# EAGLE schematic HFT-Core-Module_1V0 (EAGLE 7.7.0), part 1 of 2

## Sheet 1 of 24: MCU
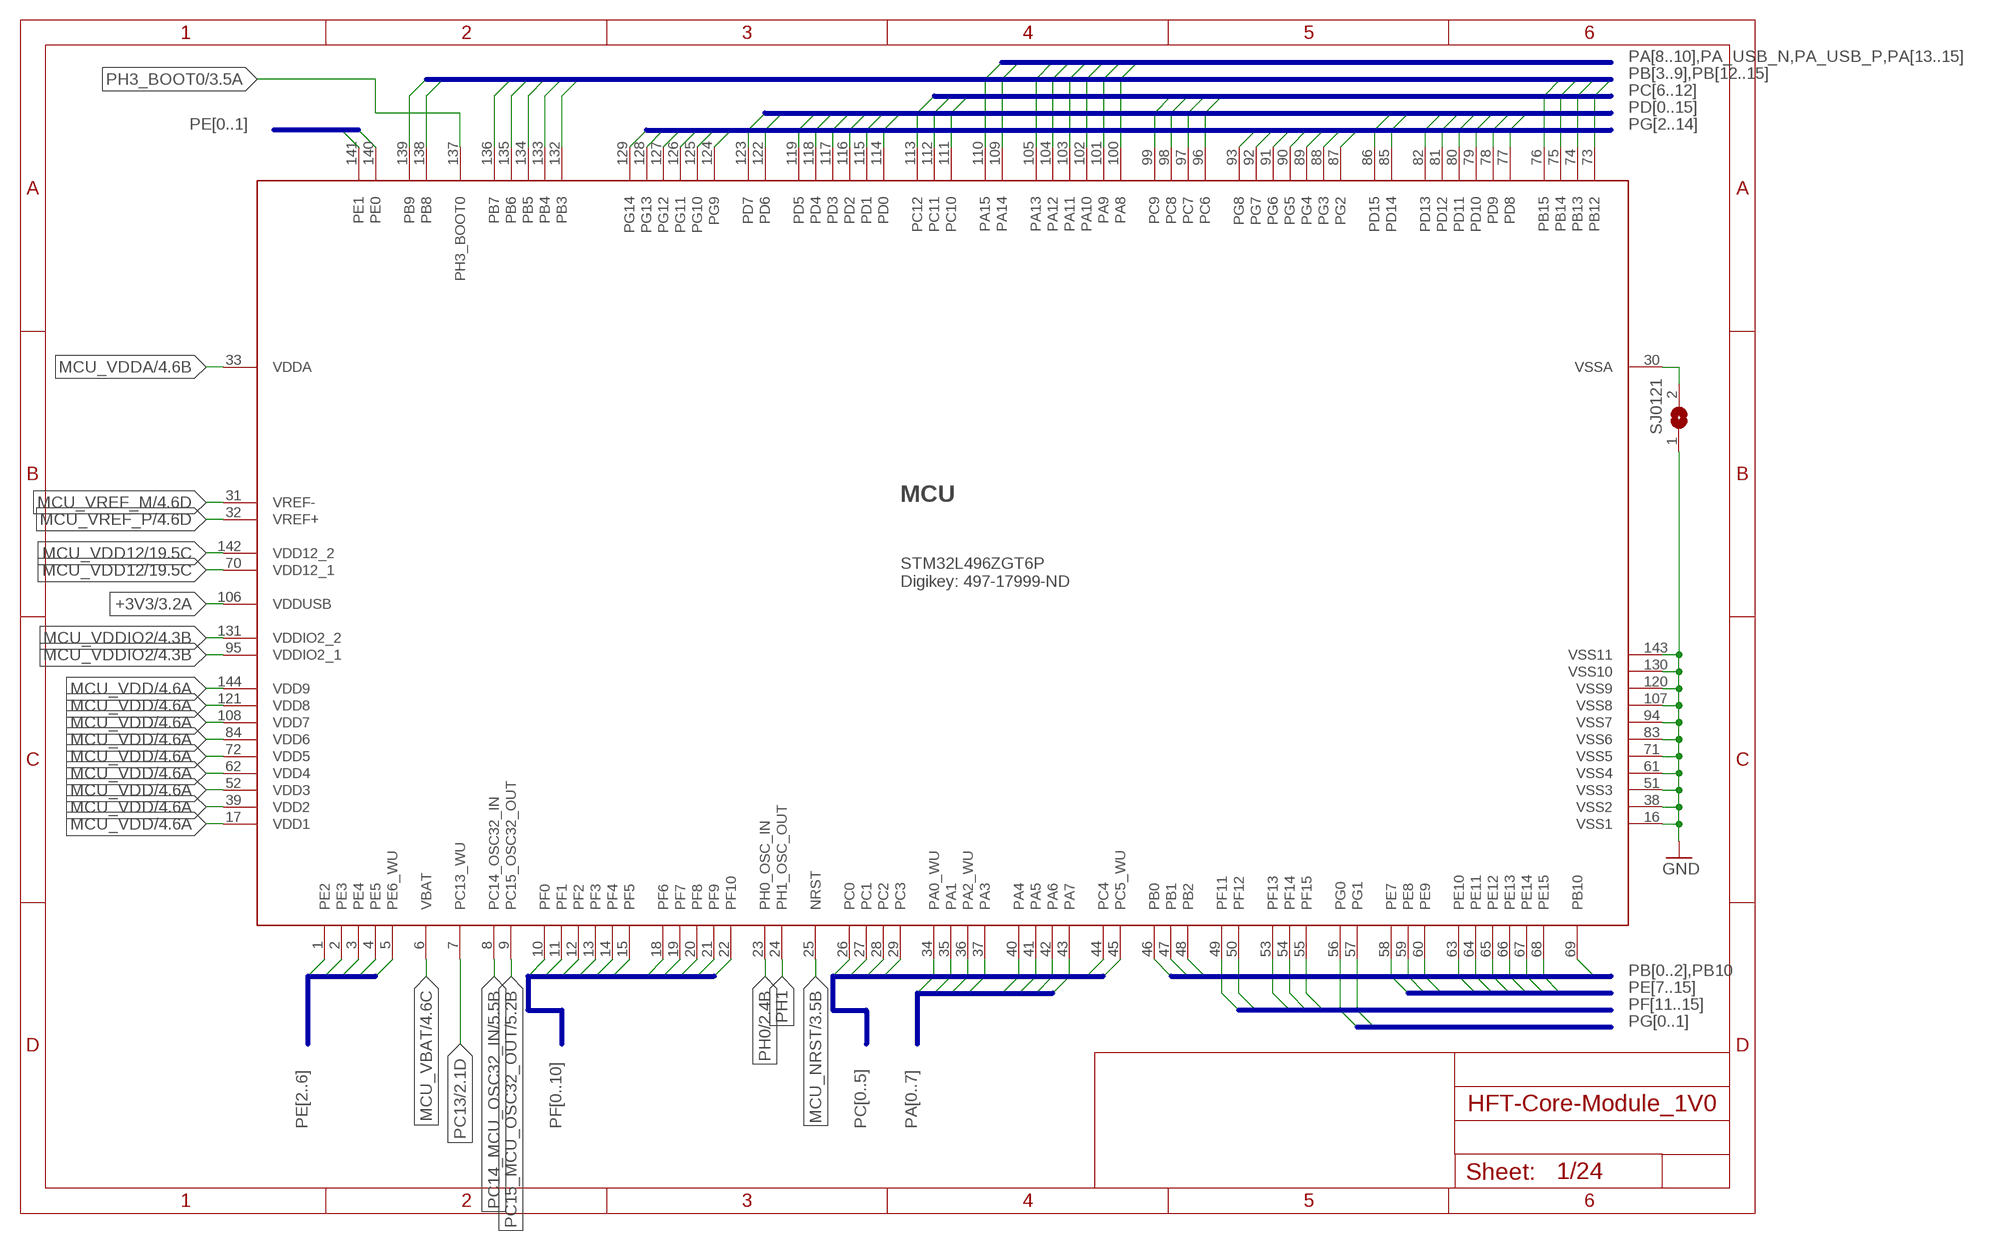
[diagram p0: schematic, sheet 1]

### Parts
SJ0121  SJ  [SJ]
U0111  STM32L4Z_144PIN_SMPS  [LQFP144]

### Nets
+3V3: U0111.106(VDDUSB) ; also sheet 3,4,6,8,9,10,12,13,16,17,18,19,23
GND: SJ0121.1 U0111.16(VSS1) U0111.38(VSS2) U0111.51(VSS3) U0111.61(VSS4) U0111.71(VSS5) U0111.83(VSS6) U0111.94(VSS7) U0111.107(VSS8) U0111.120(VSS9) U0111.130(VSS10) U0111.143(VSS11) ; also sheet 3,4,5,6,7,8,9,10,11,12,13,14,15,16,17,18,19,20,21,22,23,24
MCU_NRST: U0111.25(NRST) ; also sheet 3
MCU_VBAT: U0111.6(VBAT) ; also sheet 4
MCU_VDD: U0111.17(VDD1) U0111.39(VDD2) U0111.52(VDD3) U0111.62(VDD4) U0111.72(VDD5) U0111.84(VDD6) U0111.108(VDD7) U0111.121(VDD8) U0111.144(VDD9) ; also sheet 4
MCU_VDD12: U0111.70(VDD12_1) U0111.142(VDD12_2) ; also sheet 19
MCU_VDDA: U0111.33(VDDA) ; also sheet 4
MCU_VDDIO2: U0111.95(VDDIO2_1) U0111.131(VDDIO2_2) ; also sheet 4
MCU_VREF_M: U0111.31(VREF-) ; also sheet 4
MCU_VREF_P: U0111.32(VREF+) ; also sheet 4
MCU_VSSA: SJ0121.2 U0111.30(VSSA)
PA0: U0111.34(PA0_WU) ; also sheet 2
PA1: U0111.35(PA1)
PA2: U0111.36(PA2_WU) ; also sheet 2
PA3: U0111.37(PA3) ; also sheet 14
PA4: U0111.40(PA4)
PA5: U0111.41(PA5)
PA6: U0111.42(PA6) ; also sheet 2
PA7: U0111.43(PA7) ; also sheet 2,12
PA8: U0111.100(PA8) ; also sheet 2
PA9: U0111.101(PA9) ; also sheet 20
PA10: U0111.102(PA10) ; also sheet 20
PA13: U0111.105(PA13) ; also sheet 3
PA14: U0111.109(PA14) ; also sheet 3
PA15: U0111.110(PA15)
PA_USB_N: U0111.103(PA11) ; also sheet 20
PA_USB_P: U0111.104(PA12) ; also sheet 20
PB0: U0111.46(PB0) ; also sheet 2,12
PB1: U0111.47(PB1) ; also sheet 2
PB2: U0111.48(PB2)
PB3: U0111.132(PB3) ; also sheet 23
PB4: U0111.133(PB4)
PB5: U0111.134(PB5) ; also sheet 23
PB6: U0111.135(PB6) ; also sheet 23
PB7: U0111.136(PB7) ; also sheet 23
PB8: U0111.138(PB8)
PB9: U0111.139(PB9)
PB10: U0111.69(PB10) ; also sheet 2,12
PB12: U0111.73(PB12) ; also sheet 2,12
PB13: U0111.74(PB13) ; also sheet 23
PB14: U0111.75(PB14) ; also sheet 2,12
PB15: U0111.76(PB15)
PC0: U0111.26(PC0) ; also sheet 2
PC1: U0111.27(PC1) ; also sheet 2
PC2: U0111.28(PC2) ; also sheet 2
PC3: U0111.29(PC3) ; also sheet 2
PC4: U0111.44(PC4) ; also sheet 2
PC5: U0111.45(PC5_WU) ; also sheet 2
PC6: U0111.96(PC6) ; also sheet 2,12
PC7: U0111.97(PC7)
PC8: U0111.98(PC8) ; also sheet 2,11
PC9: U0111.99(PC9) ; also sheet 2
PC10: U0111.111(PC10) ; also sheet 2
PC11: U0111.112(PC11) ; also sheet 2,8,10,11
PC12: U0111.113(PC12) ; also sheet 2
PC13: U0111.7(PC13_WU) ; also sheet 2
PC14_MCU_OSC32_IN: U0111.8(PC14_OSC32_IN) ; also sheet 5
PC15_MCU_OSC32_OUT: U0111.9(PC15_OSC32_OUT) ; also sheet 5
PD0: U0111.114(PD0) ; also sheet 2,11
PD1: U0111.115(PD1) ; also sheet 2,11
PD2: U0111.116(PD2) ; also sheet 2,11
PD3: U0111.117(PD3) ; also sheet 2
PD4: U0111.118(PD4) ; also sheet 2
PD5: U0111.119(PD5) ; also sheet 2
PD6: U0111.122(PD6) ; also sheet 2
PD7: U0111.123(PD7) ; also sheet 2,7
PD8: U0111.77(PD8) ; also sheet 8
PD9: U0111.78(PD9) ; also sheet 23
PD10: U0111.79(PD10) ; also sheet 23
PD11: U0111.80(PD11) ; also sheet 23
PD12: U0111.81(PD12) ; also sheet 23
PD13: U0111.82(PD13) ; also sheet 2
PD14: U0111.85(PD14) ; also sheet 23
PD15: U0111.86(PD15) ; also sheet 23
PE0: U0111.140(PE0) ; also sheet 23
PE1: U0111.141(PE1)
PE2: U0111.1(PE2) ; also sheet 23
PE3: U0111.2(PE3) ; also sheet 2
PE4: U0111.3(PE4) ; also sheet 23
PE5: U0111.4(PE5) ; also sheet 23
PE6: U0111.5(PE6_WU)
PE7: U0111.58(PE7) ; also sheet 2,10
PE8: U0111.59(PE8) ; also sheet 2
PE9: U0111.60(PE9) ; also sheet 2
PE10: U0111.63(PE10) ; also sheet 2
PE11: U0111.64(PE11) ; also sheet 2
PE12: U0111.65(PE12) ; also sheet 2
PE13: U0111.66(PE13) ; also sheet 2
PE14: U0111.67(PE14) ; also sheet 2
PE15: U0111.68(PE15) ; also sheet 2
PF0: U0111.10(PF0) ; also sheet 2
PF1: U0111.11(PF1) ; also sheet 2
PF2: U0111.12(PF2) ; also sheet 23
PF3: U0111.13(PF3) ; also sheet 2,6
PF4: U0111.14(PF4)
PF5: U0111.15(PF5)
PF6: U0111.18(PF6) ; also sheet 23
PF7: U0111.19(PF7) ; also sheet 23
PF8: U0111.20(PF8) ; also sheet 23
PF9: U0111.21(PF9) ; also sheet 14
PF10: U0111.22(PF10) ; also sheet 23
PF11: U0111.49(PF11)
PF12: U0111.50(PF12) ; also sheet 2
PF13: U0111.53(PF13) ; also sheet 13
PF14: U0111.54(PF14) ; also sheet 2
PF15: U0111.55(PF15)
PG0: U0111.56(PG0) ; also sheet 2
PG1: U0111.57(PG1) ; also sheet 2,10
PG2: U0111.87(PG2) ; also sheet 8
PG3: U0111.88(PG3) ; also sheet 8
PG4: U0111.89(PG4) ; also sheet 23
PG5: U0111.90(PG5)
PG6: U0111.91(PG6)
PG7: U0111.92(PG7) ; also sheet 2
PG8: U0111.93(PG8) ; also sheet 2
PG9: U0111.124(PG9) ; also sheet 2
PG10: U0111.125(PG10) ; also sheet 2
PG11: U0111.126(PG11) ; also sheet 2
PG12: U0111.127(PG12) ; also sheet 2
PG13: U0111.128(PG13) ; also sheet 2
PG14: U0111.129(PG14) ; also sheet 2
PH0: U0111.23(PH0_OSC_IN) ; also sheet 2,7
PH1: U0111.24(PH1_OSC_OUT)
PH3_BOOT0: U0111.137(PH3_BOOT0) ; also sheet 3

### Buses
PF[0..10]
PE[2..6]
PC[0..5]
PA[0..7]
PB[0..2],PB10
PE[7..15]
PF[11..15]
PG[0..1]
PB[3..9],PB[12..15]
PA[8..10],PA_USB_N,PA_USB_P,PA[13..15]
PC[6..12]
PD[0..15]
PE[0..1]
PG[2..14]

### Notes on the sheet
- MCU
- STM32L496ZGT6P
  Digikey: 497-17999-ND

## Sheet 2 of 24: MCU Switchboard
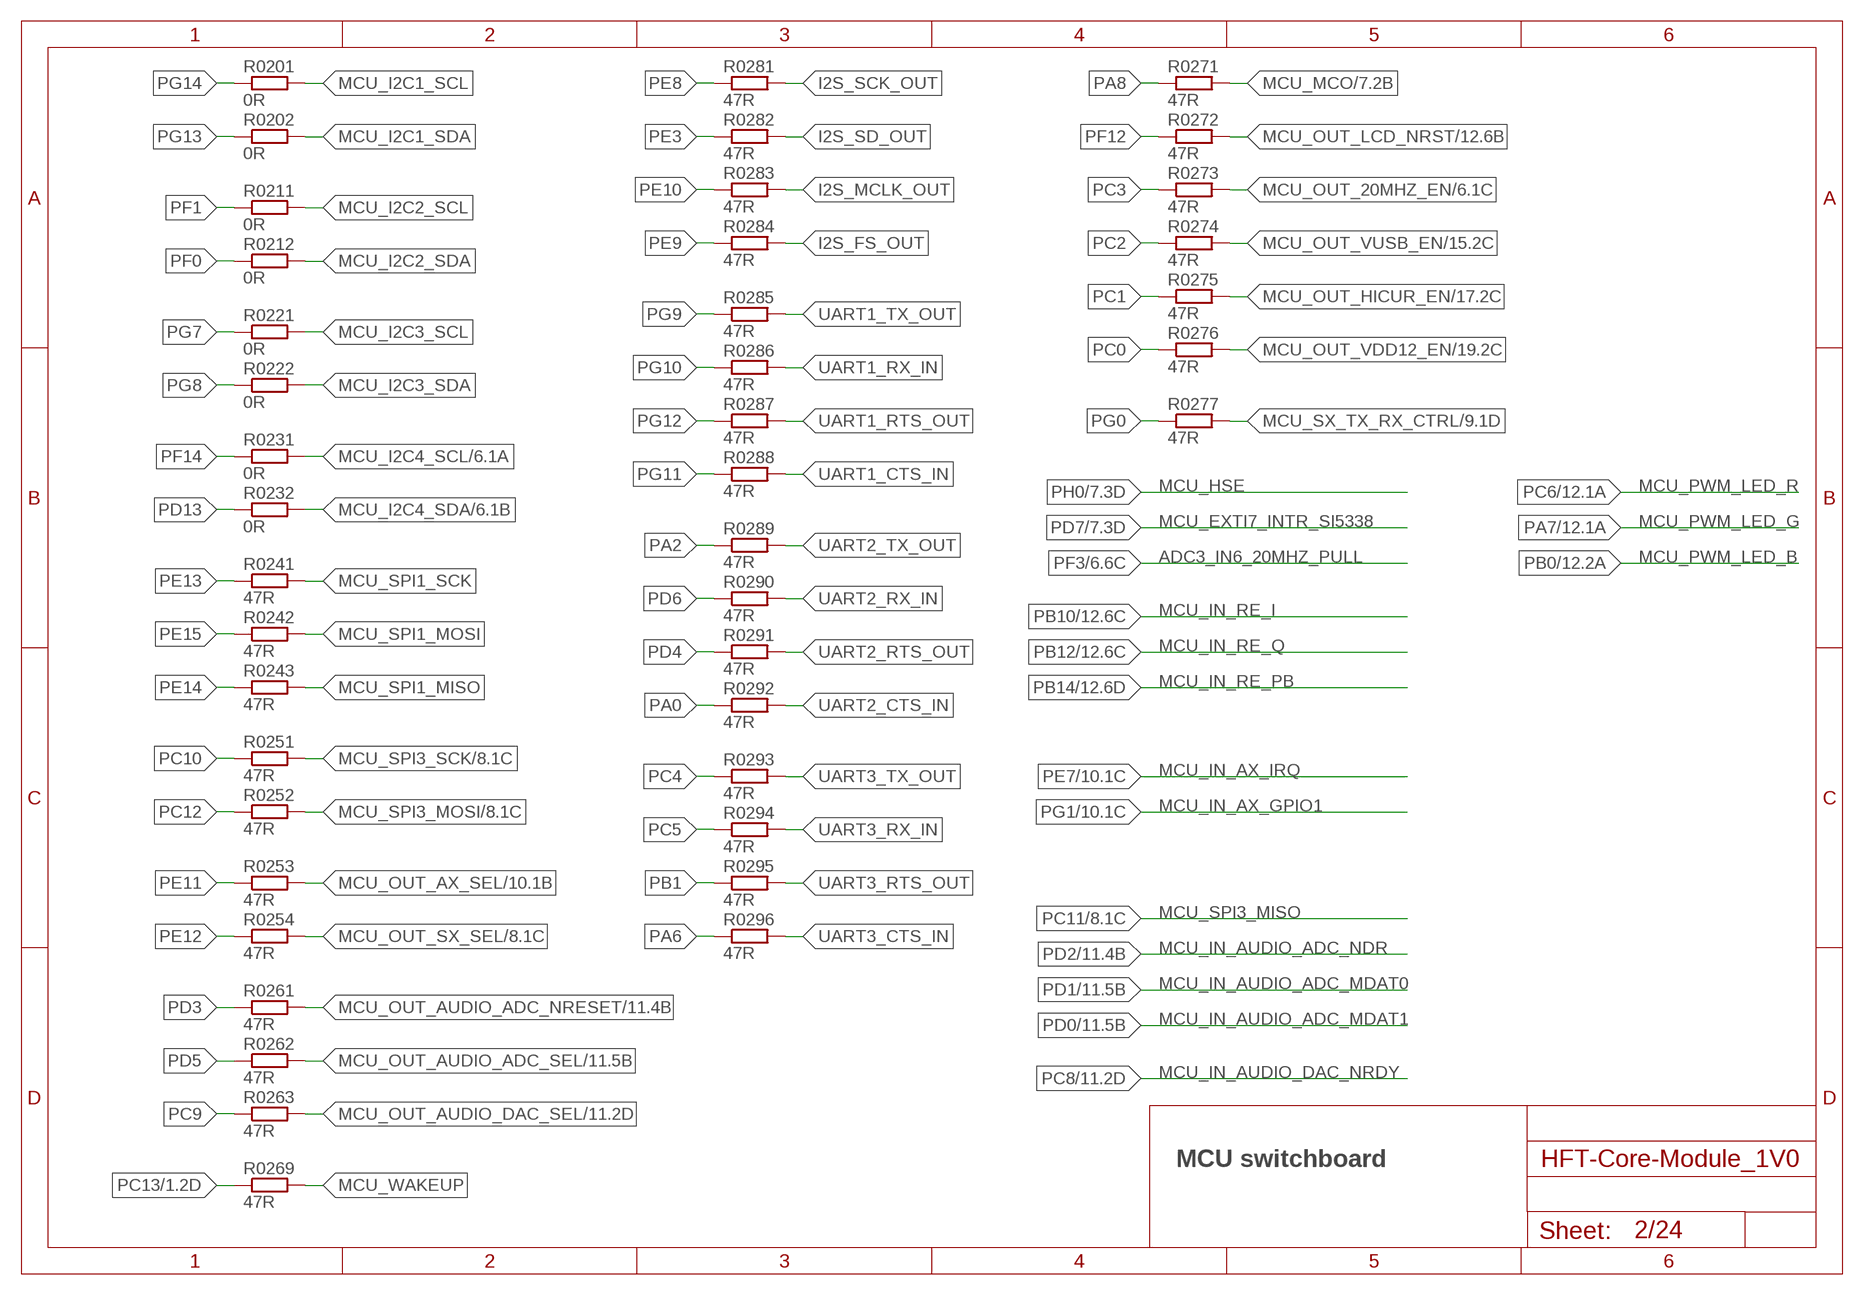
[diagram p1: schematic, sheet 2]

### Parts
R0201  0R  R-EU_R0603  [R0603]
R0202  0R  R-EU_R0603  [R0603]
R0211  0R  R-EU_R0603  [R0603]
R0212  0R  R-EU_R0603  [R0603]
R0221  0R  R-EU_R0603  [R0603]
R0222  0R  R-EU_R0603  [R0603]
R0231  0R  R-EU_R0603  [R0603]
R0232  0R  R-EU_R0603  [R0603]
R0241  47R  R-EU_R0603  [R0603]
R0242  47R  R-EU_R0603  [R0603]
R0243  47R  R-EU_R0603  [R0603]
R0251  47R  R-EU_R0603  [R0603]
R0252  47R  R-EU_R0603  [R0603]
R0253  47R  R-EU_R0603  [R0603]
R0254  47R  R-EU_R0603  [R0603]
R0261  47R  R-EU_R0603  [R0603]
R0262  47R  R-EU_R0603  [R0603]
R0263  47R  R-EU_R0603  [R0603]
R0269  47R  R-EU_R0603  [R0603]
R0271  47R  R-EU_R0603  [R0603]
R0272  47R  R-EU_R0603  [R0603]
R0273  47R  R-EU_R0603  [R0603]
R0274  47R  R-EU_R0603  [R0603]
R0275  47R  R-EU_R0603  [R0603]
R0276  47R  R-EU_R0603  [R0603]
R0277  47R  R-EU_R0603  [R0603]
R0281  47R  R-EU_R0603  [R0603]
R0282  47R  R-EU_R0603  [R0603]
R0283  47R  R-EU_R0603  [R0603]
R0284  47R  R-EU_R0603  [R0603]
R0285  47R  R-EU_R0603  [R0603]
R0286  47R  R-EU_R0603  [R0603]
R0287  47R  R-EU_R0603  [R0603]
R0288  47R  R-EU_R0603  [R0603]
R0289  47R  R-EU_R0603  [R0603]
R0290  47R  R-EU_R0603  [R0603]
R0291  47R  R-EU_R0603  [R0603]
R0292  47R  R-EU_R0603  [R0603]
R0293  47R  R-EU_R0603  [R0603]
R0294  47R  R-EU_R0603  [R0603]
R0295  47R  R-EU_R0603  [R0603]
R0296  47R  R-EU_R0603  [R0603]

### Nets
I2S_FS_OUT: R0284.2 ; also sheet 23
I2S_MCLK_OUT: R0283.2 ; also sheet 23
I2S_SCK_OUT: R0281.2 ; also sheet 23
I2S_SD_OUT: R0282.2 ; also sheet 23
MCU_I2C1_SCL: R0201.2 ; also sheet 23
MCU_I2C1_SDA: R0202.2 ; also sheet 23
MCU_I2C2_SCL: R0211.2 ; also sheet 23
MCU_I2C2_SDA: R0212.2 ; also sheet 23
MCU_I2C3_SCL: R0221.2 ; also sheet 23
MCU_I2C3_SDA: R0222.2 ; also sheet 23
MCU_I2C4_SCL: R0231.2 ; also sheet 6,7,12,13
MCU_I2C4_SDA: R0232.2 ; also sheet 6,7,12,13
MCU_MCO: R0271.2 ; also sheet 7
MCU_OUT_20MHZ_EN: R0273.2 ; also sheet 6,18
MCU_OUT_AUDIO_ADC_NRESET: R0261.2 ; also sheet 11
MCU_OUT_AUDIO_ADC_SEL: R0262.2 ; also sheet 11
MCU_OUT_AUDIO_DAC_SEL: R0263.2 ; also sheet 11
MCU_OUT_AX_SEL: R0253.2 ; also sheet 10
MCU_OUT_HICUR_EN: R0275.2 ; also sheet 17
MCU_OUT_LCD_NRST: R0272.2 ; also sheet 12
MCU_OUT_SX_SEL: R0254.2 ; also sheet 8
MCU_OUT_VDD12_EN: R0276.2 ; also sheet 19
MCU_OUT_VUSB_EN: R0274.2 ; also sheet 15
MCU_SPI1_MISO: R0243.2 ; also sheet 23
MCU_SPI1_MOSI: R0242.2 ; also sheet 23
MCU_SPI1_SCK: R0241.2 ; also sheet 23
MCU_SPI3_MOSI: R0252.2 ; also sheet 8,10,11
MCU_SPI3_SCK: R0251.2 ; also sheet 8,10,11
MCU_SX_TX_RX_CTRL: R0277.2 ; also sheet 9
MCU_WAKEUP: R0269.2 ; also sheet 23
PA0: R0292.1 ; also sheet 1
PA2: R0289.1 ; also sheet 1
PA6: R0296.1 ; also sheet 1
PA8: R0271.1 ; also sheet 1
PB1: R0295.1 ; also sheet 1
PC0: R0276.1 ; also sheet 1
PC1: R0275.1 ; also sheet 1
PC2: R0274.1 ; also sheet 1
PC3: R0273.1 ; also sheet 1
PC4: R0293.1 ; also sheet 1
PC5: R0294.1 ; also sheet 1
PC9: R0263.1 ; also sheet 1
PC10: R0251.1 ; also sheet 1
PC12: R0252.1 ; also sheet 1
PC13: R0269.1 ; also sheet 1
PD3: R0261.1 ; also sheet 1
PD4: R0291.1 ; also sheet 1
PD5: R0262.1 ; also sheet 1
PD6: R0290.1 ; also sheet 1
PD13: R0232.1 ; also sheet 1
PE3: R0282.1 ; also sheet 1
PE8: R0281.1 ; also sheet 1
PE9: R0284.1 ; also sheet 1
PE10: R0283.1 ; also sheet 1
PE11: R0253.1 ; also sheet 1
PE12: R0254.1 ; also sheet 1
PE13: R0241.1 ; also sheet 1
PE14: R0243.1 ; also sheet 1
PE15: R0242.1 ; also sheet 1
PF0: R0212.1 ; also sheet 1
PF1: R0211.1 ; also sheet 1
PF12: R0272.1 ; also sheet 1
PF14: R0231.1 ; also sheet 1
PG0: R0277.1 ; also sheet 1
PG7: R0221.1 ; also sheet 1
PG8: R0222.1 ; also sheet 1
PG9: R0285.1 ; also sheet 1
PG10: R0286.1 ; also sheet 1
PG11: R0288.1 ; also sheet 1
PG12: R0287.1 ; also sheet 1
PG13: R0202.1 ; also sheet 1
PG14: R0201.1 ; also sheet 1
UART1_CTS_IN: R0288.2 ; also sheet 23
UART1_RTS_OUT: R0287.2 ; also sheet 23
UART1_RX_IN: R0286.2 ; also sheet 23
UART1_TX_OUT: R0285.2 ; also sheet 23
UART2_CTS_IN: R0292.2 ; also sheet 23
UART2_RTS_OUT: R0291.2 ; also sheet 23
UART2_RX_IN: R0290.2 ; also sheet 23
UART2_TX_OUT: R0289.2 ; also sheet 23
UART3_CTS_IN: R0296.2 ; also sheet 23
UART3_RTS_OUT: R0295.2 ; also sheet 23
UART3_RX_IN: R0294.2 ; also sheet 23
UART3_TX_OUT: R0293.2 ; also sheet 23

### Notes on the sheet
- MCU_HSE | MCU_PWM_LED_R
- MCU_EXTI7_INTR_SI5338 | MCU_PWM_LED_G
- ADC3_IN6_20MHZ_PULL | MCU_PWM_LED_B
- MCU_IN_RE_I
- MCU_IN_RE_Q
- MCU_IN_RE_PB
- MCU_IN_AX_IRQ
- MCU_IN_AX_GPIO1
- MCU_SPI3_MISO
- MCU_IN_AUDIO_ADC_NDR
- MCU_IN_AUDIO_ADC_MDAT0
- MCU_IN_AUDIO_ADC_MDAT1
- MCU_IN_AUDIO_DAC_NRDY
- MCU switchboard

## Sheet 3 of 24: MCU Debug
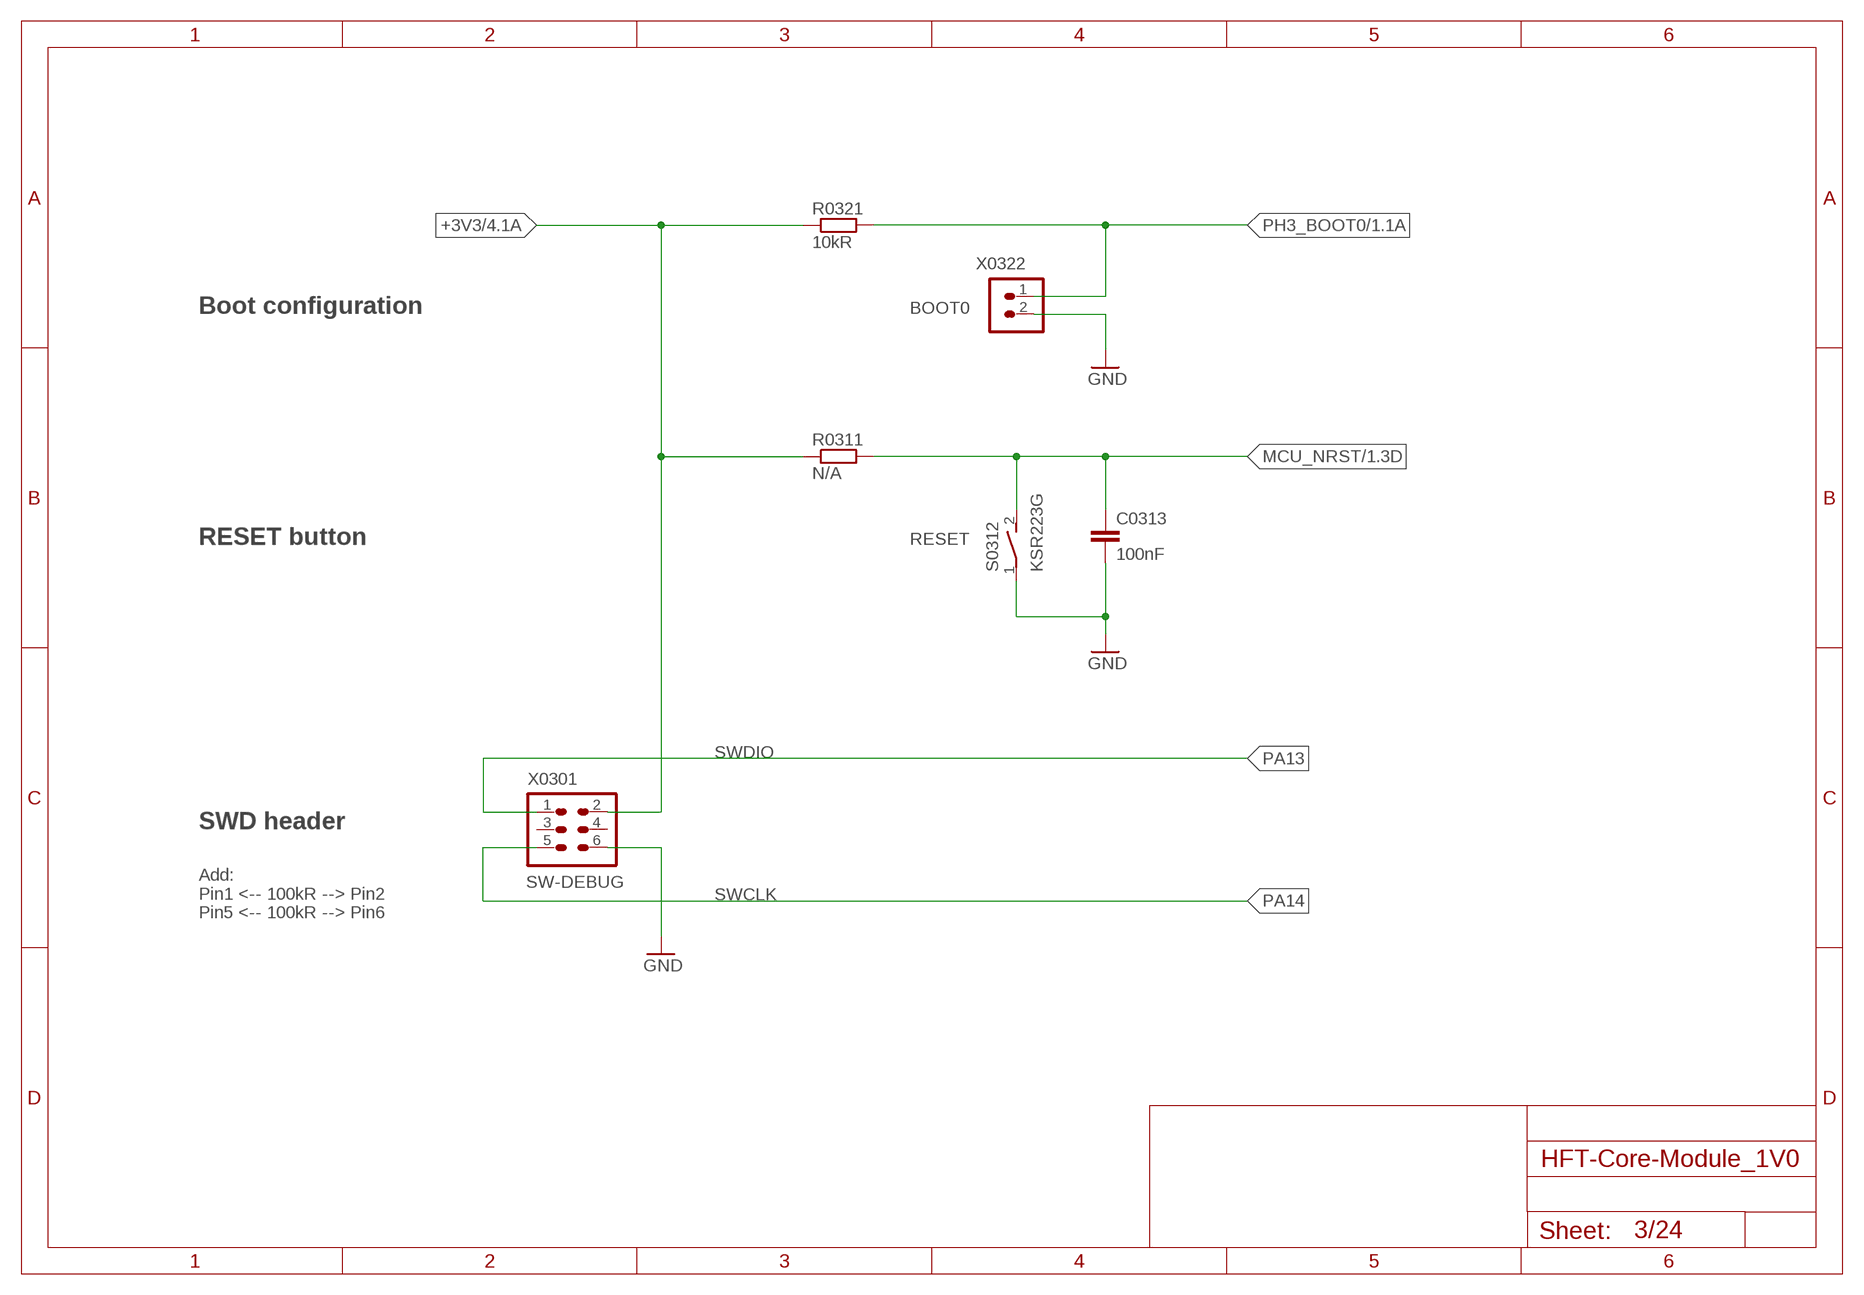
[diagram p2: schematic, sheet 3]

### Parts
C0313  100nF  C-EUC0603  [C0603]
R0311  N/A  R-EU_R0603  [R0603]
R0321  10kR  R-EU_R0603  [R0603]
S0312  KSR223G  KSR223G_SMD_1POL  [KSR223G_SMD_1POL]
X0301  HEADER-2X3  [2X03]
X0322  HEADER-1X2  [1X02]

### Nets
+3V3: R0311.1 R0321.1 X0301.2 ; also sheet 1,4,6,8,9,10,12,13,16,17,18,19,23
GND: C0313.2 S0312.1(P) X0301.6 X0322.2 ; also sheet 1,4,5,6,7,8,9,10,11,12,13,14,15,16,17,18,19,20,21,22,23,24
MCU_NRST: C0313.1 R0311.2 S0312.2(S) ; also sheet 1
PA13: X0301.1 ; also sheet 1
PA14: X0301.5 ; also sheet 1
PH3_BOOT0: R0321.2 X0322.1 ; also sheet 1
Unconnected: X0301.3 X0301.4

### Notes on the sheet
- Boot configuration | BOOT0
- RESET button | RESET
- SWDIO
- SWD header
- SW-DEBUG
- SWCLK
- Add:
  Pin1 <-- 100kR --> Pin2
  Pin5 <-- 100kR --> Pin6

## Sheet 4 of 24: MCU Power
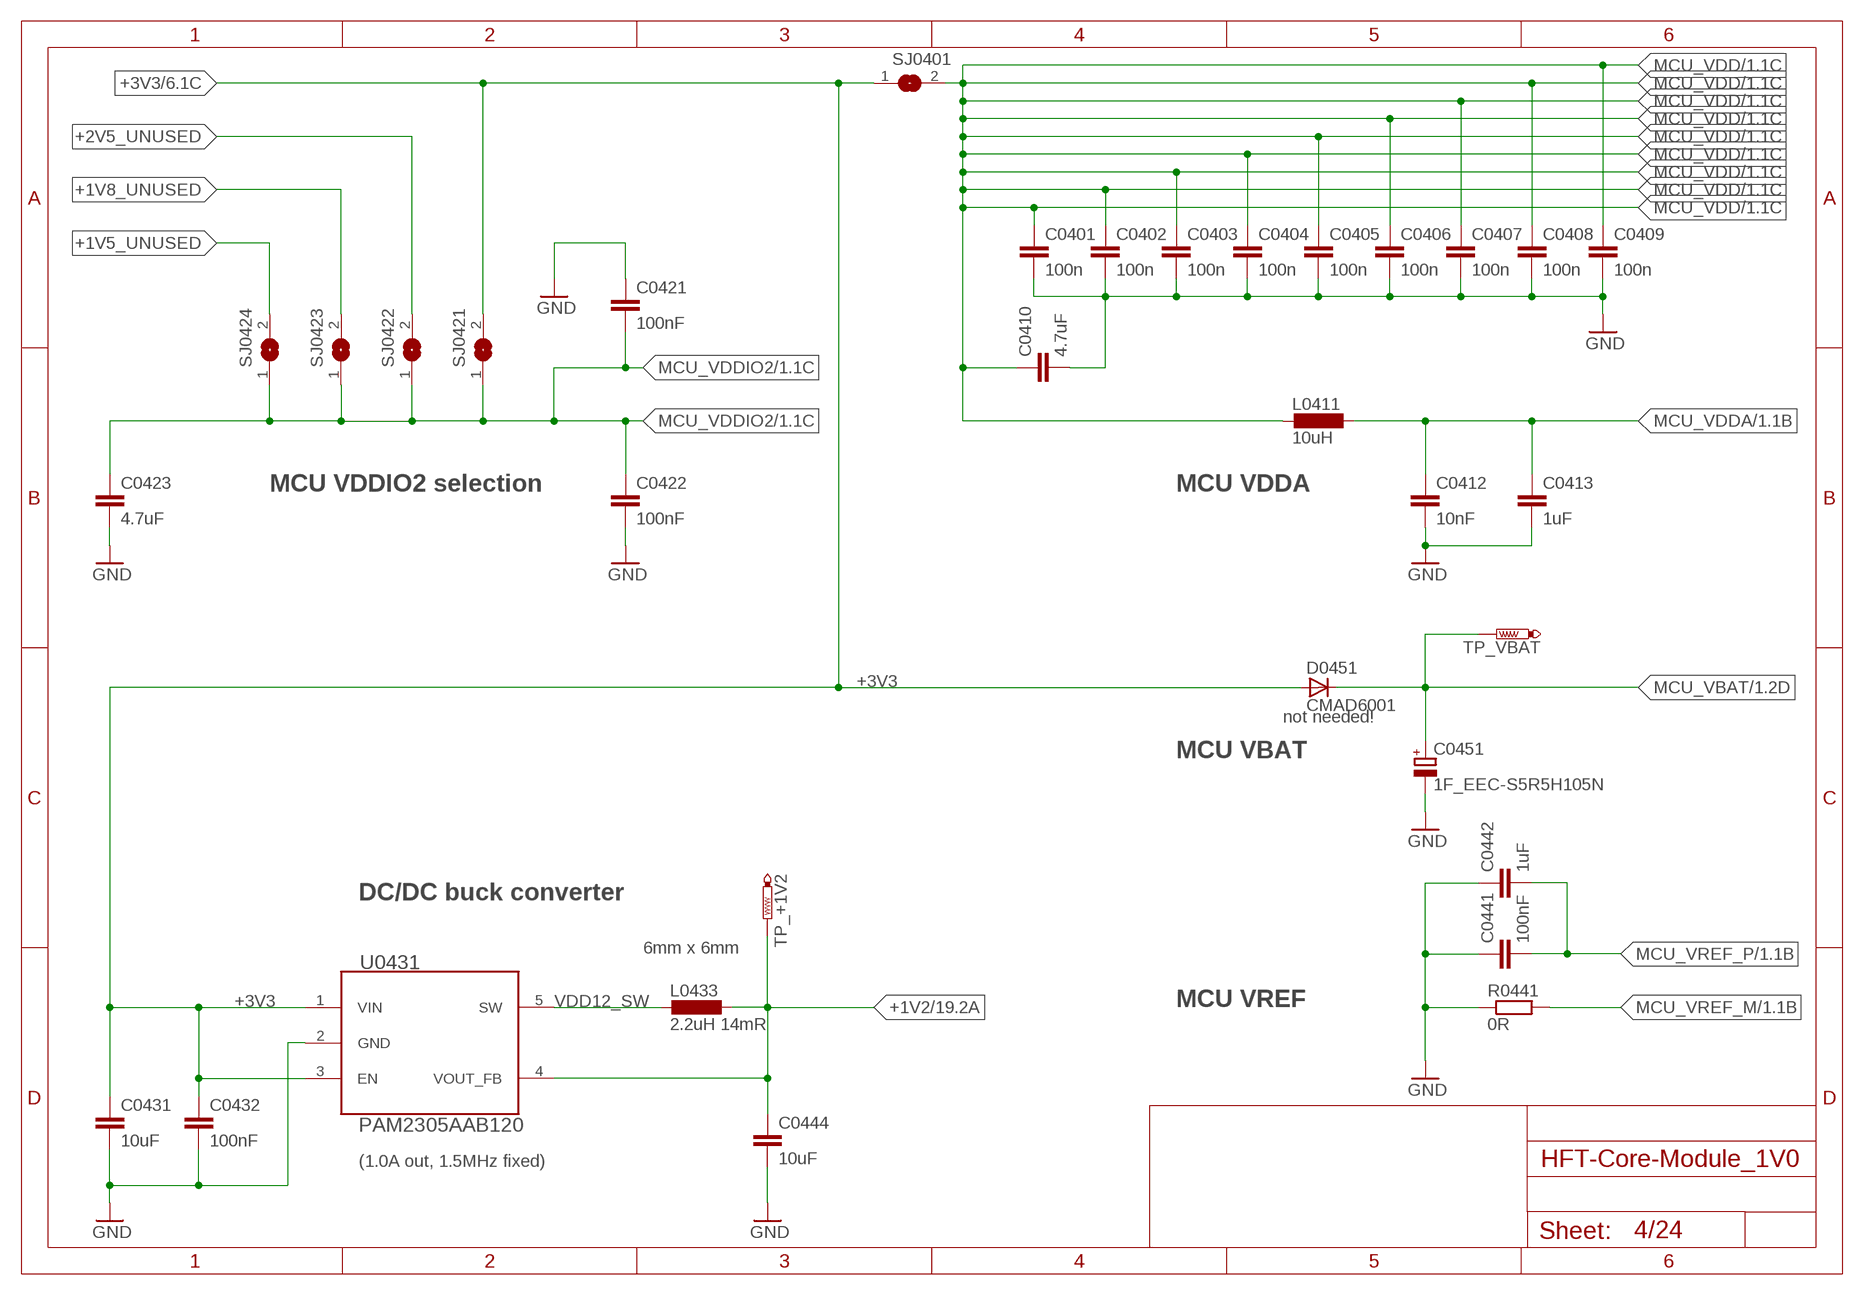
[diagram p3: schematic, sheet 4]

### Parts
C0401  100n  C-EUC0603  [C0603]
C0402  100n  C-EUC0603  [C0603]
C0403  100n  C-EUC0603  [C0603]
C0404  100n  C-EUC0603  [C0603]
C0405  100n  C-EUC0603  [C0603]
C0406  100n  C-EUC0603  [C0603]
C0407  100n  C-EUC0603  [C0603]
C0408  100n  C-EUC0603  [C0603]
C0409  100n  C-EUC0603  [C0603]
C0410  4.7uF  C-EUC0805  [C0805]
C0412  10nF  C-EUC0603  [C0603]
C0413  1uF  C-EUC0805  [C0805]
C0421  100nF  C-EUC0603  [C0603]
C0422  100nF  C-EUC0603  [C0603]
C0423  4.7uF  C-EUC0805  [C0805]
C0431  10uF  C-EUC0805  [C0805]
C0432  100nF  C-EUC0603  [C0603]
C0441  100nF  C-EUC0603  [C0603]
C0442  1uF  C-EUC0805  [C0805]
C0444  10uF  C-EUC0805  [C0805]
C0451  1F_EEC-S5R5H105N  CPOL-EUW14MM_D8MM_P13MM5  [W14MM_D8MM_P13MM5]
D0451  CMAD6001  D_SOD923  [SOD923]
L0411  10uH  L-EUL2012C  [L2012C]
L0433  2.2uH 14mR  L-EU6.0X6.0MM  [L_6X6MM]
R0441  0R  R-EU_R0603  [R0603]
SJ0401  SJ  [SJ]
SJ0421  SJ  [SJ]
SJ0422  SJ  [SJ]
SJ0423  SJ  [SJ]
SJ0424  SJ  [SJ]
TP_+1V2  PTR1B1,27  [B1,27]
TP_VBAT  PTR1B1,27  [B1,27]
U0431  PAM2305AAB120  PAM2305  [SOT95P280X145-5N]

### Nets
+1V2: C0444.1 L0433.1 TP_+1V2.TP U0431.4(VOUT_FB) ; also sheet 19
+1V5_UNUSED: SJ0424.2
+1V8_UNUSED: SJ0423.2
+2V5_UNUSED: SJ0422.2
+3V3: C0431.1 C0432.1 D0451.A SJ0401.1 SJ0421.2 U0431.1(VIN) U0431.3(EN) ; also sheet 1,3,6,8,9,10,12,13,16,17,18,19,23
GND: C0401.2 C0402.2 C0403.2 C0404.2 C0405.2 C0406.2 C0407.2 C0408.2 C0409.2 C0410.2 C0412.2 C0413.2 C0421.1 C0422.2 C0423.2 C0431.2 C0432.2 C0441.1 C0442.1 C0444.2 C0451.- R0441.1 U0431.2(GND) ; also sheet 1,3,5,6,7,8,9,10,11,12,13,14,15,16,17,18,19,20,21,22,23,24
MCU_VBAT: C0451.+ D0451.C TP_VBAT.TP ; also sheet 1
MCU_VDD: C0401.1 C0402.1 C0403.1 C0404.1 C0405.1 C0406.1 C0407.1 C0408.1 C0409.1 C0410.1 L0411.2 SJ0401.2 ; also sheet 1
MCU_VDDA: C0412.1 C0413.1 L0411.1 ; also sheet 1
MCU_VDDIO2: C0421.2 C0422.1 C0423.1 SJ0421.1 SJ0422.1 SJ0423.1 SJ0424.1 ; also sheet 1
MCU_VREF_M: R0441.2 ; also sheet 1
MCU_VREF_P: C0441.2 C0442.2 ; also sheet 1
VDD12_SW: L0433.2 U0431.5(SW)

### Notes on the sheet
- MCU VDDIO2 selection | MCU VDDA
- not needed!
- MCU VBAT
- DC/DC buck converter
- 6mm x 6mm
- MCU VREF
- (1.0A out, 1.5MHz fixed)

## Sheet 5 of 24: 32.768 kHz
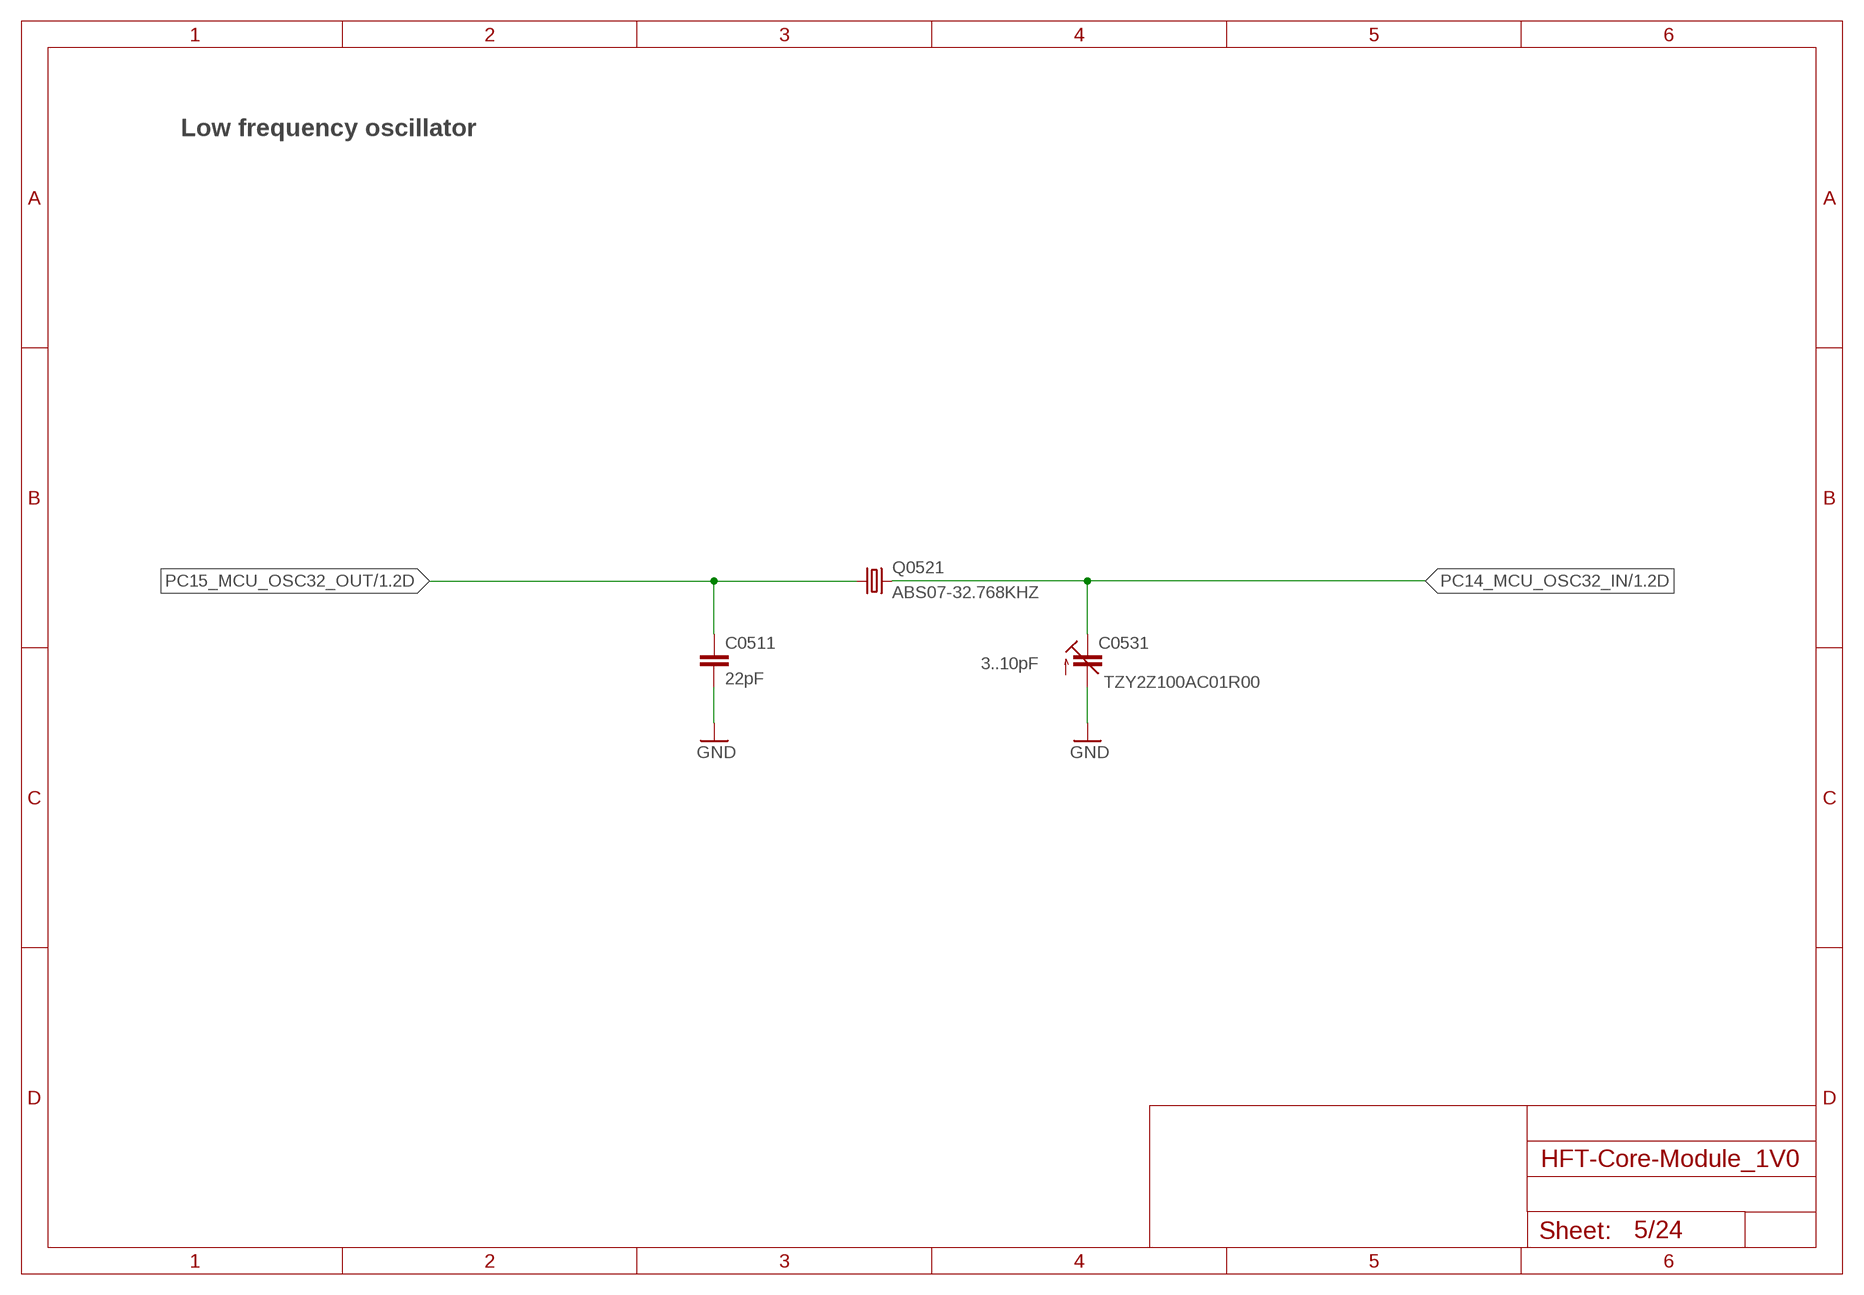
[diagram p4: schematic, sheet 5]

### Parts
C0511  22pF  C-EUC0603  [C0603]
C0531  TZY2Z100AC01R00  C-TRIMM3MM2_2MM5  [3MM2_X_2MM5]
Q0521  ABS07-32.768KHZ  [ABS07]

### Nets
GND: C0511.2 C0531.+(A) ; also sheet 1,3,4,6,7,8,9,10,11,12,13,14,15,16,17,18,19,20,21,22,23,24
PC14_MCU_OSC32_IN: C0531.-(E) Q0521.2 ; also sheet 1
PC15_MCU_OSC32_OUT: C0511.1 Q0521.1 ; also sheet 1

### Notes on the sheet
- Low frequency oscillator
- 3..10pF

## Sheet 6 of 24: 20 MHz TCXO
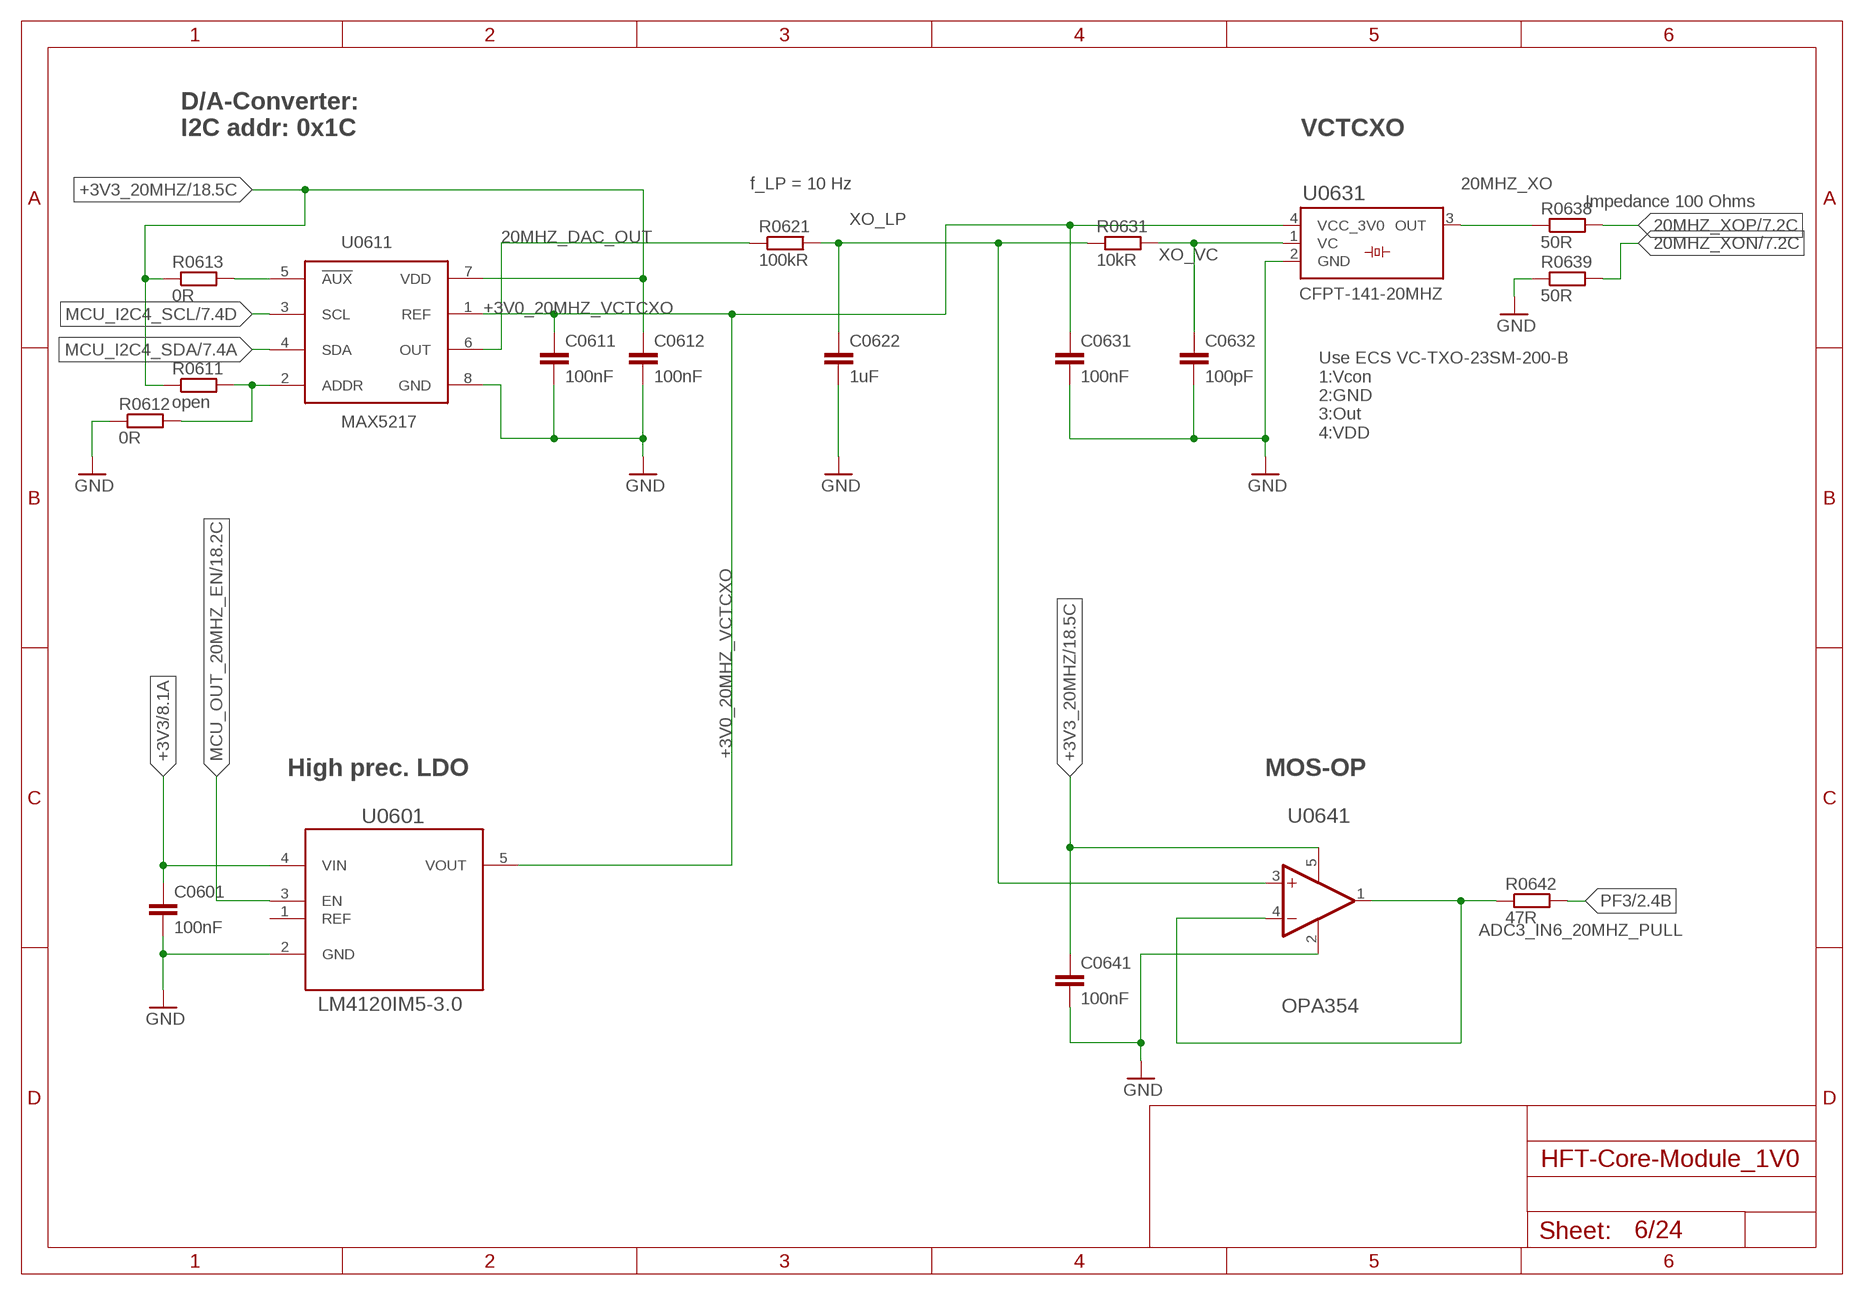
[diagram p5: schematic, sheet 6]

### Parts
C0601  100nF  C-EUC0603  [C0603]
C0611  100nF  C-EUC0603  [C0603]
C0612  100nF  C-EUC0603  [C0603]
C0622  1uF  C-EUC0805  [C0805]
C0631  100nF  C-EUC0603  [C0603]
C0632  100pF  C-EUC0603  [C0603]
C0641  100nF  C-EUC0603  [C0603]
R0611  open  R-EU_R0603  [R0603]
R0612  0R  R-EU_R0603  [R0603]
R0613  0R  R-EU_R0603  [R0603]
R0621  100kR  R-EU_R0603  [R0603]
R0631  10kR  R-EU_R0603  [R0603]
R0638  50R  R-EU_R0603  [R0603]
R0639  50R  R-EU_R0603  [R0603]
R0642  47R  R-EU_R0603  [R0603]
U0601  LM4120IM5-3.0  [SOT95P285X120-5N]
U0611  MAX5217  [µMAX8]
U0631  CFPT-141-20MHZ  [CFPT-141]
U0641  OPA354  [SOT-23-5]

### Nets
20MHZ_DAC_OUT: R0621.1 U0611.6(OUT)
20MHZ_XO: R0638.1 U0631.3(OUT)
20MHZ_XON: R0639.2 ; also sheet 7
20MHZ_XOP: R0638.2 ; also sheet 7
+3V0_20MHZ_VCTCXO: C0611.1 C0631.1 U0601.5(VOUT) U0611.1(REF) U0631.4(VCC_3V0)
+3V3: C0601.1 U0601.4(VIN) ; also sheet 1,3,4,8,9,10,12,13,16,17,18,19,23
+3V3_20MHZ: C0612.1 C0641.1 R0611.1 R0613.1 U0611.7(VDD) U0641.5(V+) ; also sheet 18
AD_VCTCXO1: R0642.1 U0641.1(OUT) U0641.4(-IN)
GND: C0601.2 C0611.2 C0612.2 C0622.2 C0631.2 C0632.2 C0641.2 R0612.1 R0639.1 U0601.2(GND) U0611.8(GND) U0631.2(GND) U0641.2(V-) ; also sheet 1,3,4,5,7,8,9,10,11,12,13,14,15,16,17,18,19,20,21,22,23,24
MAX5217_!AUX: R0613.2 U0611.5(!AUX)
MAX5217_ADDR: R0611.2 R0612.2 U0611.2(ADDR)
MCU_I2C4_SCL: U0611.3(SCL) ; also sheet 2,7,12,13
MCU_I2C4_SDA: U0611.4(SDA) ; also sheet 2,7,12,13
MCU_OUT_20MHZ_EN: U0601.3(EN) ; also sheet 2,18
PF3: R0642.2 ; also sheet 1,2
XO_LP: C0622.1 R0621.2 R0631.1 U0641.3(+IN)
XO_VC: C0632.1 R0631.2 U0631.1(VC)
Unconnected: U0601.1(REF)

### Notes on the sheet
- D/A-Converter:
  I2C addr: 0x1C
- VCTCXO
- f_LP = 10 Hz
- Impedance 100 Ohms
- Use ECS VC-TXO-23SM-200-B
  1:Vcon
  2:GND
  3:Out
  4:VDD
- High prec. LDO | MOS-OP
- ADC3_IN6_20MHZ_PULL

## Sheet 7 of 24: Clock Si5338
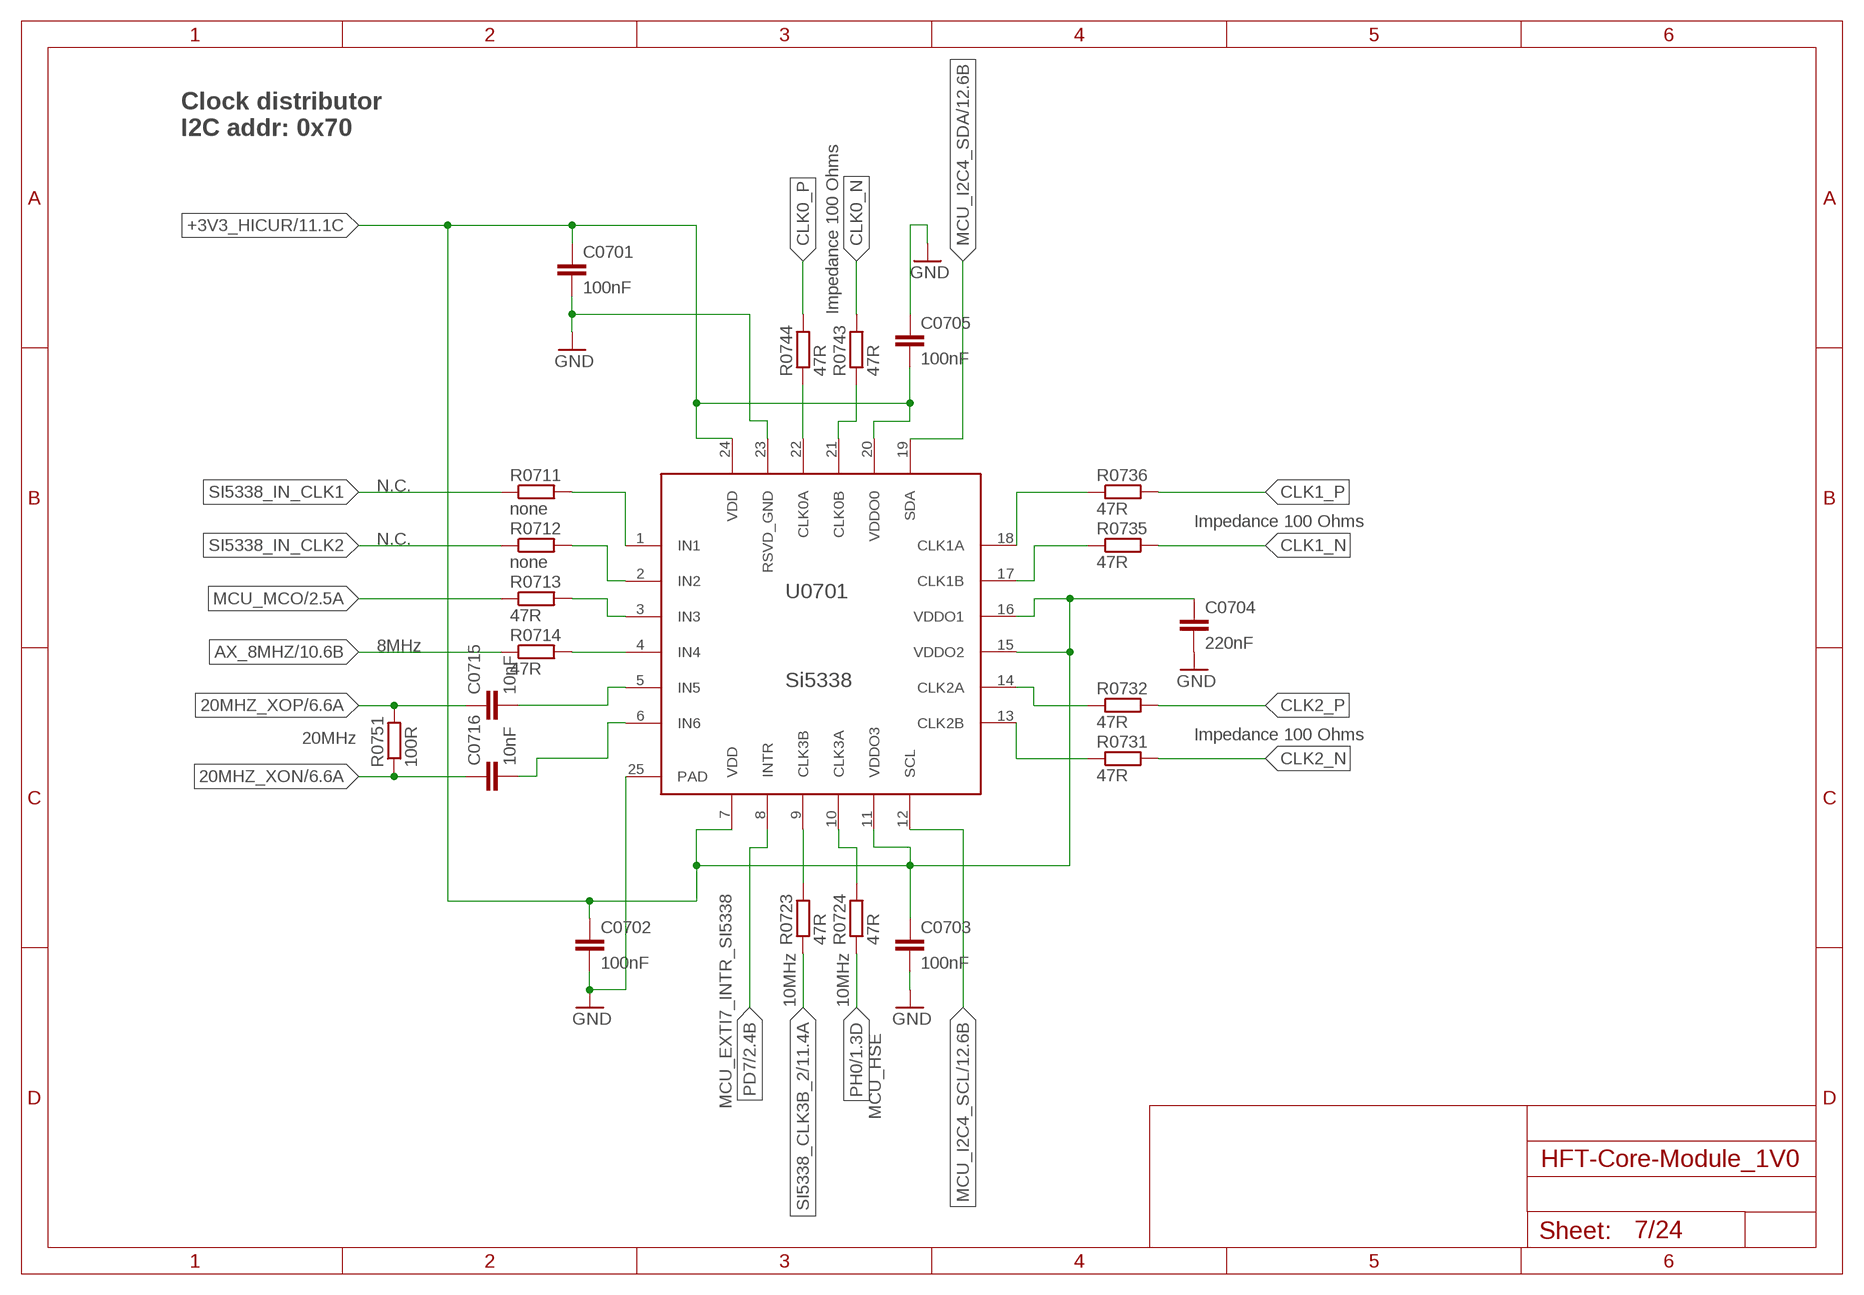
[diagram p6: schematic, sheet 7]

### Parts
C0701  100nF  C-EUC0603  [C0603]
C0702  100nF  C-EUC0603  [C0603]
C0703  100nF  C-EUC0603  [C0603]
C0704  220nF  C-EUC0603  [C0603]
C0705  100nF  C-EUC0603  [C0603]
C0715  10nF  C-EUC0603  [C0603]
C0716  10nF  C-EUC0603  [C0603]
R0711  none  R-EU_R0603  [R0603]
R0712  none  R-EU_R0603  [R0603]
R0713  47R  R-EU_R0603  [R0603]
R0714  47R  R-EU_R0603  [R0603]
R0723  47R  R-EU_R0603  [R0603]
R0724  47R  R-EU_R0603  [R0603]
R0731  47R  R-EU_R0603  [R0603]
R0732  47R  R-EU_R0603  [R0603]
R0735  47R  R-EU_R0603  [R0603]
R0736  47R  R-EU_R0603  [R0603]
R0743  47R  R-EU_R0603  [R0603]
R0744  47R  R-EU_R0603  [R0603]
R0751  100R  R-EU_R0603  [R0603]
U0701  Si5338  SI5338  [QFN24_P0MM5_CTRPAD]

### Nets
20MHZ_XON: C0716.1 R0751.1 ; also sheet 6
20MHZ_XOP: C0715.1 R0751.2 ; also sheet 6
+3V3_HICUR: C0701.1 C0702.1 C0703.1 C0704.1 C0705.2 U0701.7(VDD) U0701.11(VDDO3) U0701.15(VDDO2) U0701.16(VDDO1) U0701.20(VDDO0) U0701.24(VDD) ; also sheet 11,17
AX_8MHZ: R0714.1 ; also sheet 10
CLK0_N: R0743.2 ; also sheet 23
CLK0_P: R0744.2 ; also sheet 23
CLK1_N: R0735.2 ; also sheet 23
CLK1_P: R0736.2 ; also sheet 23
CLK2_N: R0731.2 ; also sheet 23
CLK2_P: R0732.2 ; also sheet 23
GND: C0701.2 C0702.2 C0703.2 C0704.2 C0705.1 U0701.23(RSVD_GND) U0701.25(PAD) ; also sheet 1,3,4,5,6,8,9,10,11,12,13,14,15,16,17,18,19,20,21,22,23,24
MCU_I2C4_SCL: U0701.12(SCL) ; also sheet 2,6,12,13
MCU_I2C4_SDA: U0701.19(SDA) ; also sheet 2,6,12,13
MCU_MCO: R0713.1 ; also sheet 2
PD7: U0701.8(INTR) ; also sheet 1,2
PH0: R0724.1 ; also sheet 1,2
SI5338_CLK0A: R0744.1 U0701.22(CLK0A)
SI5338_CLK0B: R0743.1 U0701.21(CLK0B)
SI5338_CLK1A: R0736.1 U0701.18(CLK1A)
SI5338_CLK1B: R0735.1 U0701.17(CLK1B)
SI5338_CLK2A: R0732.1 U0701.14(CLK2A)
SI5338_CLK2B: R0731.1 U0701.13(CLK2B)
SI5338_CLK3A: R0724.2 U0701.10(CLK3A)
SI5338_CLK3B: R0723.2 U0701.9(CLK3B)
SI5338_CLK3B_2: R0723.1 ; also sheet 11
SI5338_IN1: R0711.2 U0701.1(IN1)
SI5338_IN2: R0712.2 U0701.2(IN2)
SI5338_IN3: R0713.2 U0701.3(IN3)
SI5338_IN4: R0714.2 U0701.4(IN4)
SI5338_IN5: C0715.2 U0701.5(IN5)
SI5338_IN6: C0716.2 U0701.6(IN6)
SI5338_IN_CLK1: R0711.1
SI5338_IN_CLK2: R0712.1

### Notes on the sheet
- Clock distributor
  I2C addr: 0x70
- Impedance 100 Ohms
- N.C.
- Impedance 100 Ohms
- N.C.
- 8MHz
- 20MHz | Impedance 100 Ohms
- 10MHz | 10MHz
- MCU_EXTI7_INTR_SI5338
- MCU_HSE

## Sheet 8 of 24: VHF/UHF SX1276 - ch 1
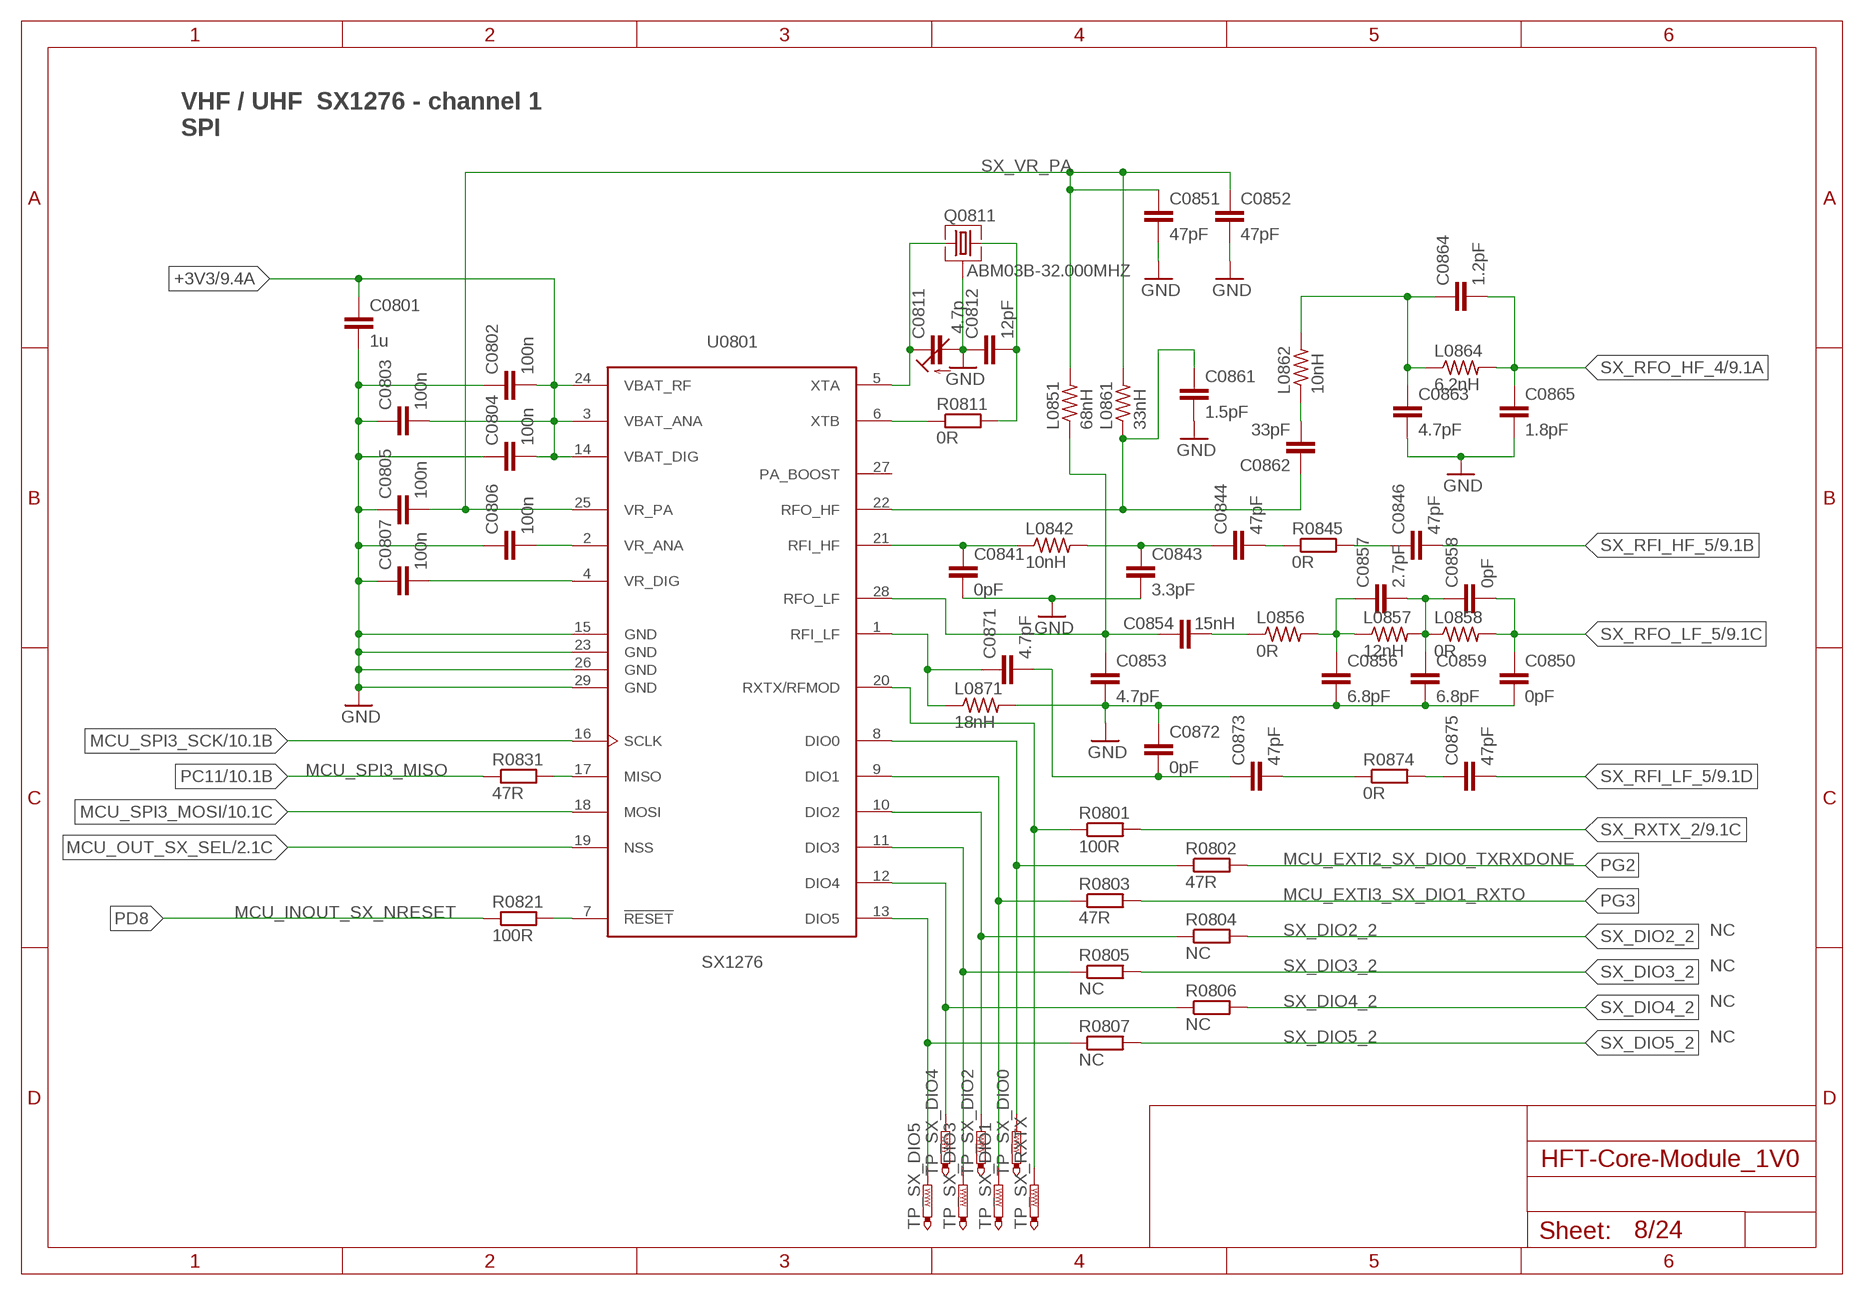
[diagram p7: schematic, sheet 8]

### Parts
C0801  1u  C-EUC0603  [C0603]
C0802  100n  C-EUC0603  [C0603]
C0803  100n  C-EUC0603  [C0603]
C0804  100n  C-EUC0603  [C0603]
C0805  100n  C-EUC0603  [C0603]
C0806  100n  C-EUC0603  [C0603]
C0807  100n  C-EUC0603  [C0603]
C0811  4.7p  C-TRIMM3MM2_2MM5  [3MM2_X_2MM5]
C0812  12pF  C-EUC0603  [C0603]
C0841  0pF  C-EUC0603  [C0603]
C0843  3.3pF  C-EUC0603  [C0603]
C0844  47pF  C-EUC0603  [C0603]
C0846  47pF  C-EUC0603  [C0603]
C0850  0pF  C-EUC0603  [C0603]
C0851  47pF  C-EUC0603  [C0603]
C0852  47pF  C-EUC0603  [C0603]
C0853  4.7pF  C-EUC0603  [C0603]
C0854  15nH  C-EUC0603  [C0603]
C0856  6.8pF  C-EUC0603  [C0603]
C0857  2.7pF  C-EUC0603  [C0603]
C0858  0pF  C-EUC0603  [C0603]
C0859  6.8pF  C-EUC0603  [C0603]
C0861  1.5pF  C-EUC0603  [C0603]
C0862  33pF  C-EUC0603  [C0603]
C0863  4.7pF  C-EUC0603  [C0603]
C0864  1.2pF  C-EUC0603  [C0603]
C0865  1.8pF  C-EUC0603  [C0603]
C0871  4.7pF  C-EUC0603  [C0603]
C0872  0pF  C-EUC0603  [C0603]
C0873  47pF  C-EUC0603  [C0603]
C0875  47pF  C-EUC0603  [C0603]
L0842  10nH  R-US_R0603  [R0603]
L0851  68nH  R-US_R0603  [R0603]
L0856  0R  R-US_R0603  [R0603]
L0857  12nH  R-US_R0603  [R0603]
L0858  0R  R-US_R0603  [R0603]
L0861  33nH  R-US_R0603  [R0603]
L0862  10nH  R-US_R0603  [R0603]
L0864  6.2nH  R-US_R0603  [R0603]
L0871  18nH  R-US_R0603  [R0603]
Q0811  ABM03B-32.000MHZ  [ABM03B]
R0801  100R  R-EU_R0603  [R0603]
R0802  47R  R-EU_R0603  [R0603]
R0803  47R  R-EU_R0603  [R0603]
R0804  NC  R-EU_R0603  [R0603]
R0805  NC  R-EU_R0603  [R0603]
R0806  NC  R-EU_R0603  [R0603]
R0807  NC  R-EU_R0603  [R0603]
R0811  0R  R-EU_R0603  [R0603]
R0821  100R  R-EU_R0603  [R0603]
R0831  47R  R-EU_R0603  [R0603]
R0845  0R  R-EU_R0603  [R0603]
R0874  0R  R-EU_R0603  [R0603]
TP_SX_DIO0  PTR1TP06R  [TP06R]
TP_SX_DIO1  PTR1TP06R  [TP06R]
TP_SX_DIO2  PTR1TP06R  [TP06R]
TP_SX_DIO3  PTR1TP06R  [TP06R]
TP_SX_DIO4  PTR1TP06R  [TP06R]
TP_SX_DIO5  PTR1TP06R  [TP06R]
TP_SX_RXTX  PTR1TP06R  [TP06R]
U0801  SX1276  [QFN28-6X6-0P65-PAD]

### Nets
+3V3: C0801.1 C0802.2 C0803.2 C0804.2 U0801.3(VBAT_ANA) U0801.14(VBAT_DIG) U0801.24(VBAT_RF) ; also sheet 1,3,4,6,9,10,12,13,16,17,18,19,23
GND: C0801.2 C0802.1 C0803.1 C0804.1 C0805.1 C0806.1 C0807.1 C0811.+(A) C0812.1 C0841.2 C0843.2 C0850.2 C0851.2 C0852.2 C0853.2 C0856.2 C0859.2 C0861.2 C0863.2 C0865.2 C0872.1 L0871.2 Q0811.2 Q0811.4 U0801.15(GND) U0801.23(GND) U0801.26(GND) U0801.29(GND) ; also sheet 1,3,4,5,6,7,9,10,11,12,13,14,15,16,17,18,19,20,21,22,23,24
MCU_OUT_SX_SEL: U0801.19(NSS) ; also sheet 2
MCU_SPI3_MOSI: U0801.18(MOSI) ; also sheet 2,10,11
MCU_SPI3_SCK: U0801.16(SCLK) ; also sheet 2,10,11
PC11: R0831.1 ; also sheet 1,2,10,11
PD8: R0821.1 ; also sheet 1
PG2: R0802.2 ; also sheet 1
PG3: R0803.2 ; also sheet 1
SX_DIO0: R0802.1 TP_SX_DIO0.TP U0801.8(DIO0)
SX_DIO1: R0803.1 TP_SX_DIO1.TP U0801.9(DIO1)
SX_DIO2: R0804.1 TP_SX_DIO2.TP U0801.10(DIO2)
SX_DIO2_2: R0804.2
SX_DIO3: R0805.1 TP_SX_DIO3.TP U0801.11(DIO3)
SX_DIO3_2: R0805.2
SX_DIO4: R0806.1 TP_SX_DIO4.TP U0801.12(DIO4)
SX_DIO4_2: R0806.2
SX_DIO5: R0807.1 TP_SX_DIO5.TP U0801.13(DIO5)
SX_DIO5_2: R0807.2
SX_MISO: R0831.2 U0801.17(MISO)
SX_NRESET: R0821.2 U0801.7(!RESET)
SX_RFI_HF: C0841.1 L0842.1 U0801.21(RFI_HF)
SX_RFI_HF_2: C0843.1 C0844.1 L0842.2
SX_RFI_HF_3: C0844.2 R0845.1
SX_RFI_HF_4: C0846.1 R0845.2
SX_RFI_HF_5: C0846.2 ; also sheet 9
SX_RFI_LF: C0871.1 L0871.1 U0801.1(RFI_LF)
SX_RFI_LF_2: C0871.2 C0872.2 C0873.1
SX_RFI_LF_3: C0873.2 R0874.1
SX_RFI_LF_4: C0875.1 R0874.2
SX_RFI_LF_5: C0875.2 ; also sheet 9
SX_RFO_HF: C0861.1 C0862.1 L0861.1 U0801.22(RFO_HF)
SX_RFO_HF_2: C0862.2 L0862.1
SX_RFO_HF_3: C0863.1 C0864.1 L0862.2 L0864.1
SX_RFO_HF_4: C0864.2 C0865.1 L0864.2 ; also sheet 9
SX_RFO_LF: C0853.1 C0854.1 L0851.1 U0801.28(RFO_LF)
SX_RFO_LF_2: C0854.2 L0856.1
SX_RFO_LF_3: C0856.1 C0857.1 L0856.2 L0857.1
SX_RFO_LF_4: C0857.2 C0858.1 C0859.1 L0857.2 L0858.1
SX_RFO_LF_5: C0850.1 C0858.2 L0858.2 ; also sheet 9
SX_RXTX: R0801.1 TP_SX_RXTX.TP U0801.20(RXTX/RFMOD)
SX_RXTX_2: R0801.2 ; also sheet 9
SX_VR_ANA: C0806.2 U0801.2(VR_ANA)
SX_VR_DIG: C0807.2 U0801.4(VR_DIG)
SX_VR_PA: C0805.2 C0851.1 C0852.1 L0851.2 L0861.2 U0801.25(VR_PA)
SX_XTA: C0811.-(E) Q0811.1 U0801.5(XTA)
SX_XTB: R0811.1 U0801.6(XTB)
SX_XTB_R: C0812.2 Q0811.3 R0811.2
Unconnected: U0801.27(PA_BOOST)

### Notes on the sheet
- VHF / UHF  SX1276 - channel 1
  SPI
- MCU_SPI3_MISO
- MCU_EXTI2_SX_DIO0_TXRXDONE
- MCU_EXTI3_SX_DIO1_RXTO
- MCU_INOUT_SX_NRESET
- SX_DIO2_2 | NC
- SX_DIO3_2 | NC
- SX_DIO4_2 | NC
- SX_DIO5_2 | NC

## Sheet 9 of 24: VHF/UHF SX1276 - ch 1 - HF sw
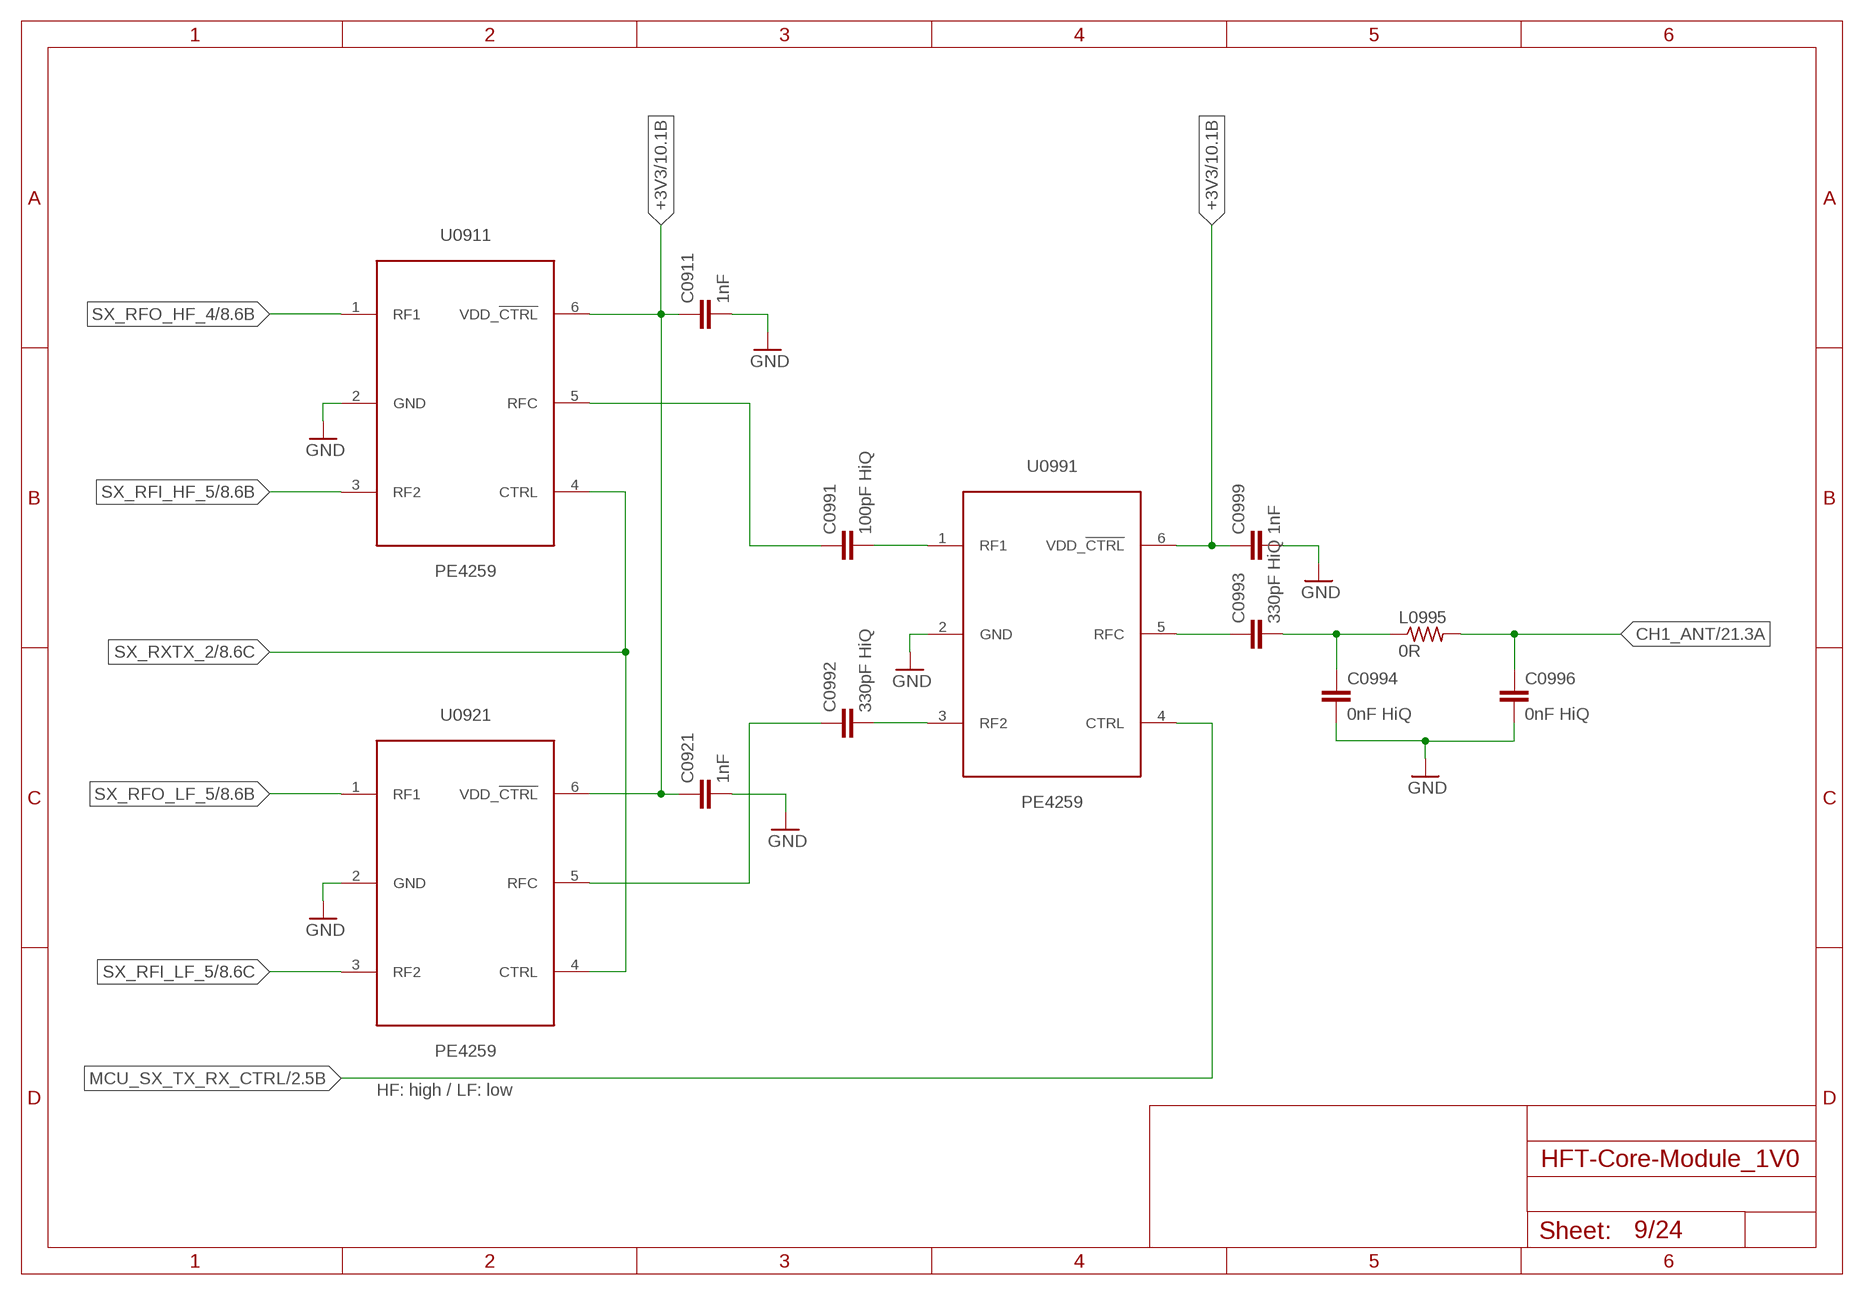
[diagram p8: schematic, sheet 9]

### Parts
C0911  1nF  C-EUC0603  [C0603]
C0921  1nF  C-EUC0603  [C0603]
C0991  100pF HiQ  C-EUC0603  [C0603]
C0992  330pF HiQ  C-EUC0603  [C0603]
C0993  330pF HiQ  C-EUC0603  [C0603]
C0994  0nF HiQ  C-EUC0603  [C0603]
C0996  0nF HiQ  C-EUC0603  [C0603]
C0999  1nF  C-EUC0603  [C0603]
L0995  0R  R-US_R0603  [R0603]
U0911  PE4259  [SC-70_6-LEAD_2X1MM25_0P65]
U0921  PE4259  [SC-70_6-LEAD_2X1MM25_0P65]
U0991  PE4259  [SC-70_6-LEAD_2X1MM25_0P65]

### Nets
+3V3: C0911.1 C0921.1 C0999.1 U0911.6(VDD_!CTRL) U0921.6(VDD_!CTRL) U0991.6(VDD_!CTRL) ; also sheet 1,3,4,6,8,10,12,13,16,17,18,19,23
CH1_ANT: C0996.1 L0995.2 ; also sheet 21
GND: C0911.2 C0921.2 C0994.2 C0996.2 C0999.2 U0911.2(GND) U0921.2(GND) U0991.2(GND) ; also sheet 1,3,4,5,6,7,8,10,11,12,13,14,15,16,17,18,19,20,21,22,23,24
MCU_SX_TX_RX_CTRL: U0991.4(CTRL) ; also sheet 2
SX_ANT_1: C0993.1 U0991.5(RFC)
SX_ANT_2: C0993.2 C0994.1 L0995.1
SX_HF_1: C0991.1 U0911.5(RFC)
SX_HF_2: C0991.2 U0991.1(RF1)
SX_LF_1: C0992.1 U0921.5(RFC)
SX_LF_2: C0992.2 U0991.3(RF2)
SX_RFI_HF_5: U0911.3(RF2) ; also sheet 8
SX_RFI_LF_5: U0921.3(RF2) ; also sheet 8
SX_RFO_HF_4: U0911.1(RF1) ; also sheet 8
SX_RFO_LF_5: U0921.1(RF1) ; also sheet 8
SX_RXTX_2: U0911.4(CTRL) U0921.4(CTRL) ; also sheet 8

### Notes on the sheet
- HF: high / LF: low

## Sheet 10 of 24: VHF/UHF AX5243 - ch 2
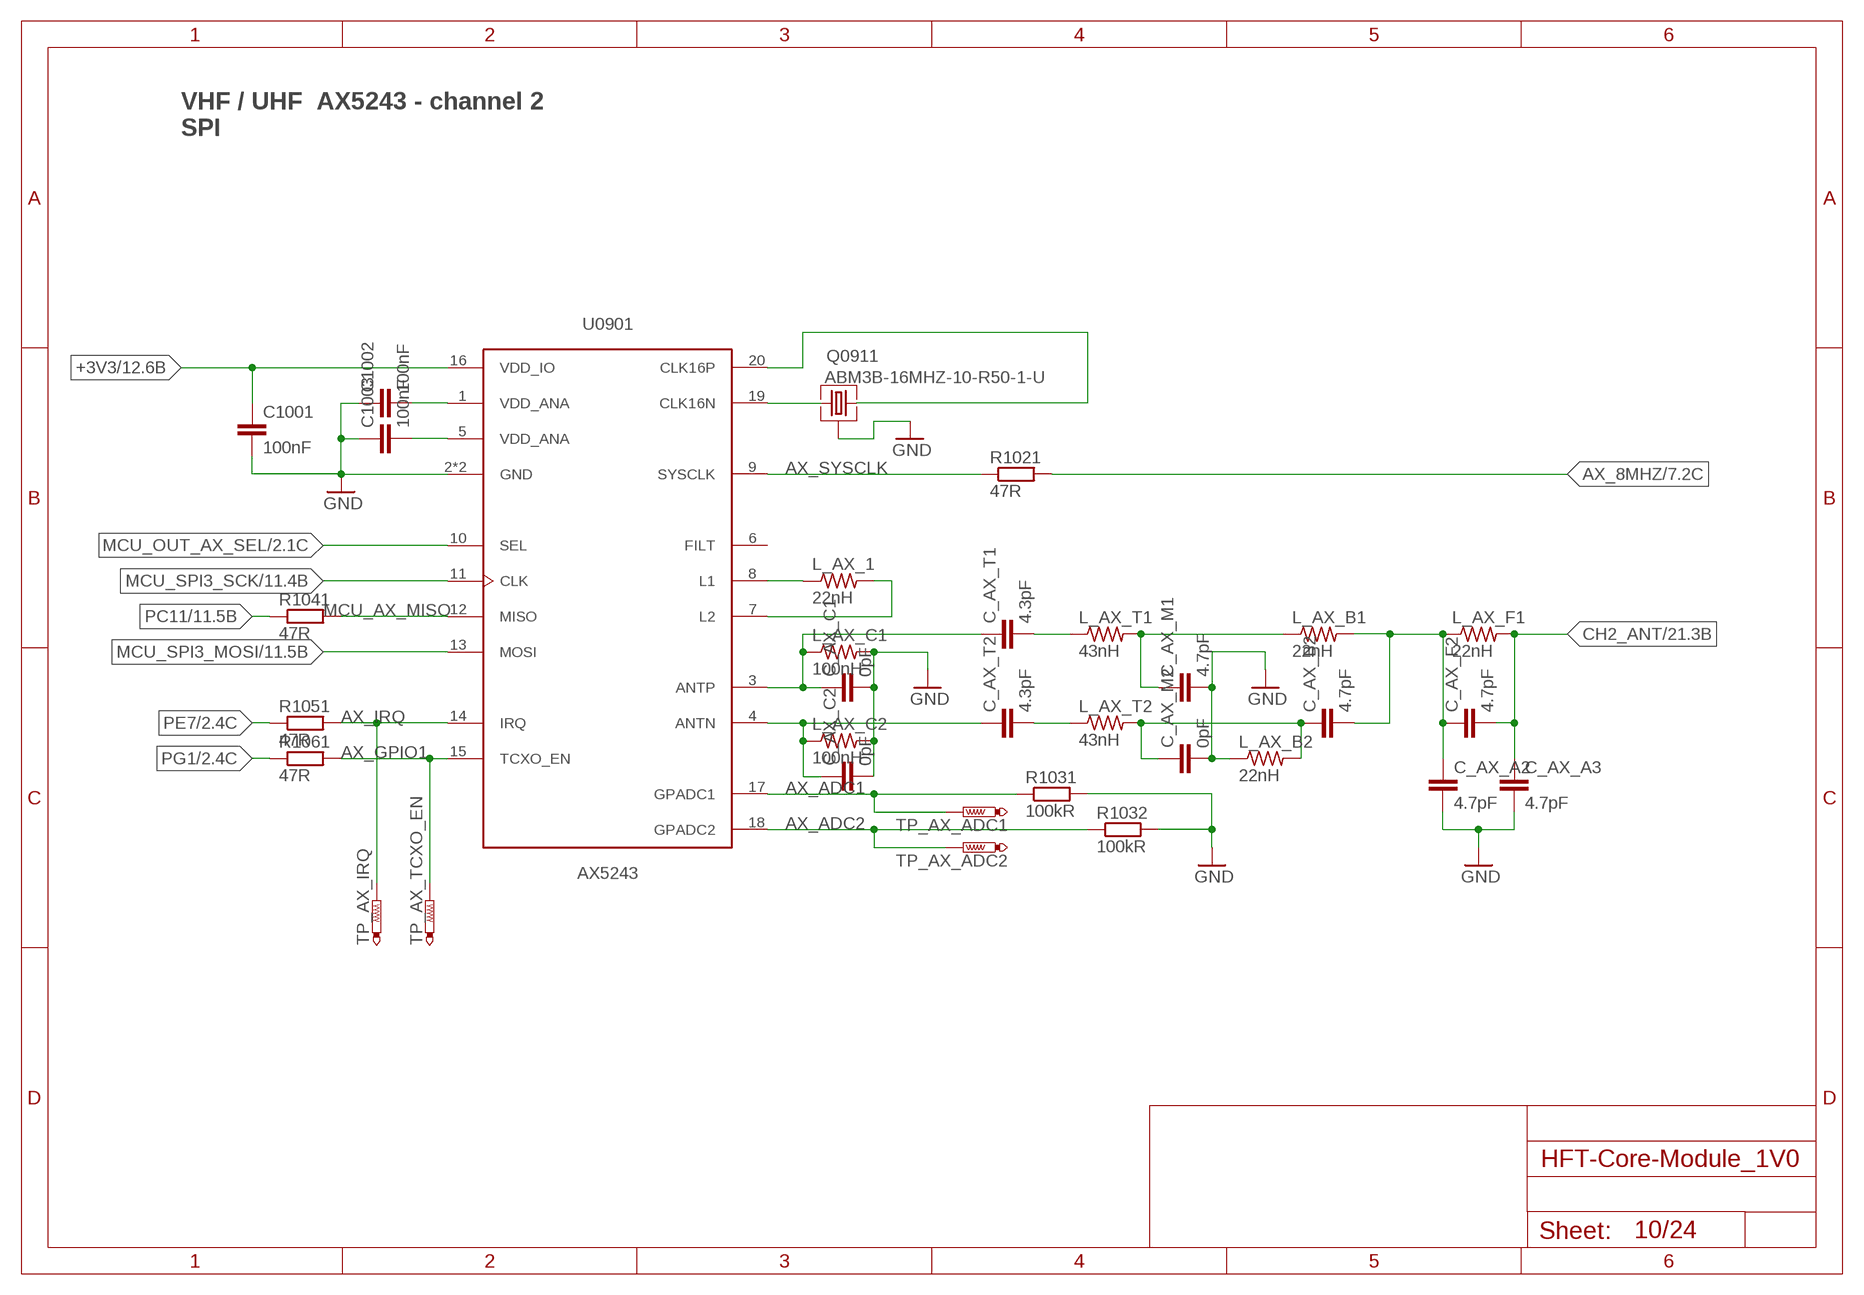
[diagram p9: schematic, sheet 10]

### Parts
C1001  100nF  C-EUC0603  [C0603]
C1002  100nF  C-EUC0603  [C0603]
C1003  100nF  C-EUC0603  [C0603]
C_AX_A2  4.7pF  C-EUC0603  [C0603]
C_AX_A3  4.7pF  C-EUC0603  [C0603]
C_AX_B2  4.7pF  C-EUC0603  [C0603]
C_AX_C1  0pF  C-EUC0603  [C0603]
C_AX_C2  0pF  C-EUC0603  [C0603]
C_AX_F2  4.7pF  C-EUC0603  [C0603]
C_AX_M1  4.7pF  C-EUC0603  [C0603]
C_AX_M2  0pF  C-EUC0603  [C0603]
C_AX_T1  4.3pF  C-EUC0603  [C0603]
C_AX_T2  4.3pF  C-EUC0603  [C0603]
L_AX_1  22nH  R-US_R0603  [R0603]
L_AX_B1  22nH  R-US_R0603  [R0603]
L_AX_B2  22nH  R-US_R0603  [R0603]
L_AX_C1  100nH  R-US_R0603  [R0603]
L_AX_C2  100nH  R-US_R0603  [R0603]
L_AX_F1  22nH  R-US_R0603  [R0603]
L_AX_T1  43nH  R-US_R0603  [R0603]
L_AX_T2  43nH  R-US_R0603  [R0603]
Q0911  ABM3B-16MHZ-10-R50-1-U  ABM03B-16.000MHZ  [ABM03B]
R1021  47R  R-EU_R0603  [R0603]
R1031  100kR  R-EU_R0603  [R0603]
R1032  100kR  R-EU_R0603  [R0603]
R1041  47R  R-EU_R0603  [R0603]
R1051  47R  R-EU_R0603  [R0603]
R1061  47R  R-EU_R0603  [R0603]
TP_AX_ADC1  PTR1TP06R  [TP06R]
TP_AX_ADC2  PTR1TP06R  [TP06R]
TP_AX_IRQ  PTR1TP06R  [TP06R]
TP_AX_TCXO_EN  PTR1TP06R  [TP06R]
U0901  AX5243  [QFN20-4X4-0P5-PAD]

### Nets
+3V3: C1001.1 U0901.16(VDD_IO) ; also sheet 1,3,4,6,8,9,12,13,16,17,18,19,23
AX_8MHZ: R1021.2 ; also sheet 7
AX_ADC1: R1031.1 TP_AX_ADC1.TP U0901.17(GPADC1)
AX_ADC2: R1032.1 TP_AX_ADC2.TP U0901.18(GPADC2)
AX_ANTN: C_AX_C2.1 C_AX_T2.1 L_AX_C2.1 U0901.4(ANTN)
AX_ANTP: C_AX_C1.1 C_AX_T1.1 L_AX_C1.1 U0901.3(ANTP)
AX_B1: C_AX_M1.1 L_AX_B1.1 L_AX_T1.2
AX_B2: C_AX_B2.1 C_AX_M2.1 L_AX_B2.2 L_AX_T2.2
AX_CLK16N: Q0911.1 U0901.19(CLK16N)
AX_CLK16P: Q0911.3 U0901.20(CLK16P)
AX_COMB: C_AX_A2.1 C_AX_B2.2 C_AX_F2.1 L_AX_B1.2 L_AX_F1.1
AX_GPIO1: R1061.2 TP_AX_TCXO_EN.TP U0901.15(TCXO_EN)
AX_IRQ: R1051.2 TP_AX_IRQ.TP U0901.14(IRQ)
AX_L1: L_AX_1.1 U0901.8(L1)
AX_L2: L_AX_1.2 U0901.7(L2)
AX_SYSCLK: R1021.1 U0901.9(SYSCLK)
AX_T1: C_AX_T1.2 L_AX_T1.1
AX_T2: C_AX_T2.2 L_AX_T2.1
AX_VDD1: C1002.2 U0901.1(VDD_ANA)
AX_VDD5: C1003.2 U0901.5(VDD_ANA)
CH2_ANT: C_AX_A3.1 C_AX_F2.2 L_AX_F1.2 ; also sheet 21
GND: C1001.2 C1002.1 C1003.1 C_AX_A2.2 C_AX_A3.2 C_AX_C1.2 C_AX_C2.2 C_AX_M1.2 C_AX_M2.2 L_AX_B2.1 L_AX_C1.2 L_AX_C2.2 Q0911.2 Q0911.4 R1031.2 R1032.2 U0901.2(GND) U0901.21(GND) ; also sheet 1,3,4,5,6,7,8,9,11,12,13,14,15,16,17,18,19,20,21,22,23,24
MCU_AX_MISO: R1041.2 U0901.12(MISO)
MCU_OUT_AX_SEL: U0901.10(SEL) ; also sheet 2
MCU_SPI3_MOSI: U0901.13(MOSI) ; also sheet 2,8,11
MCU_SPI3_SCK: U0901.11(CLK) ; also sheet 2,8,11
PC11: R1041.1 ; also sheet 1,2,8,11
PE7: R1051.1 ; also sheet 1,2
PG1: R1061.1 ; also sheet 1,2
Unconnected: U0901.6(FILT)

### Notes on the sheet
- VHF / UHF  AX5243 - channel 2
  SPI

## Sheet 11 of 24: Audio AD/DA
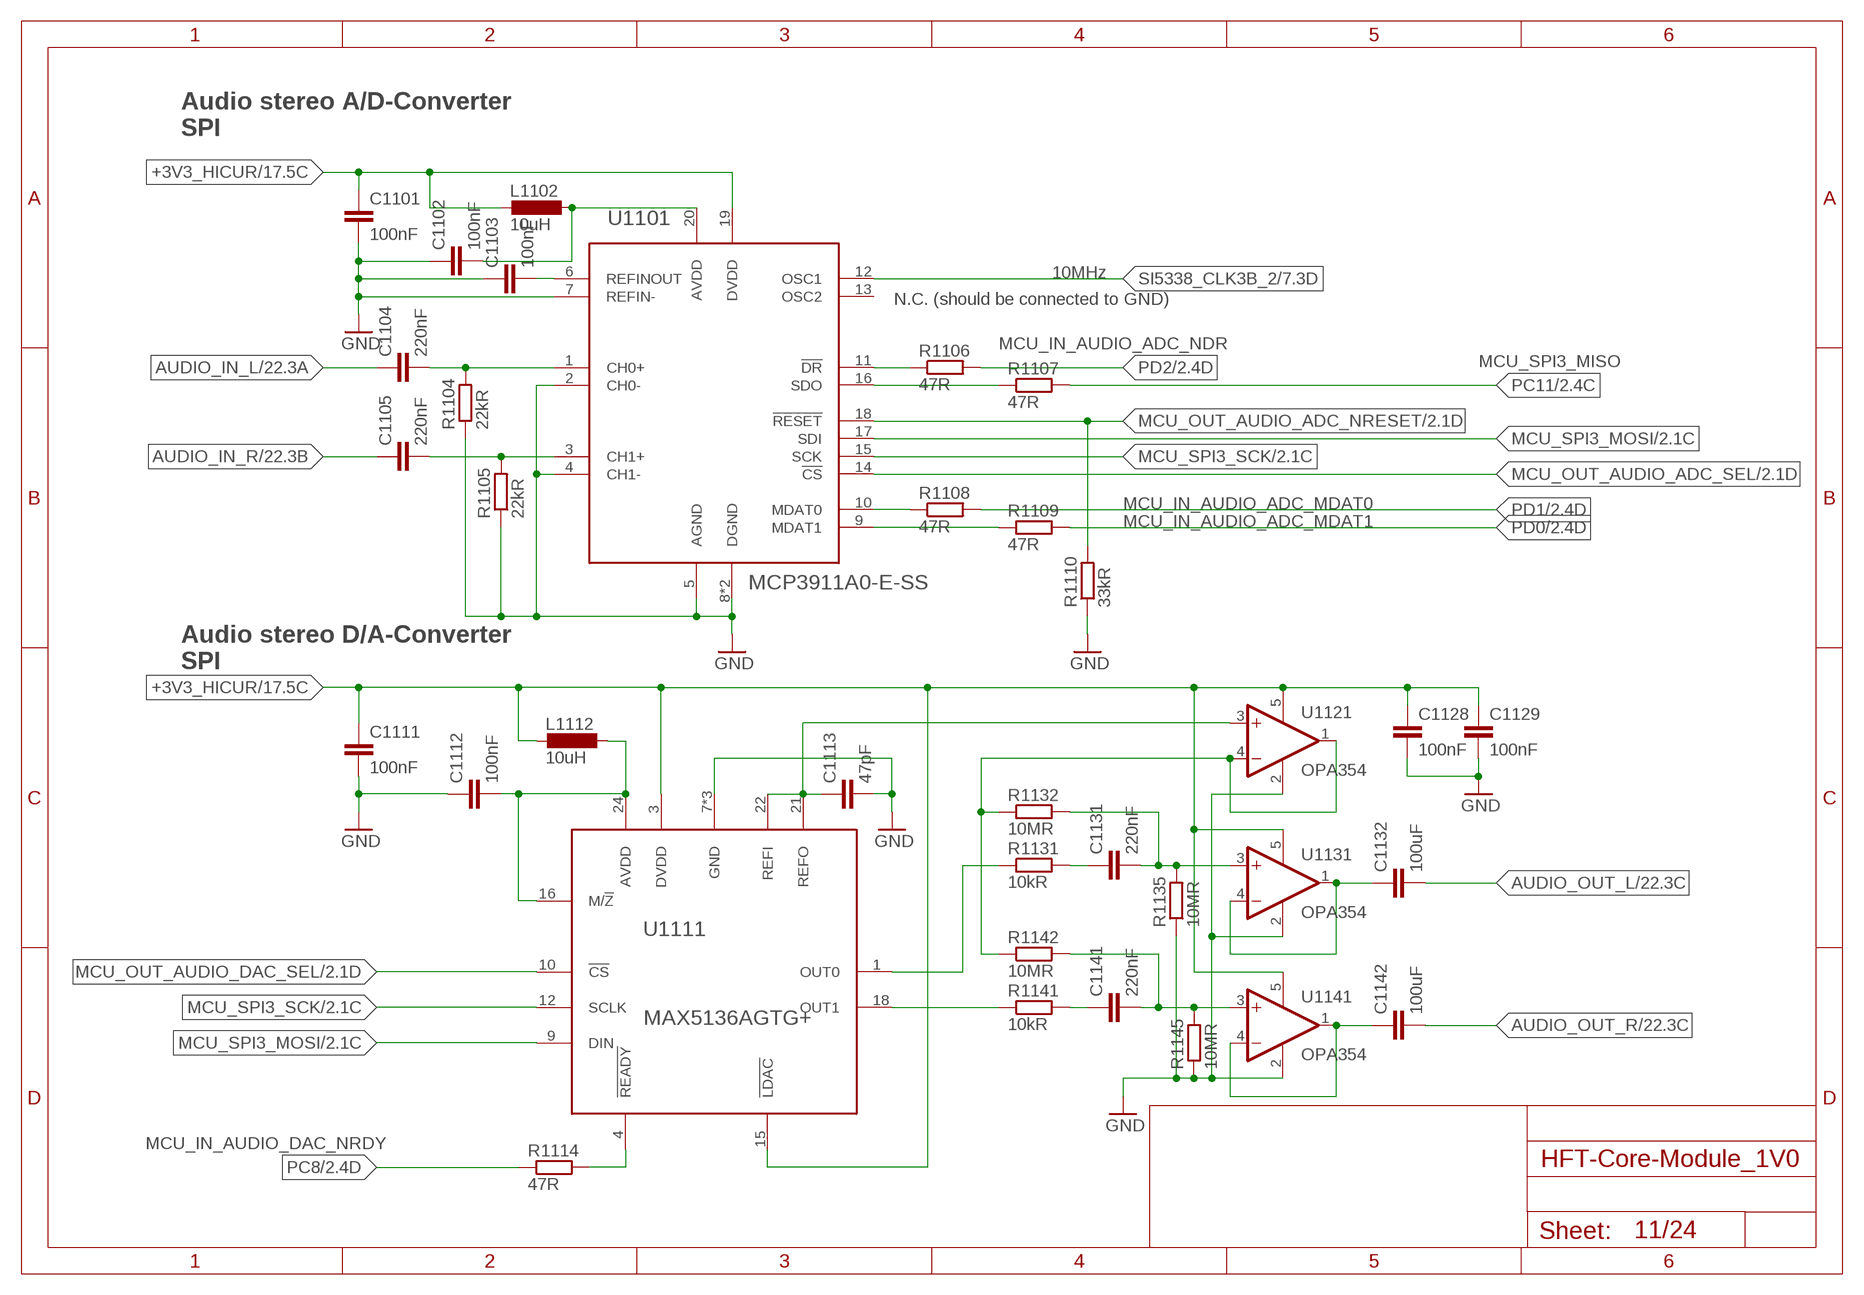
[diagram p10: schematic, sheet 11]

### Parts
C1101  100nF  C-EUC0603  [C0603]
C1102  100nF  C-EUC0603  [C0603]
C1103  100nF  C-EUC0603  [C0603]
C1104  220nF  C-EUC0603  [C0603]
C1105  220nF  C-EUC0603  [C0603]
C1111  100nF  C-EUC0603  [C0603]
C1112  100nF  C-EUC0603  [C0603]
C1113  47pF  C-EUC0603  [C0603]
C1128  100nF  C-EUC0603  [C0603]
C1129  100nF  C-EUC0603  [C0603]
C1131  220nF  C-EUC0603  [C0603]
C1132  100uF  C-EUC0805  [C0805]
C1141  220nF  C-EUC0603  [C0603]
C1142  100uF  C-EUC0805  [C0805]
L1102  10uH  L-EUL2012C  [L2012C]
L1112  10uH  L-EUL2012C  [L2012C]
R1104  22kR  R-EU_R0603  [R0603]
R1105  22kR  R-EU_R0603  [R0603]
R1106  47R  R-EU_R0603  [R0603]
R1107  47R  R-EU_R0603  [R0603]
R1108  47R  R-EU_R0603  [R0603]
R1109  47R  R-EU_R0603  [R0603]
R1110  33kR  R-EU_R0603  [R0603]
R1114  47R  R-EU_R0603  [R0603]
R1131  10kR  R-EU_R0603  [R0603]
R1132  10MR  R-EU_R0603  [R0603]
R1135  10MR  R-EU_R0603  [R0603]
R1141  10kR  R-EU_R0603  [R0603]
R1142  10MR  R-EU_R0603  [R0603]
R1145  10MR  R-EU_R0603  [R0603]
U1101  MCP3911A0-E-SS  MCP3911  [QFN20_P0MM5_CTRPAD]
U1111  MAX5136AGTG+  MAX5136  [QFN24_P0MM5_CTRPAD]
U1121  OPA354  [SOT-23-5]
U1131  OPA354  [SOT-23-5]
U1141  OPA354  [SOT-23-5]

### Nets
+3V3_HICUR: C1101.1 C1111.1 C1128.1 C1129.1 L1102.2 L1112.2 U1101.19(DVDD) U1111.3(DVDD) U1111.15(!LDAC) U1121.5(V+) U1131.5(V+) U1141.5(V+) ; also sheet 7,17
AUDIO_IN_L: C1104.1 ; also sheet 22
AUDIO_IN_R: C1105.1 ; also sheet 22
AUDIO_OUT_L: C1132.2 ; also sheet 22
AUDIO_OUT_L_OP: C1132.1 U1131.1(OUT) U1131.4(-IN)
AUDIO_OUT_R: C1142.2 ; also sheet 22
AUDIO_OUT_R_OP: C1142.1 U1141.1(OUT) U1141.4(-IN)
GND: C1101.2 C1102.1 C1103.1 C1111.2 C1112.1 C1113.2 C1128.2 C1129.2 R1104.1 R1105.1 R1110.1 R1135.1 R1145.1 U1101.2(CH0-) U1101.4(CH1-) U1101.5(AGND) U1101.7(REFIN-) U1101.8(DGND) U1101.21(DGND) U1111.7(GND) U1111.19(GND) U1111.25(GND) U1121.2(V-) U1131.2(V-) U1141.2(V-) ; also sheet 1,3,4,5,6,7,8,9,10,12,13,14,15,16,17,18,19,20,21,22,23,24
MAX5136_!READY: R1114.2 U1111.4(!READY)
MAX5136_AVDD: C1112.2 L1112.1 U1111.16(M/!Z) U1111.24(AVDD)
MAX5136_OUT0: R1131.1 U1111.1(OUT0)
MAX5136_OUT0_R: C1131.1 R1131.2
MAX5136_OUT0_SUM: C1131.2 R1132.2 R1135.2 U1131.3(+IN)
MAX5136_OUT1: R1141.1 U1111.18(OUT1)
MAX5136_OUT1_R: C1141.1 R1141.2
MAX5136_OUT1_SUM: C1141.2 R1142.2 R1145.2 U1141.3(+IN)
MAX5136_REF: C1113.1 U1111.21(REFO) U1111.22(REFI) U1121.3(+IN)
MAX5136_REF_OP: R1132.1 R1142.1 U1121.1(OUT) U1121.4(-IN)
MCP3911_!DR: R1106.1 U1101.11(!DR)
MCP3911_CH0+: C1104.2 R1104.2 U1101.1(CH0+)
MCP3911_CH1+: C1105.2 R1105.2 U1101.3(CH1+)
MCP3911_MDAT0: R1108.1 U1101.10(MDAT0)
MCP3911_MDAT1: R1109.1 U1101.9(MDAT1)
MCP3911_REFINOUT: C1103.2 U1101.6(REFINOUT)
MCP3911_SDO: R1107.1 U1101.16(SDO)
MCU_OUT_AUDIO_ADC_NRESET: R1110.2 U1101.18(!RESET) ; also sheet 2
MCU_OUT_AUDIO_ADC_SEL: U1101.14(!CS) ; also sheet 2
MCU_OUT_AUDIO_DAC_SEL: U1111.10(!CS) ; also sheet 2
MCU_SPI3_MOSI: U1101.17(SDI) U1111.9(DIN) ; also sheet 2,8,10
MCU_SPI3_SCK: U1101.15(SCK) U1111.12(SCLK) ; also sheet 2,8,10
MVP3911_AVDD: C1102.2 L1102.1 U1101.20(AVDD)
PC8: R1114.1 ; also sheet 1,2
PC11: R1107.2 ; also sheet 1,2,8,10
PD0: R1109.2 ; also sheet 1,2
PD1: R1108.2 ; also sheet 1,2
PD2: R1106.2 ; also sheet 1,2
SI5338_CLK3B_2: U1101.12(OSC1) ; also sheet 7
Unconnected: U1101.13(OSC2)

### Notes on the sheet
- Audio stereo A/D-Converter
  SPI
- 10MHz
- N.C. (should be connected to GND)
- MCU_IN_AUDIO_ADC_NDR
- MCU_SPI3_MISO
- MCU_IN_AUDIO_ADC_MDAT0
- MCU_IN_AUDIO_ADC_MDAT1
- Audio stereo D/A-Converter
  SPI
- MCU_IN_AUDIO_DAC_NRDY

## Sheet 12 of 24: LCD / Encoder
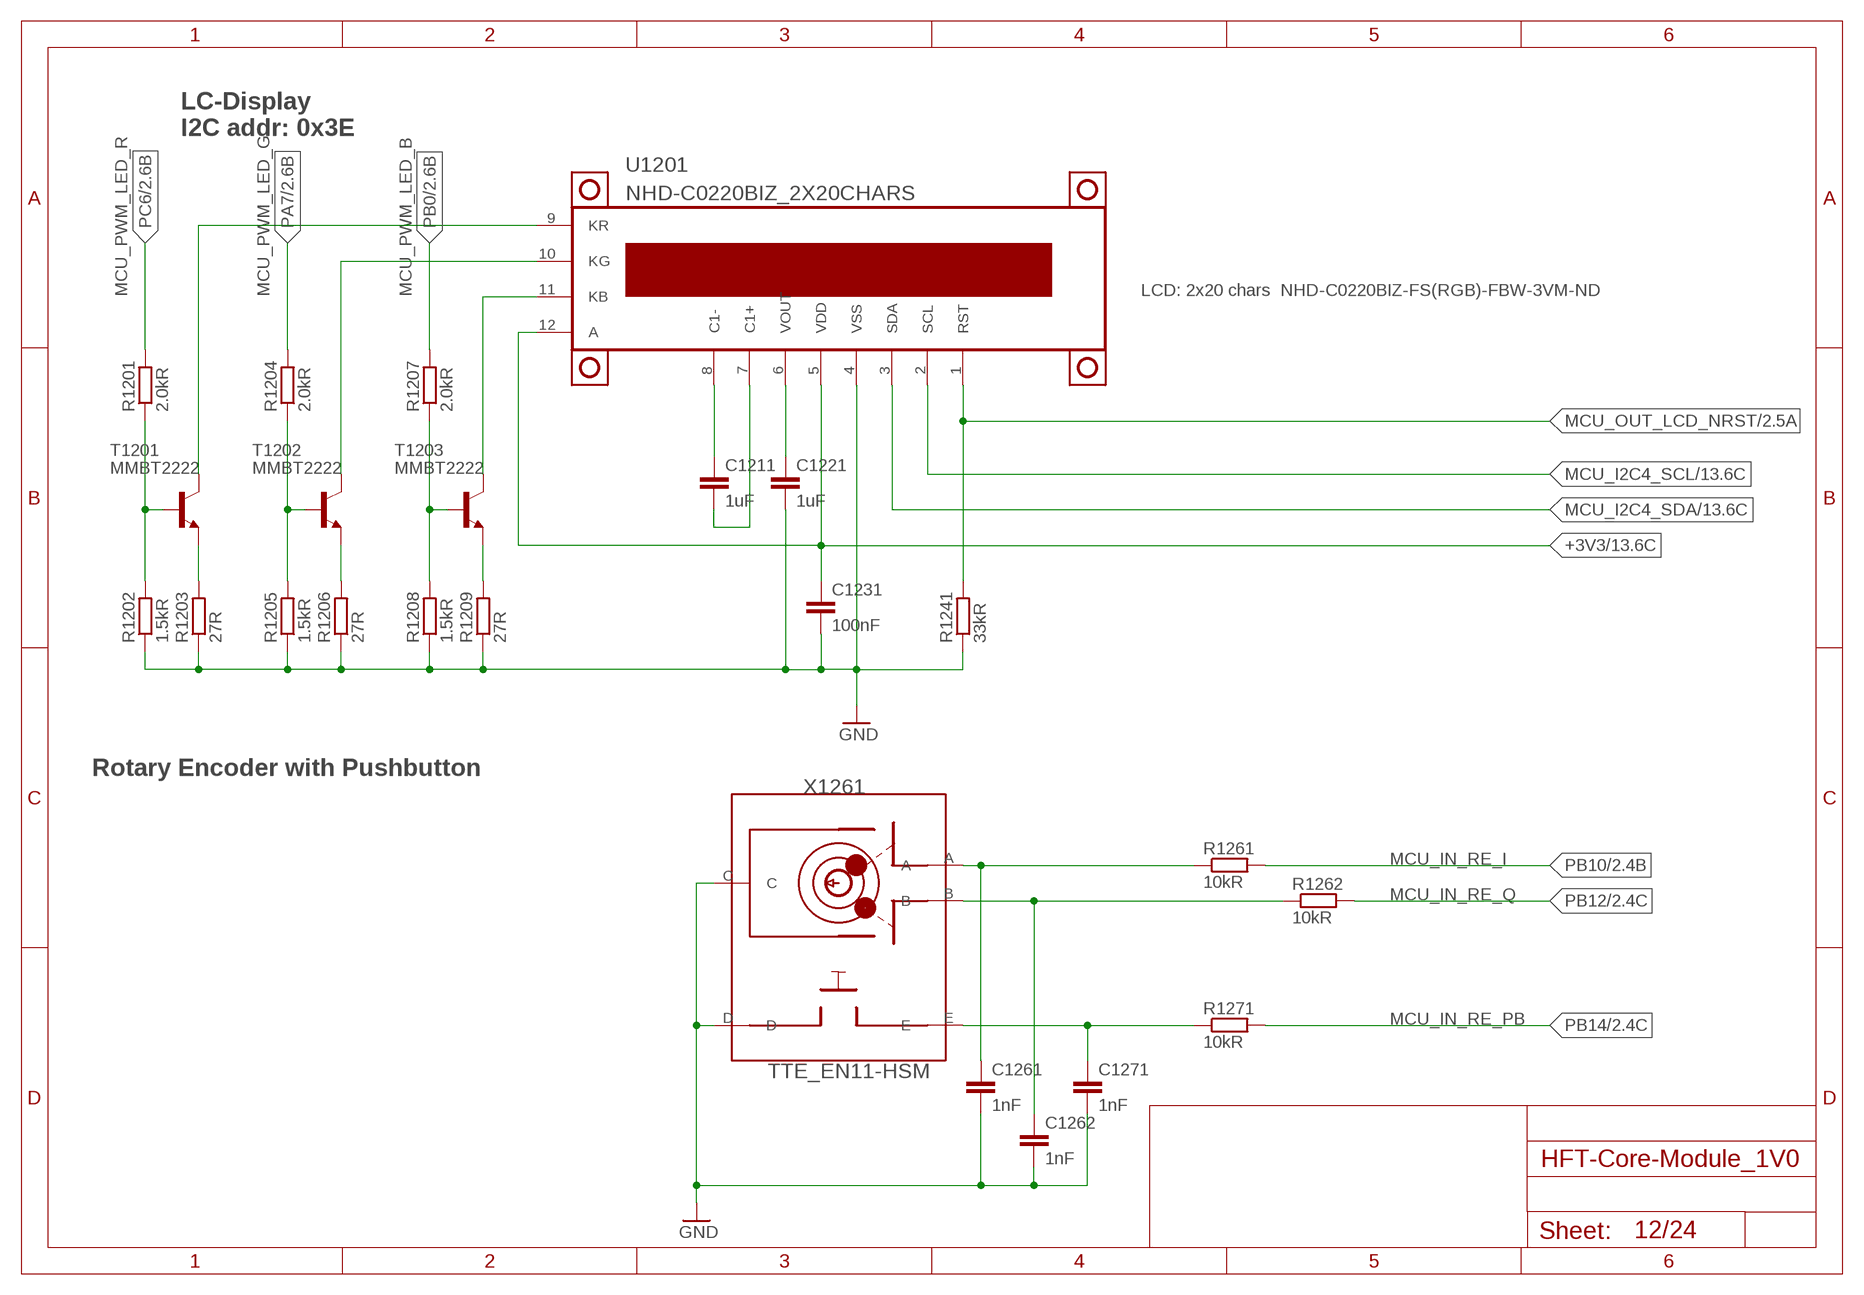
[diagram p11: schematic, sheet 12]

### Parts
C1211  1uF  C-EUC0805  [C0805]
C1221  1uF  C-EUC0805  [C0805]
C1231  100nF  C-EUC0603  [C0603]
C1261  1nF  C-EUC0603  [C0603]
C1262  1nF  C-EUC0603  [C0603]
C1271  1nF  C-EUC0603  [C0603]
R1201  2.0kR  R-EU_R0603  [R0603]
R1202  1.5kR  R-EU_R0603  [R0603]
R1203  27R  R-EU_R0805  [R0805]
R1204  2.0kR  R-EU_R0603  [R0603]
R1205  1.5kR  R-EU_R0603  [R0603]
R1206  27R  R-EU_R0805  [R0805]
R1207  2.0kR  R-EU_R0603  [R0603]
R1208  1.5kR  R-EU_R0603  [R0603]
R1209  27R  R-EU_R0805  [R0805]
R1241  33kR  R-EU_R0603  [R0603]
R1261  10kR  R-EU_R0603  [R0603]
R1262  10kR  R-EU_R0603  [R0603]
R1271  10kR  R-EU_R0603  [R0603]
T1201  MMBT2222  BC846  [SOT23]
T1202  MMBT2222  BC846  [SOT23]
T1203  MMBT2222  BC846  [SOT23]
U1201  NHD-C0220BIZ_2X20CHARS  [NHD-C0220BIZ_2X20CHARS]
X1261  TTE_EN11-HSM  [TTE_EN11-HSM]

### Nets
+3V3: C1231.1 U1201.5(VDD) U1201.12(A) ; also sheet 1,3,4,6,8,9,10,13,16,17,18,19,23
GND: C1221.2 C1231.2 C1261.2 C1262.2 C1271.2 R1202.1 R1203.1 R1205.1 R1206.1 R1208.1 R1209.1 R1241.1 U1201.4(VSS) X1261.C X1261.D ; also sheet 1,3,4,5,6,7,8,9,10,11,13,14,15,16,17,18,19,20,21,22,23,24
LCD_C1+: C1211.2 U1201.7(C1+)
LCD_C1-: C1211.1 U1201.8(C1-)
LCD_VOUT: C1221.1 U1201.6(VOUT)
LED_B_B: R1207.1 R1208.2 T1203.1(B)
LED_B_E: R1209.2 T1203.2(E)
LED_B_K: T1203.3(C) U1201.11(KB)
LED_G_B: R1204.1 R1205.2 T1202.1(B)
LED_G_E: R1206.2 T1202.2(E)
LED_G_K: T1202.3(C) U1201.10(KG)
LED_R_B: R1201.1 R1202.2 T1201.1(B)
LED_R_E: R1203.2 T1201.2(E)
LED_R_K: T1201.3(C) U1201.9(KR)
MCU_I2C4_SCL: U1201.2(SCL) ; also sheet 2,6,7,13
MCU_I2C4_SDA: U1201.3(SDA) ; also sheet 2,6,7,13
MCU_OUT_LCD_NRST: R1241.2 U1201.1(RST) ; also sheet 2
PA7: R1204.2 ; also sheet 1,2
PB0: R1207.2 ; also sheet 1,2
PB10: R1261.2 ; also sheet 1,2
PB12: R1262.2 ; also sheet 1,2
PB14: R1271.2 ; also sheet 1,2
PC6: R1201.2 ; also sheet 1,2
ROTENC_A: C1261.1 R1261.1 X1261.A
ROTENC_B: C1262.1 R1262.1 X1261.B
ROTENC_E: C1271.1 R1271.1 X1261.E

### Notes on the sheet
- LC-Display
  I2C addr: 0x3E
- MCU_PWM_LED_R | MCU_PWM_LED_G | MCU_PWM_LED_B | LCD: 2x20 chars  NHD-C0220BIZ-FS(RGB)-FBW-3VM-ND
- Rotary Encoder with Pushbutton
- MCU_IN_RE_I
- MCU_IN_RE_Q
- MCU_IN_RE_PB

## Sheet 13 of 24: I2C Sensors
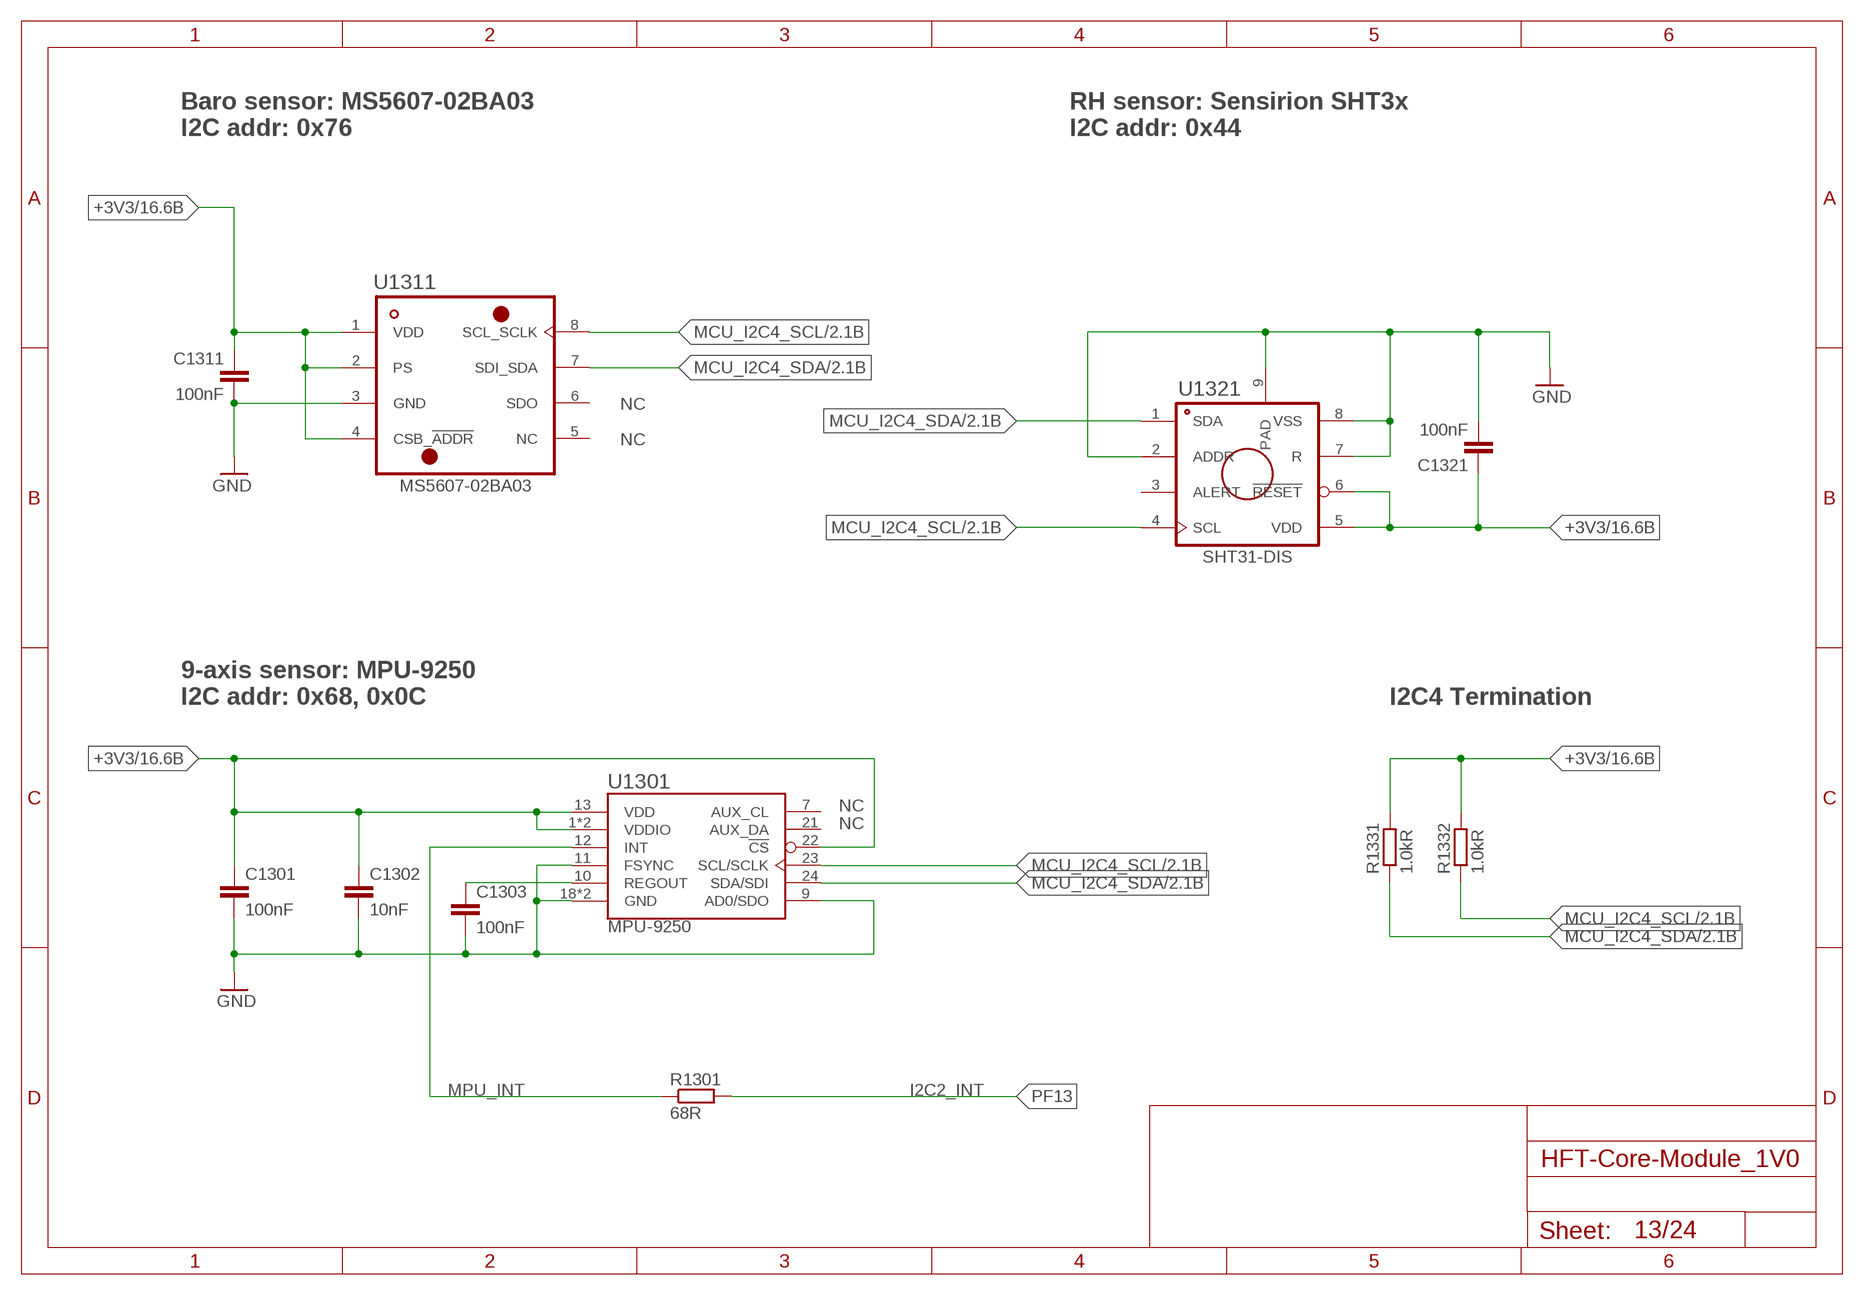
[diagram p12: schematic, sheet 13]

### Parts
C1301  100nF  C-EUC0603  [C0603]
C1302  10nF  C-EUC0603  [C0603]
C1303  100nF  C-EUC0603  [C0603]
C1311  100nF  C-EUC0603  [C0603]
C1321  100nF  C-EUC0603  [C0603]
R1301  68R  R-EU_R0603  [R0603]
R1331  1.0kR  R-EU_R0603  [R0603]
R1332  1.0kR  R-EU_R0603  [R0603]
U1301  MPU-9250  [QFN24-3X3]
U1311  MS5607-02BA03  [MS5607-02BA]
U1321  SHT31-DIS  [DFN8/SHT]

### Nets
+3V3: C1301.1 C1302.1 C1311.1 C1321.1 R1331.2 R1332.2 U1301.1(VDDIO) U1301.8(VDDIO) U1301.13(VDD) U1301.22(!CS) U1311.1(VDD) U1311.2(PS) U1311.4(CSB_!ADDR) U1321.5(VDD) U1321.6(!RESET) ; also sheet 1,3,4,6,8,9,10,12,16,17,18,19,23
GND: C1301.2 C1302.2 C1303.2 C1311.2 C1321.2 U1301.9(AD0/SDO) U1301.11(FSYNC) U1301.18(GND) U1301.20(GND) U1311.3(GND) U1321.2(ADDR) U1321.7(R) U1321.8(VSS) U1321.9(PAD) ; also sheet 1,3,4,5,6,7,8,9,10,11,12,14,15,16,17,18,19,20,21,22,23,24
MCU_I2C4_SCL: R1332.1 U1301.23(SCL/SCLK) U1311.8(SCL_SCLK) U1321.4(SCL) ; also sheet 2,6,7,12
MCU_I2C4_SDA: R1331.1 U1301.24(SDA/SDI) U1311.7(SDI_SDA) U1321.1(SDA) ; also sheet 2,6,7,12
MPU_INT: R1301.1 U1301.12(INT)
MPU_REGOUT: C1303.1 U1301.10(REGOUT)
PF13: R1301.2 ; also sheet 1
Unconnected: U1301.7(AUX_CL) U1301.21(AUX_DA) U1311.5(NC) U1311.6(SDO) U1321.3(ALERT)

### Notes on the sheet
- Baro sensor: MS5607-02BA03
  I2C addr: 0x76
- RH sensor: Sensirion SHT3x
  I2C addr: 0x44
- NC
- NC
- 9-axis sensor: MPU-9250
  I2C addr: 0x68, 0x0C
- I2C4 Termination
- NC
- NC
- I2C2_INT

## Sheet 14 of 24: Power Solar
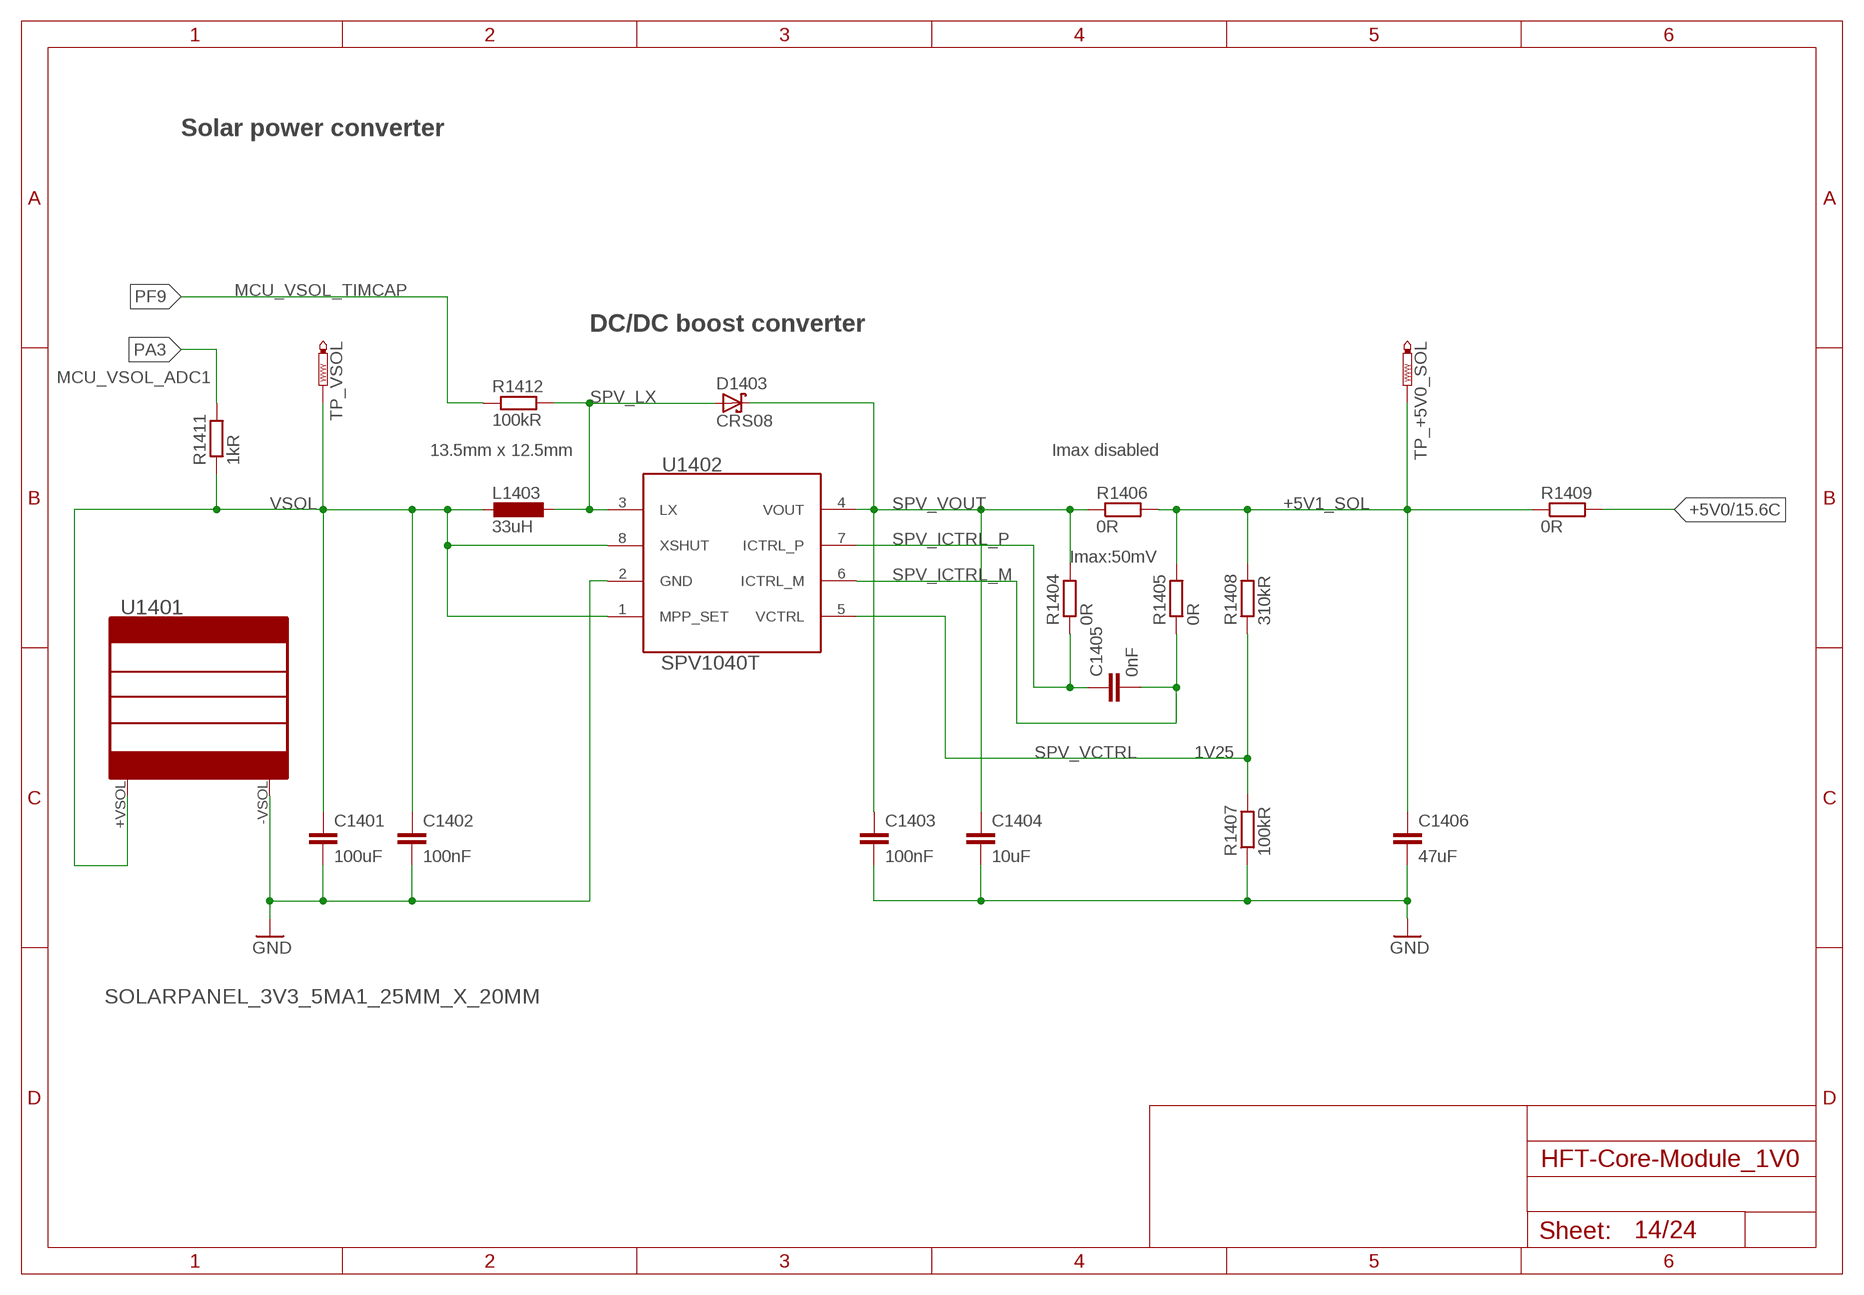
[diagram p13: schematic, sheet 14]

### Parts
C1401  100uF  C-EUC0805  [C0805]
C1402  100nF  C-EUC0603  [C0603]
C1403  100nF  C-EUC0603  [C0603]
C1404  10uF  C-EUC0805  [C0805]
C1405  0nF  C-EUC0603  [C0603]
C1406  47uF  C-EUC0805  [C0805]
D1403  CRS08  [SOD80C]
L1403  33uH  L-EU13.5X12.5MM  [L_13.5X12.5MM]
R1404  0R  R-EU_R0603  [R0603]
R1405  0R  R-EU_R0603  [R0603]
R1406  0R  R-EU_R0603  [R0603]
R1407  100kR  R-EU_R0603  [R0603]
R1408  310kR  R-EU_R0603  [R0603]
R1409  0R  R-EU_R0603  [R0603]
R1411  1kR  R-EU_R0603  [R0603]
R1412  100kR  R-EU_R0603  [R0603]
TP_+5V0_SOL  PTR1B1,27  [B1,27]
TP_VSOL  PTR1B1,27  [B1,27]
U1401  SOLARPANEL_3V3_5MA1_25MM_X_20MM  [SOLARPANEL_3V3_5MA1_25MM_X_20MM]
U1402  SPV1040T  SPV1040  [TSSOP8]

### Nets
+5V0 [pwrA5]: R1409.2 ; also sheet 15,16,23
+5V1_SOL: C1406.1 R1405.2 R1406.2 R1408.2 R1409.1 TP_+5V0_SOL.TP
GND: C1401.2 C1402.2 C1403.2 C1404.2 C1406.2 R1407.1 U1401.-VSOL U1402.2(GND) ; also sheet 1,3,4,5,6,7,8,9,10,11,12,13,15,16,17,18,19,20,21,22,23,24
PA3: R1411.2 ; also sheet 1
PF9: R1412.1 ; also sheet 1
SPV_ICTRL_M: C1405.2 R1405.1 U1402.6(ICTRL_M)
SPV_ICTRL_P: C1405.1 R1404.1 U1402.7(ICTRL_P)
SPV_LX: D1403.A L1403.1 R1412.2 U1402.3(LX)
SPV_VCTRL: R1407.2 R1408.1 U1402.5(VCTRL)
SPV_VOUT: C1403.1 C1404.1 D1403.C R1404.2 R1406.1 U1402.4(VOUT)
VSOL: C1401.1 C1402.1 L1403.2 R1411.1 TP_VSOL.TP U1401.+VSOL U1402.1(MPP_SET) U1402.8(XSHUT)

### Notes on the sheet
- Solar power converter
- MCU_VSOL_TIMCAP
- DC/DC boost converter
- MCU_VSOL_ADC1
- 13.5mm x 12.5mm | Imax disabled
- Imax:50mV
- 1V25

## Sheet 15 of 24: Power USB
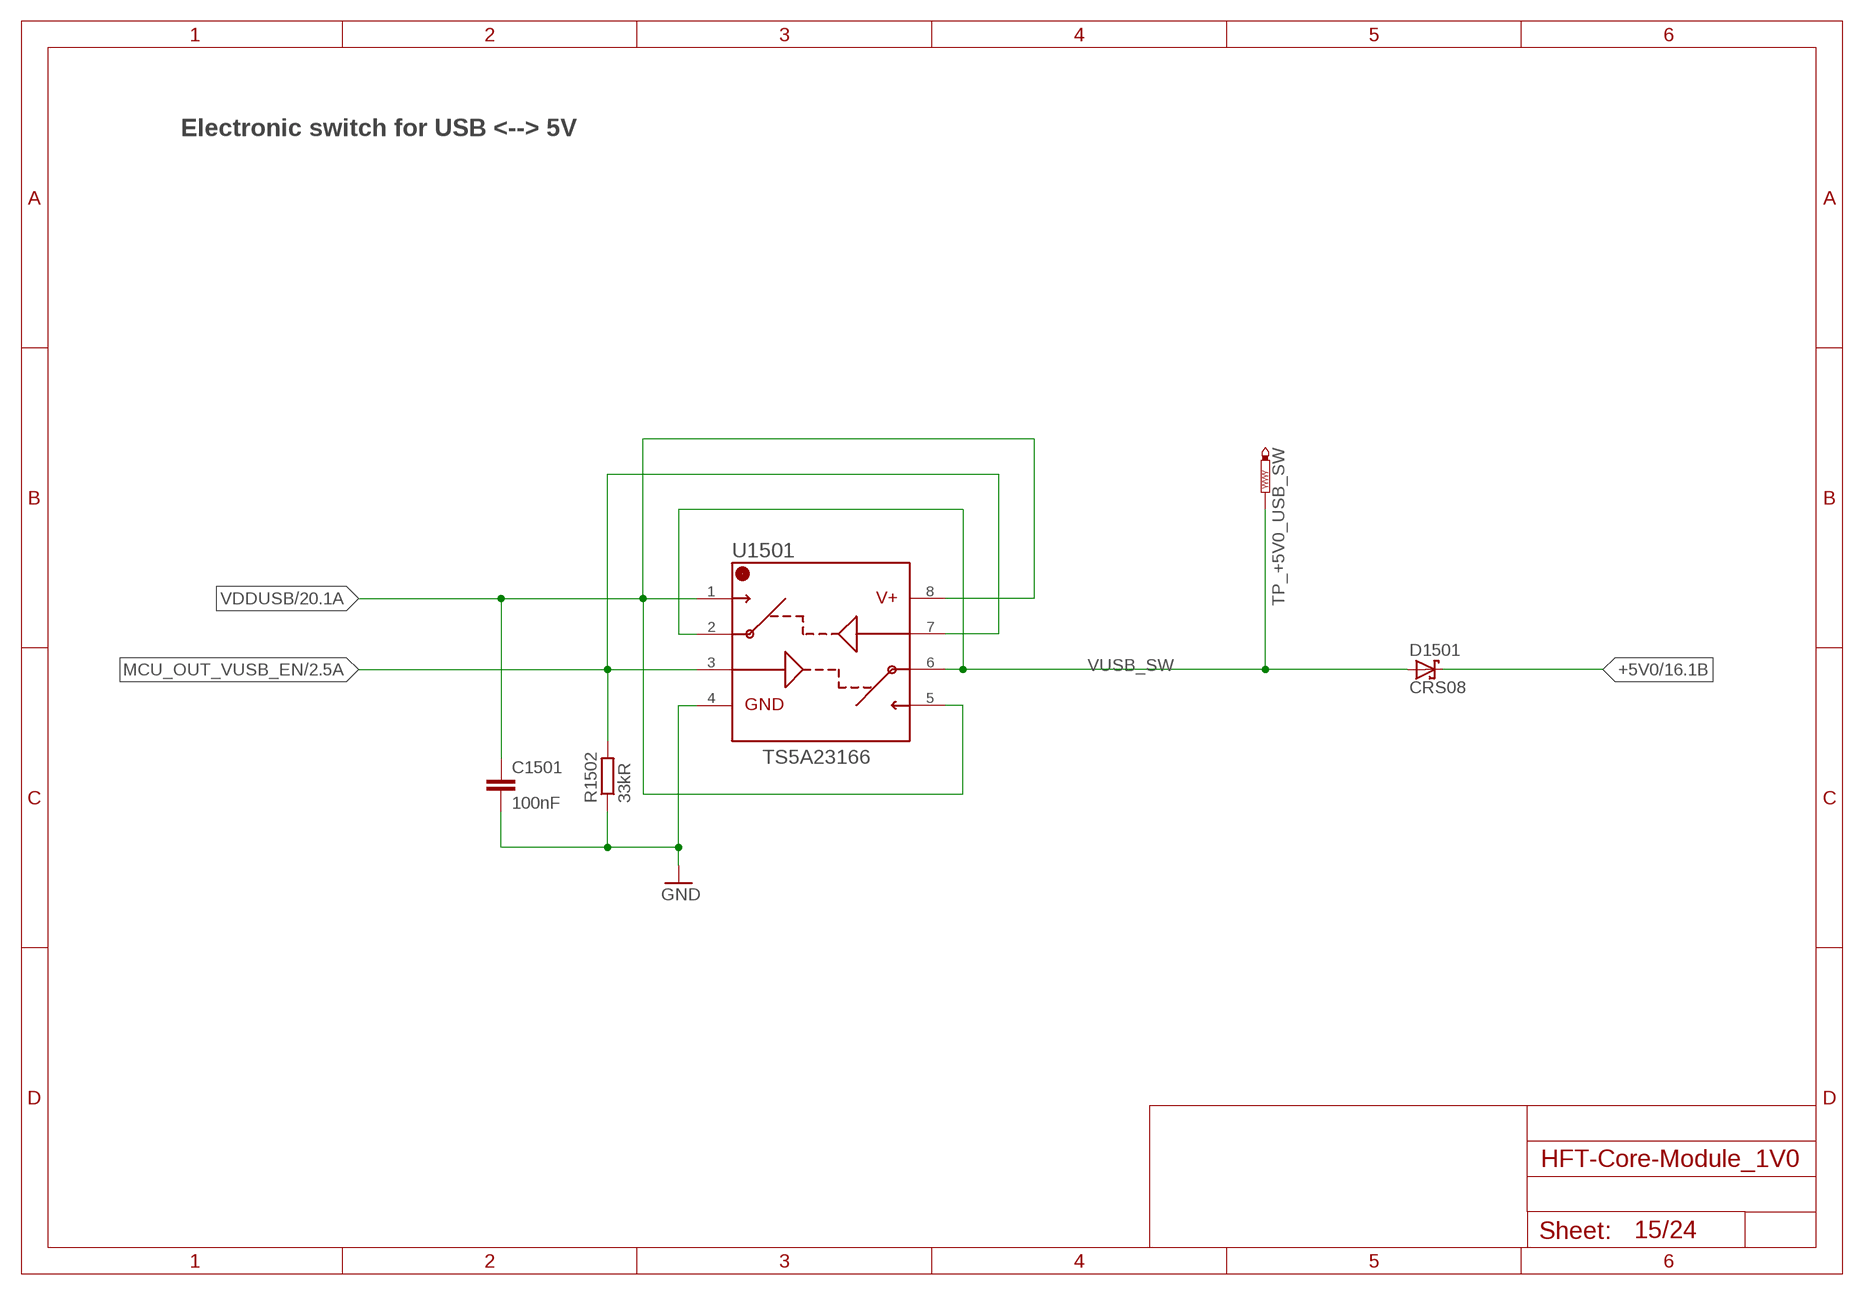
[diagram p14: schematic, sheet 15]

### Parts
C1501  100nF  C-EUC0603  [C0603]
D1501  CRS08  [SOD80C]
R1502  33kR  R-EU_R0603  [R0603]
TP_+5V0_USB_SW  PTR1B1,27  [B1,27]
U1501  TS5A23166  [R-PDSO-G8]

### Nets
+5V0 [pwrA5]: D1501.C ; also sheet 14,16,23
GND: C1501.2 R1502.1 U1501.4 ; also sheet 1,3,4,5,6,7,8,9,10,11,12,13,14,16,17,18,19,20,21,22,23,24
MCU_OUT_VUSB_EN: R1502.2 U1501.3 U1501.7 ; also sheet 2
VDDUSB: C1501.1 U1501.1 U1501.5 U1501.8 ; also sheet 20
VUSB_SW: D1501.A TP_+5V0_USB_SW.TP U1501.2 U1501.6

### Notes on the sheet
- Electronic switch for USB <--> 5V

## Sheet 16 of 24: 5V -> 3V3
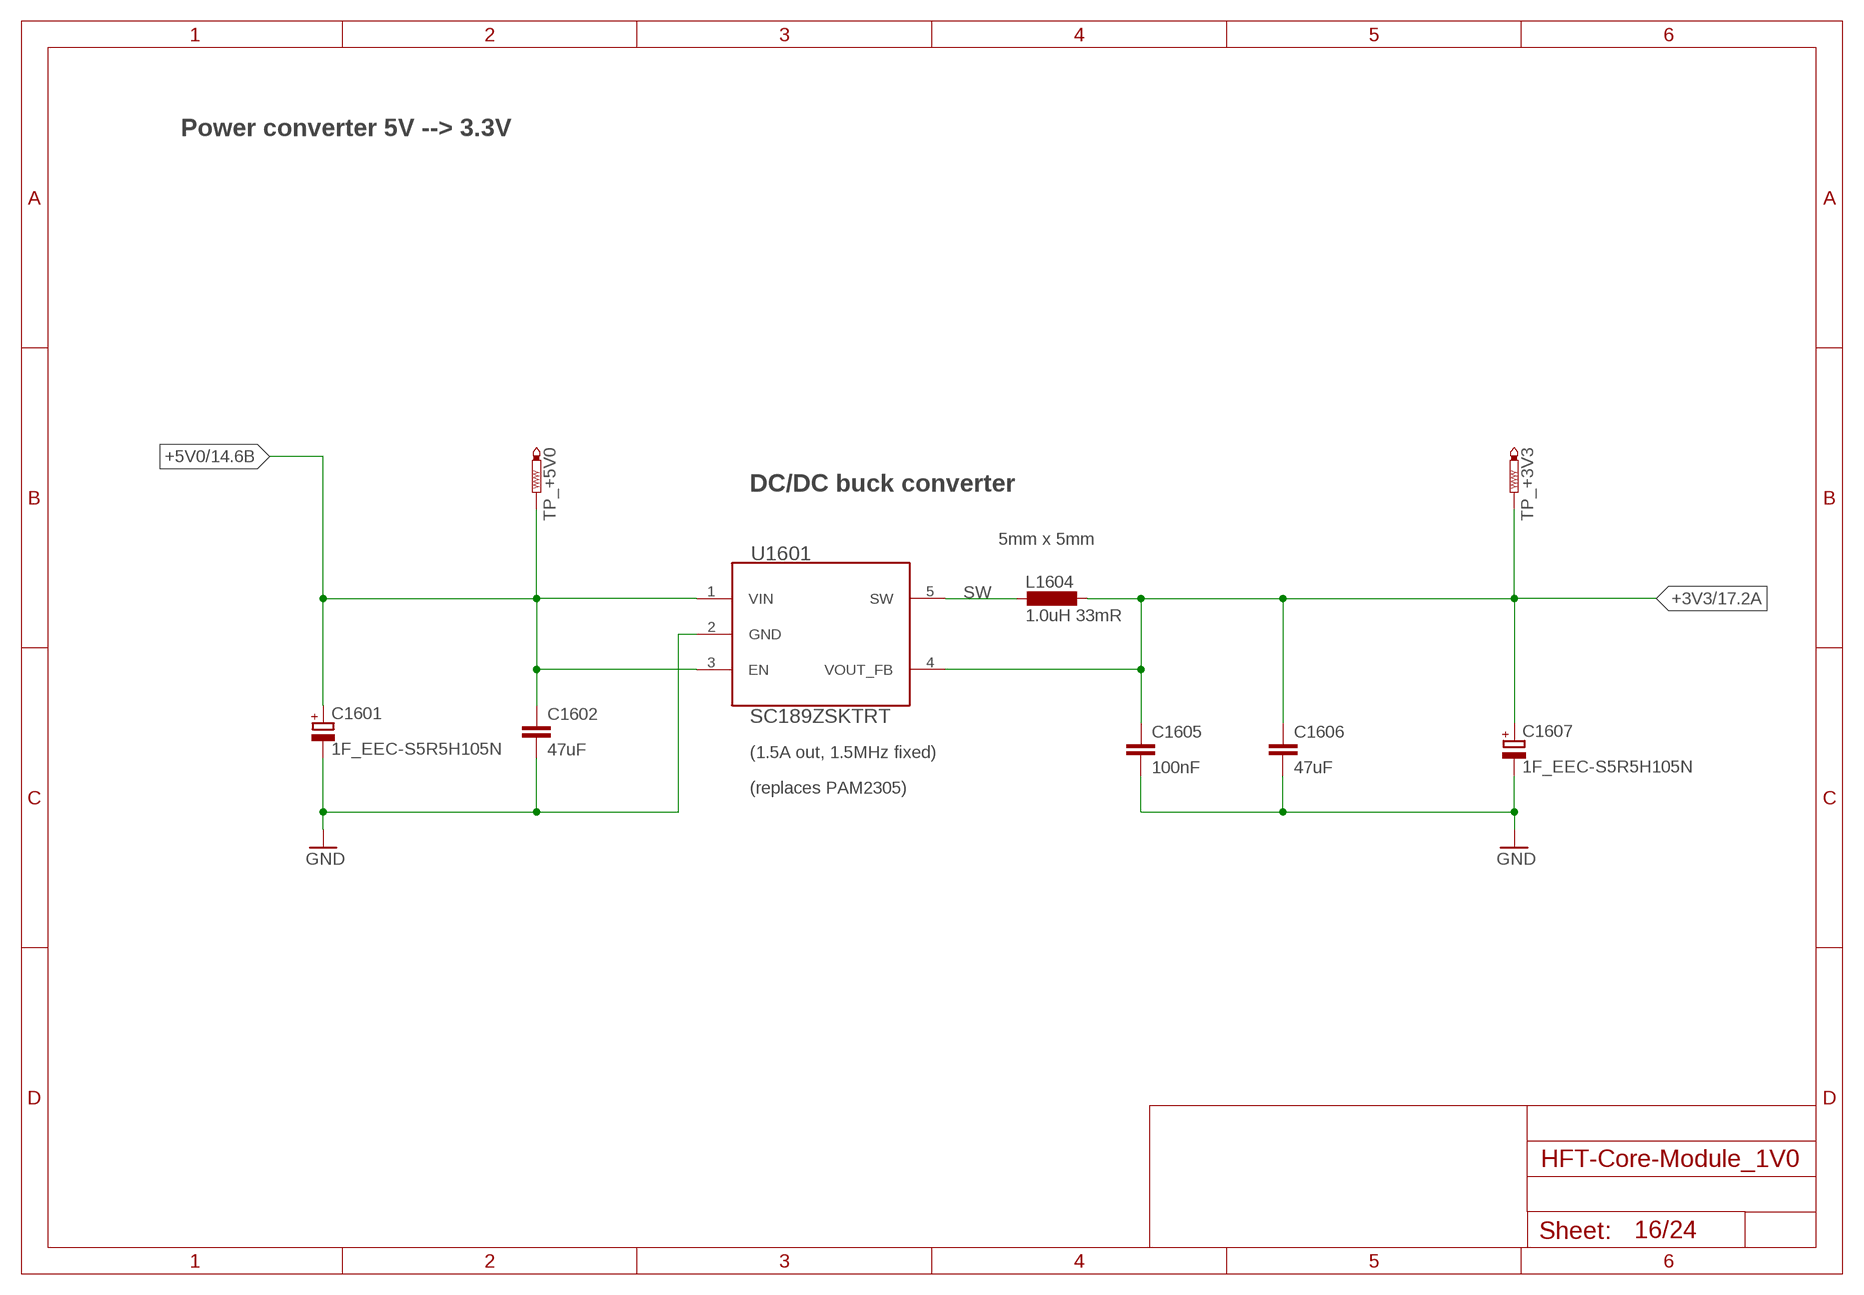
[diagram p15: schematic, sheet 16]

### Parts
C1601  1F_EEC-S5R5H105N  CPOL-EUW14MM_D8MM_P13MM5  [W14MM_D8MM_P13MM5]
C1602  47uF  C-EUC0805  [C0805]
C1605  100nF  C-EUC0603  [C0603]
C1606  47uF  C-EUC0805  [C0805]
C1607  1F_EEC-S5R5H105N  CPOL-EUW14MM_D8MM_P13MM5  [W14MM_D8MM_P13MM5]
L1604  1.0uH 33mR  L-EUL5650M  [L5650M]
TP_+3V3  PTR1B1,27  [B1,27]
TP_+5V0  PTR1B1,27  [B1,27]
U1601  SC189ZSKTRT  PAM2305  [SOT95P280X145-5N]

### Nets
+3V3: C1605.1 C1606.1 C1607.+ L1604.1 TP_+3V3.TP U1601.4(VOUT_FB) ; also sheet 1,3,4,6,8,9,10,12,13,17,18,19,23
+5V0 [pwrA5]: C1601.+ C1602.1 TP_+5V0.TP U1601.1(VIN) U1601.3(EN) ; also sheet 14,15,23
GND: C1601.- C1602.2 C1605.2 C1606.2 C1607.- U1601.2(GND) ; also sheet 1,3,4,5,6,7,8,9,10,11,12,13,14,15,17,18,19,20,21,22,23,24
SW: L1604.2 U1601.5(SW)

### Notes on the sheet
- Power converter 5V --> 3.3V
- DC/DC buck converter
- 5mm x 5mm
- (1.5A out, 1.5MHz fixed)
- (replaces PAM2305)

## Sheet 17 of 24: 3V3 High Current
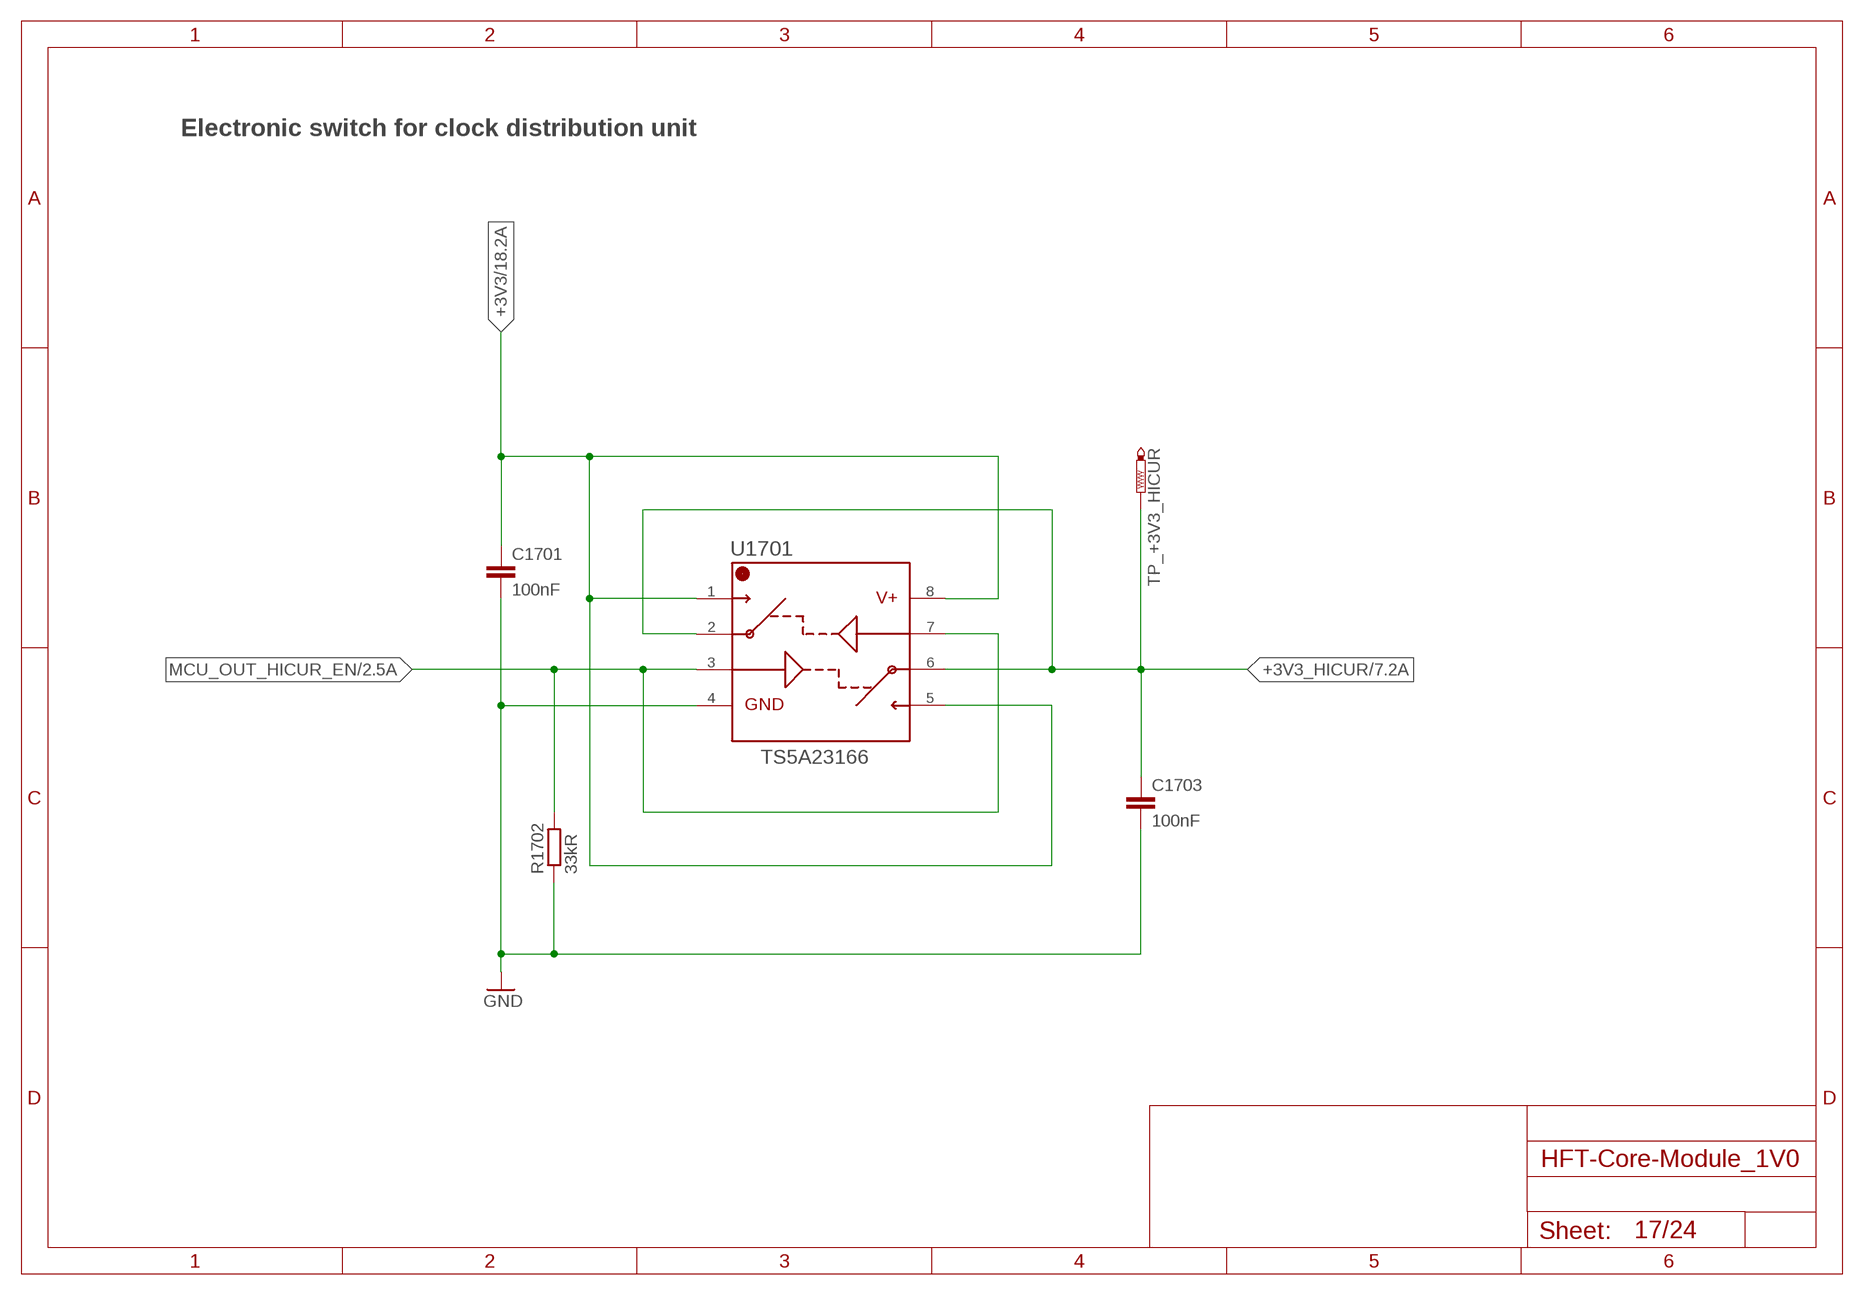
[diagram p16: schematic, sheet 17]

### Parts
C1701  100nF  C-EUC0603  [C0603]
C1703  100nF  C-EUC0603  [C0603]
R1702  33kR  R-EU_R0603  [R0603]
TP_+3V3_HICUR  PTR1B1,27  [B1,27]
U1701  TS5A23166  [R-PDSO-G8]

### Nets
+3V3: C1701.1 U1701.1 U1701.5 U1701.8 ; also sheet 1,3,4,6,8,9,10,12,13,16,18,19,23
+3V3_HICUR: C1703.1 TP_+3V3_HICUR.TP U1701.2 U1701.6 ; also sheet 7,11
GND: C1701.2 C1703.2 R1702.1 U1701.4 ; also sheet 1,3,4,5,6,7,8,9,10,11,12,13,14,15,16,18,19,20,21,22,23,24
MCU_OUT_HICUR_EN: R1702.2 U1701.3 U1701.7 ; also sheet 2

### Notes on the sheet
- Electronic switch for clock distribution unit

## Sheet 18 of 24: 3V3_20MHz
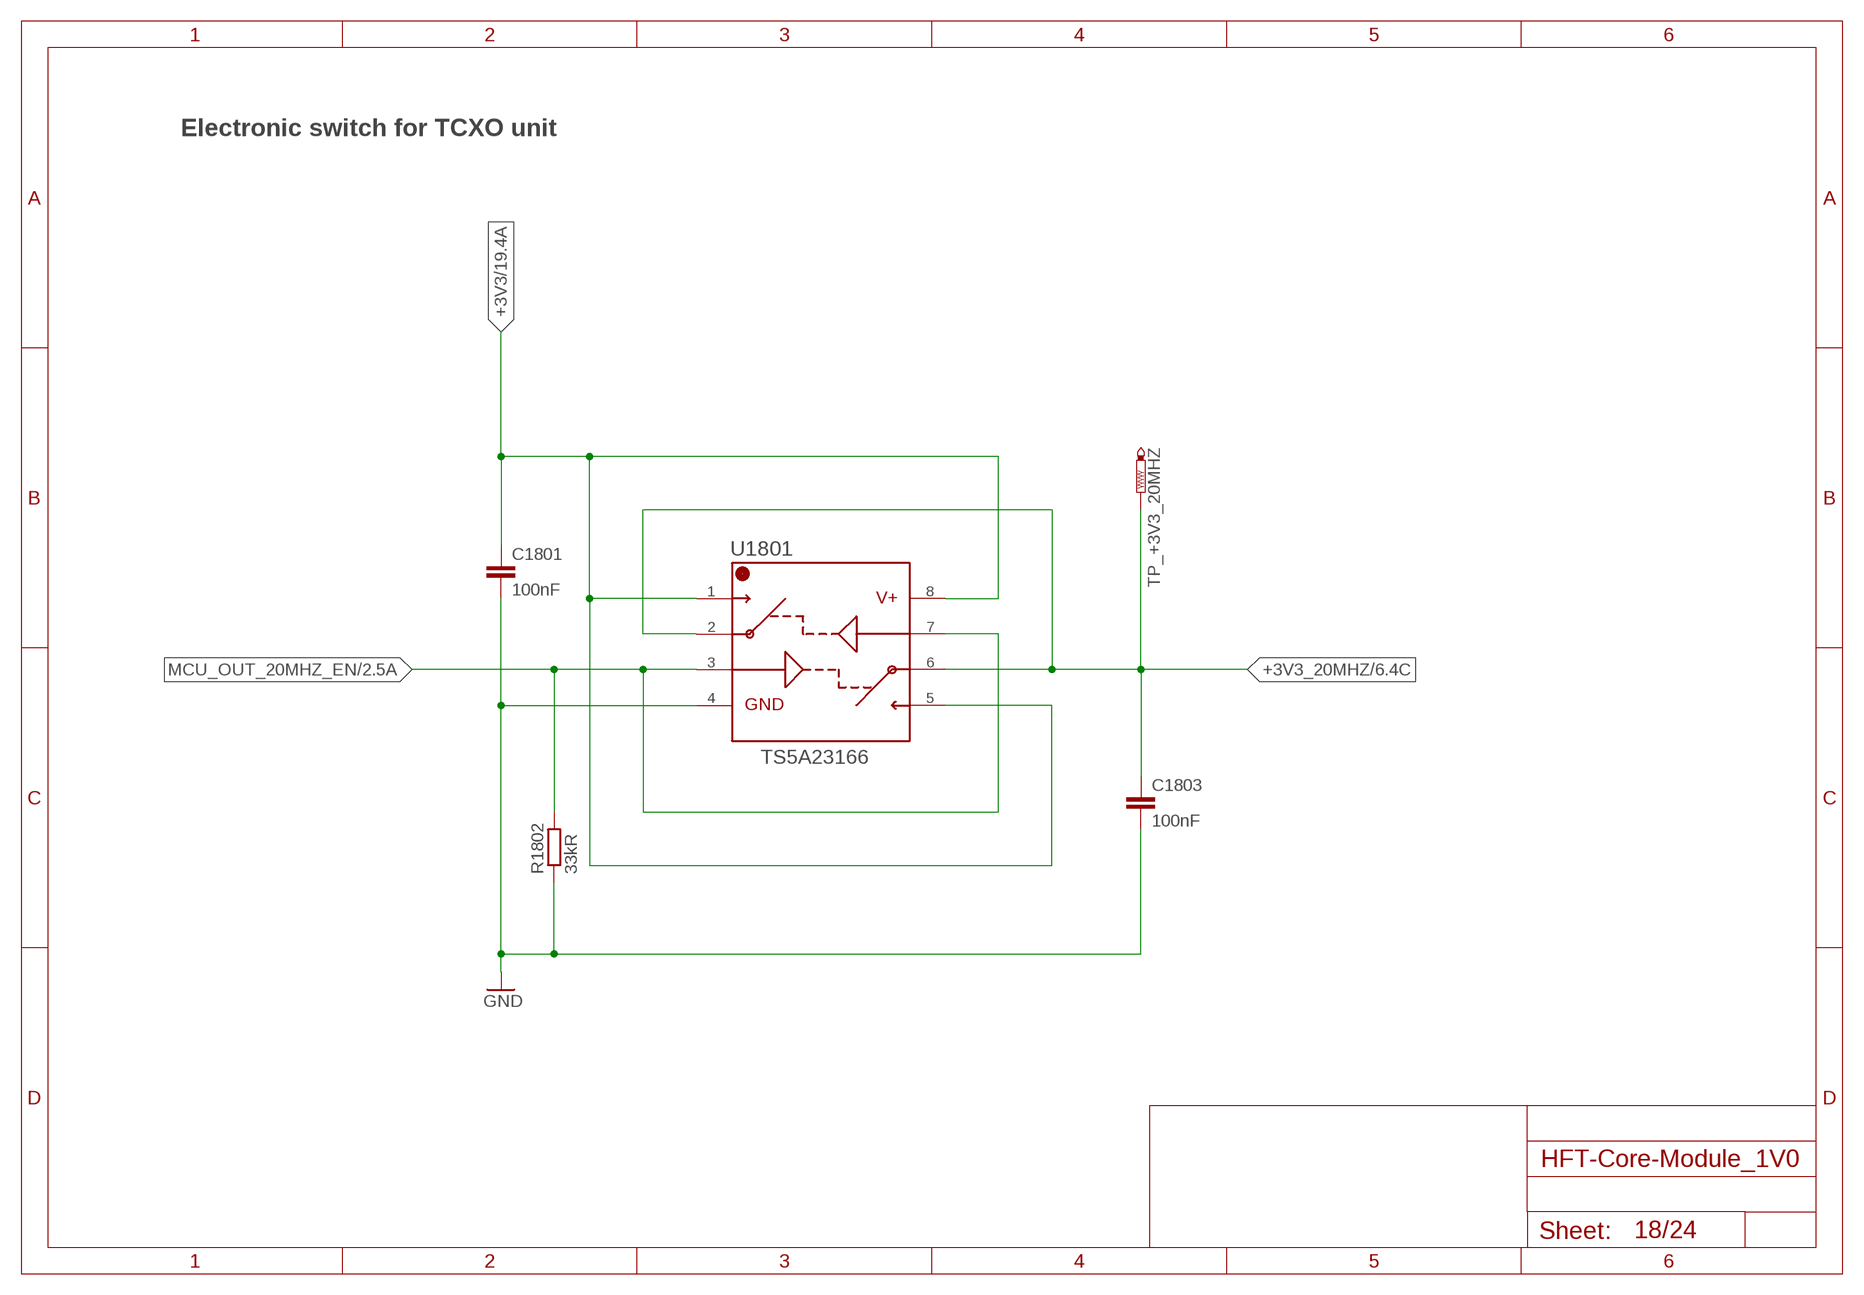
[diagram p17: schematic, sheet 18]

### Parts
C1801  100nF  C-EUC0603  [C0603]
C1803  100nF  C-EUC0603  [C0603]
R1802  33kR  R-EU_R0603  [R0603]
TP_+3V3_20MHZ  PTR1B1,27  [B1,27]
U1801  TS5A23166  [R-PDSO-G8]

### Nets
+3V3: C1801.1 U1801.1 U1801.5 U1801.8 ; also sheet 1,3,4,6,8,9,10,12,13,16,17,19,23
+3V3_20MHZ: C1803.1 TP_+3V3_20MHZ.TP U1801.2 U1801.6 ; also sheet 6
GND: C1801.2 C1803.2 R1802.1 U1801.4 ; also sheet 1,3,4,5,6,7,8,9,10,11,12,13,14,15,16,17,19,20,21,22,23,24
MCU_OUT_20MHZ_EN: R1802.2 U1801.3 U1801.7 ; also sheet 2,6

### Notes on the sheet
- Electronic switch for TCXO unit

## Sheet 19 of 24: 1.2V -> MCU
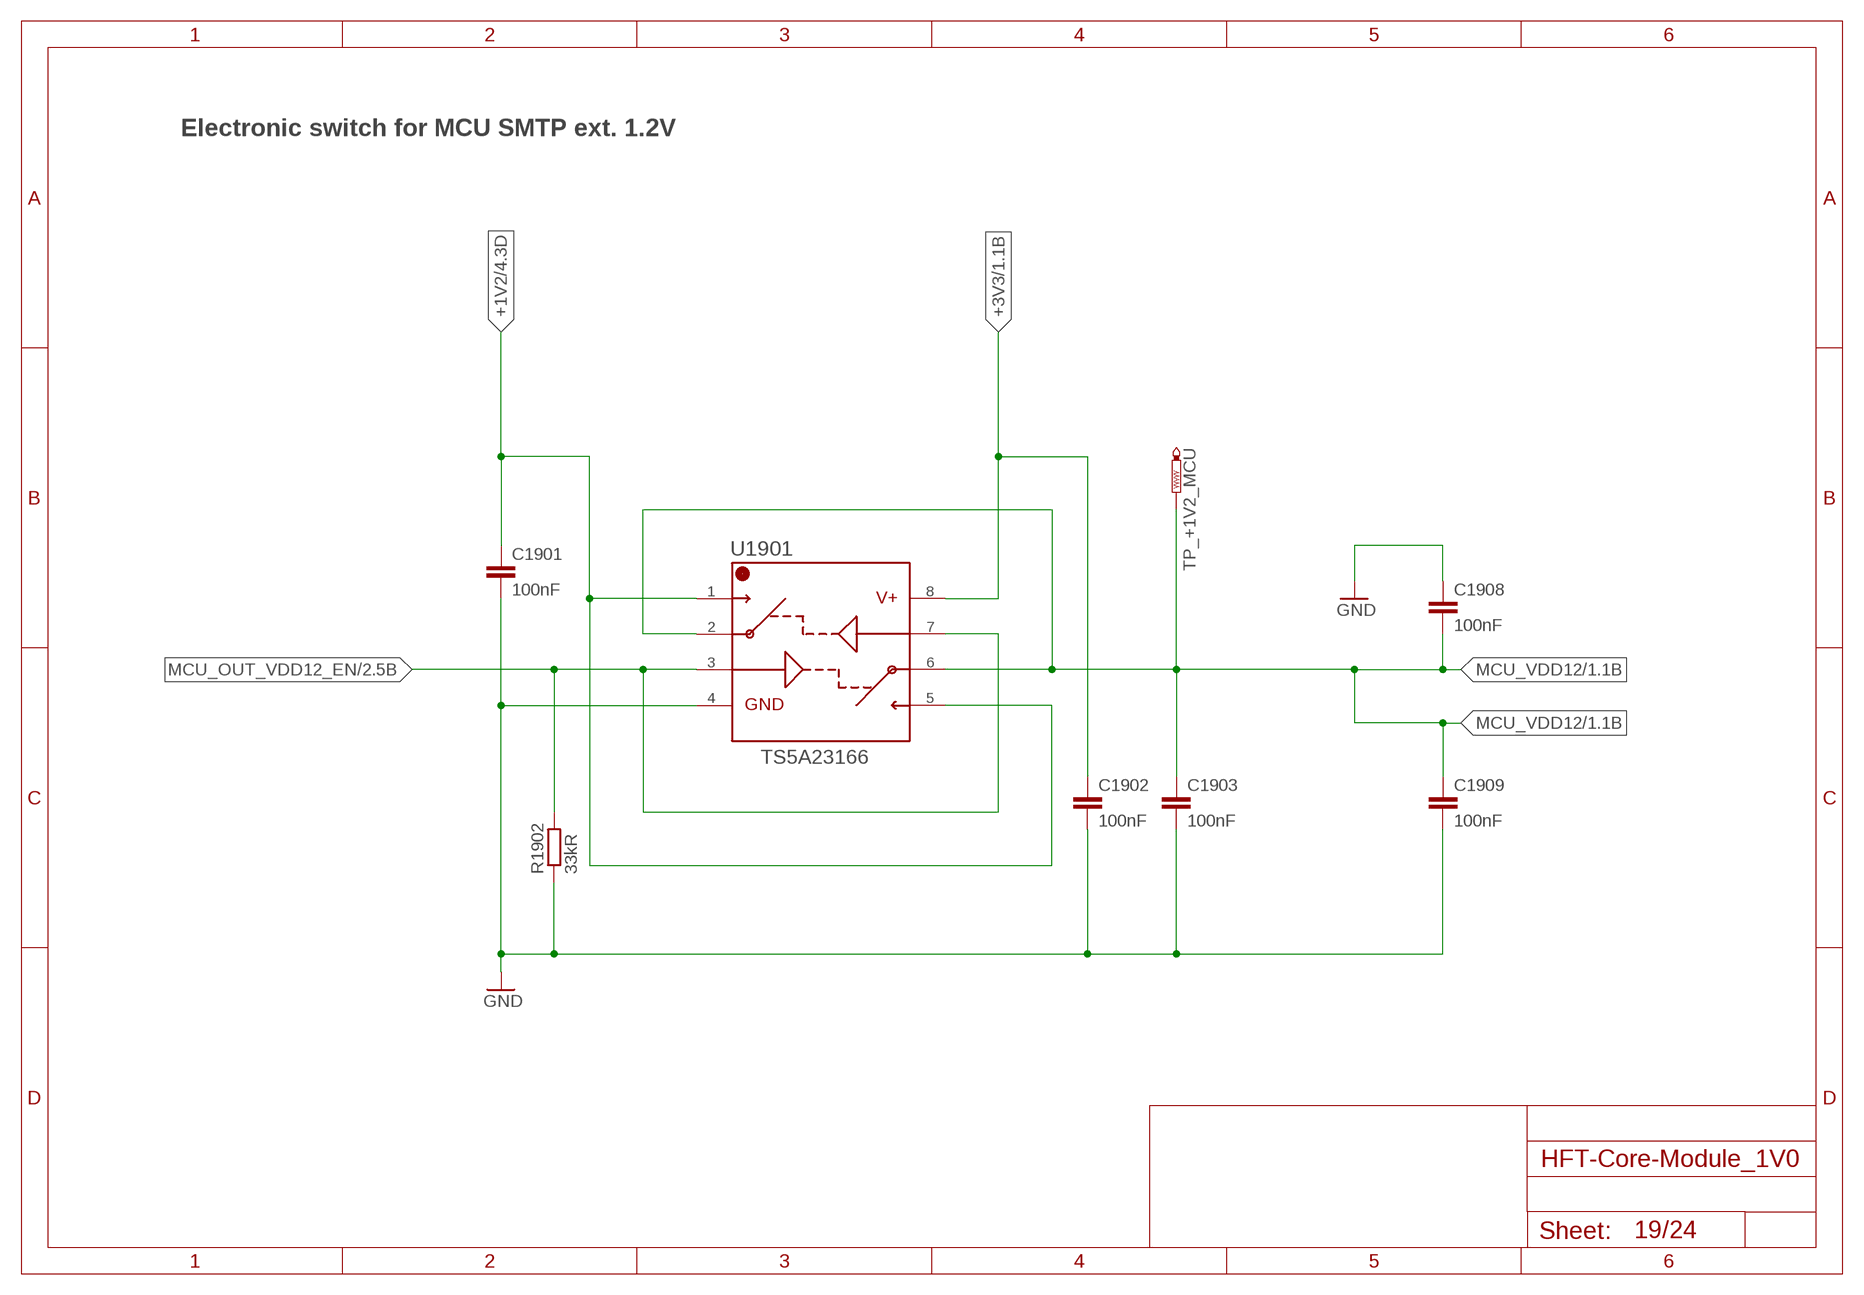
[diagram p18: schematic, sheet 19]

### Parts
C1901  100nF  C-EUC0603  [C0603]
C1902  100nF  C-EUC0603  [C0603]
C1903  100nF  C-EUC0603  [C0603]
C1908  100nF  C-EUC0603  [C0603]
C1909  100nF  C-EUC0603  [C0603]
R1902  33kR  R-EU_R0603  [R0603]
TP_+1V2_MCU  PTR1B1,27  [B1,27]
U1901  TS5A23166  [R-PDSO-G8]

### Nets
+1V2: C1901.1 U1901.1 U1901.5 ; also sheet 4
+3V3: C1902.1 U1901.8 ; also sheet 1,3,4,6,8,9,10,12,13,16,17,18,23
GND: C1901.2 C1902.2 C1903.2 C1908.1 C1909.2 R1902.1 U1901.4 ; also sheet 1,3,4,5,6,7,8,9,10,11,12,13,14,15,16,17,18,20,21,22,23,24
MCU_OUT_VDD12_EN: R1902.2 U1901.3 U1901.7 ; also sheet 2
MCU_VDD12: C1903.1 C1908.2 C1909.1 TP_+1V2_MCU.TP U1901.2 U1901.6 ; also sheet 1

### Notes on the sheet
- Electronic switch for MCU SMTP ext. 1.2V

## Sheet 20 of 24: USB Jack
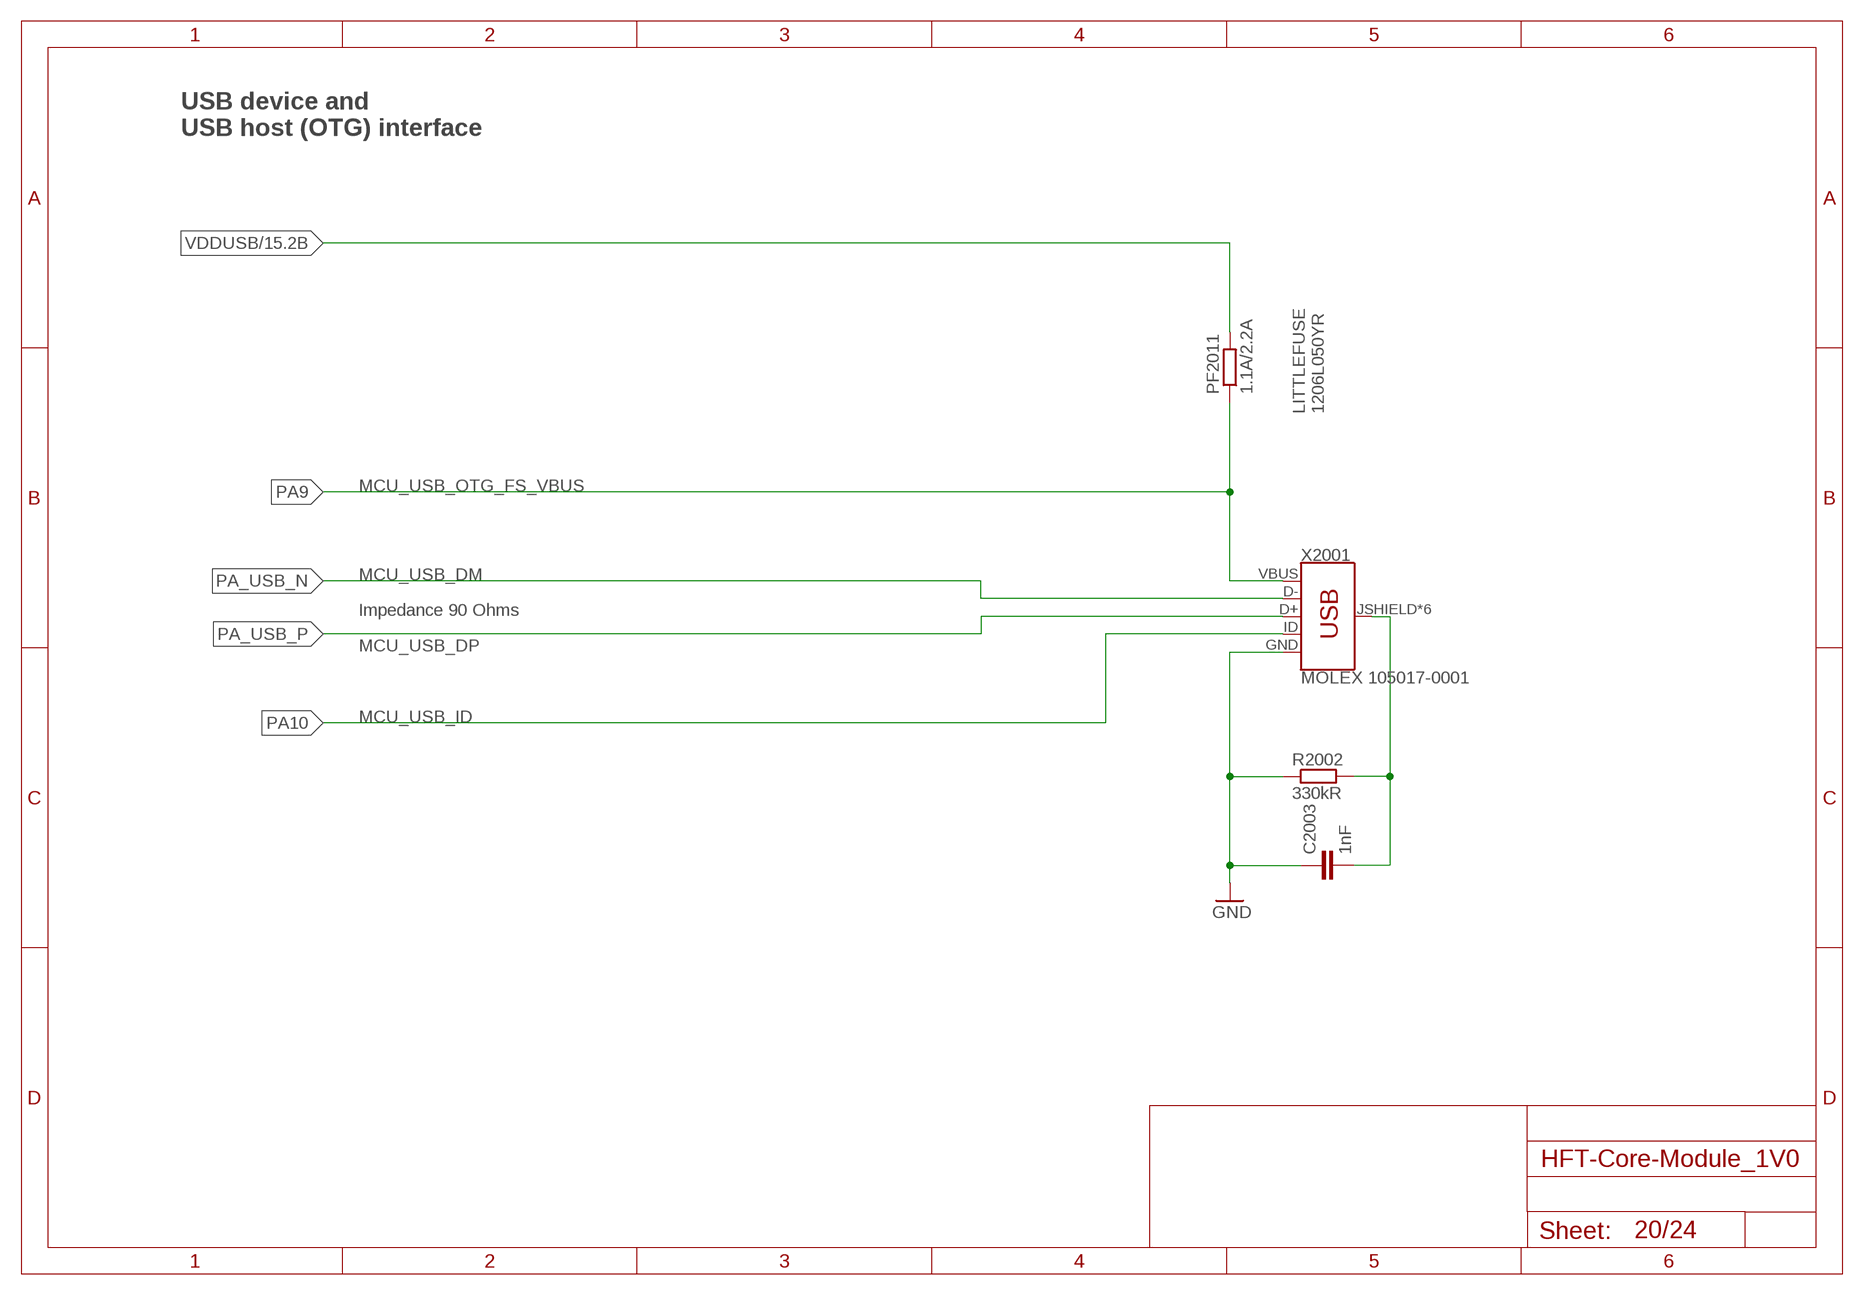
[diagram p19: schematic, sheet 20]

### Parts
C2003  1nF  C-EUC0603  [C0603]
PF2011  1.1A/2.2A  R-EU_M1206  [M1206]
R2002  330kR  R-EU_R0603  [R0603]
X2001  MOLEX 105017-0001  USB_MICRO-B_MOLEX  [USB-B-MICRO-SMD_MOLEX-105017-0001]

### Nets
GND: C2003.1 R2002.1 X2001.GND ; also sheet 1,3,4,5,6,7,8,9,10,11,12,13,14,15,16,17,18,19,21,22,23,24
PA9: PF2011.1 X2001.VBUS(J_VUSB) ; also sheet 1
PA10: X2001.ID(J_ID) ; also sheet 1
PA_USB_N: X2001.D-(J_D-) ; also sheet 1
PA_USB_P: X2001.D+(J_D+) ; also sheet 1
USB_SHIELD: C2003.2 R2002.2 X2001.JSHIELD(SHIELD) X2001.JSHIELD@2(SHIELD) X2001.JSHIELD@3(SHIELD) X2001.JSHIELD@4(SHIELD) X2001.JSHIELD@5(SHIELD) X2001.JSHIELD@6(SHIELD)
VDDUSB: PF2011.2 ; also sheet 15

### Notes on the sheet
- USB device and
  USB host (OTG) interface
- LITTLEFUSE
  1206L050YR
- MCU_USB_OTG_FS_VBUS
- MCU_USB_DM
- Impedance 90 Ohms
- MCU_USB_DP
- MCU_USB_ID

## Sheet 21 of 24: SMA sockets
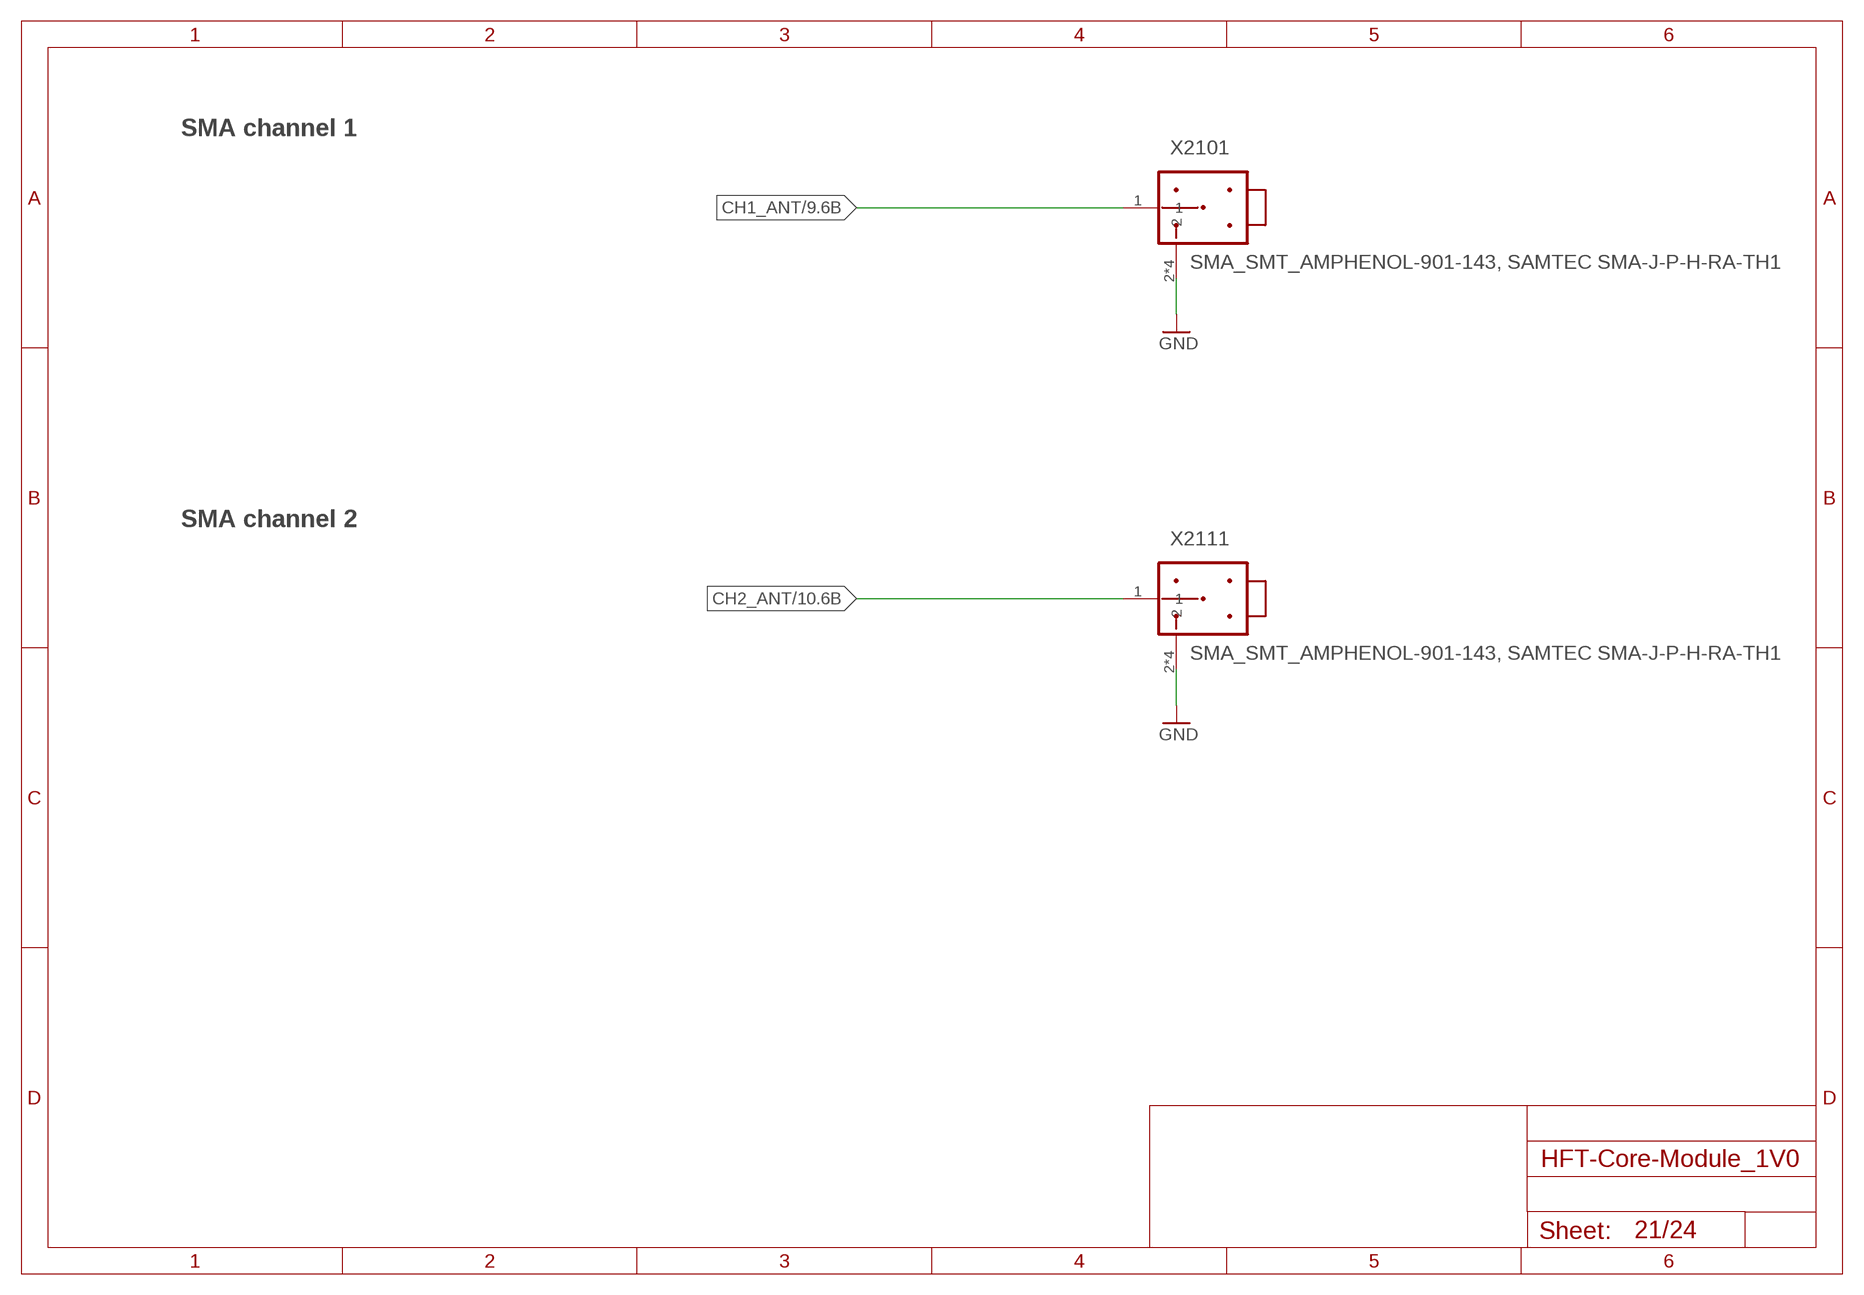
[diagram p20: schematic, sheet 21]

### Parts
X2101  SMA_SMT_AMPHENOL-901-143, SAMTEC SMA-J-P-H-RA-TH1  SMA_SMT_AMPHENOL-901-143  [SMA_SMT_AMPHENOL_901-143]
X2111  SMA_SMT_AMPHENOL-901-143, SAMTEC SMA-J-P-H-RA-TH1  SMA_SMT_AMPHENOL-901-143  [SMA_SMT_AMPHENOL_901-143]

### Nets
CH1_ANT: X2101.1 ; also sheet 9
CH2_ANT: X2111.1 ; also sheet 10
GND: X2101.2 X2101.3 X2101.4 X2101.5 X2111.2 X2111.3 X2111.4 X2111.5 ; also sheet 1,3,4,5,6,7,8,9,10,11,12,13,14,15,16,17,18,19,20,22,23,24

### Notes on the sheet
- SMA channel 1
- SMA channel 2

## Sheet 22 of 24: 3.5 mm Jack
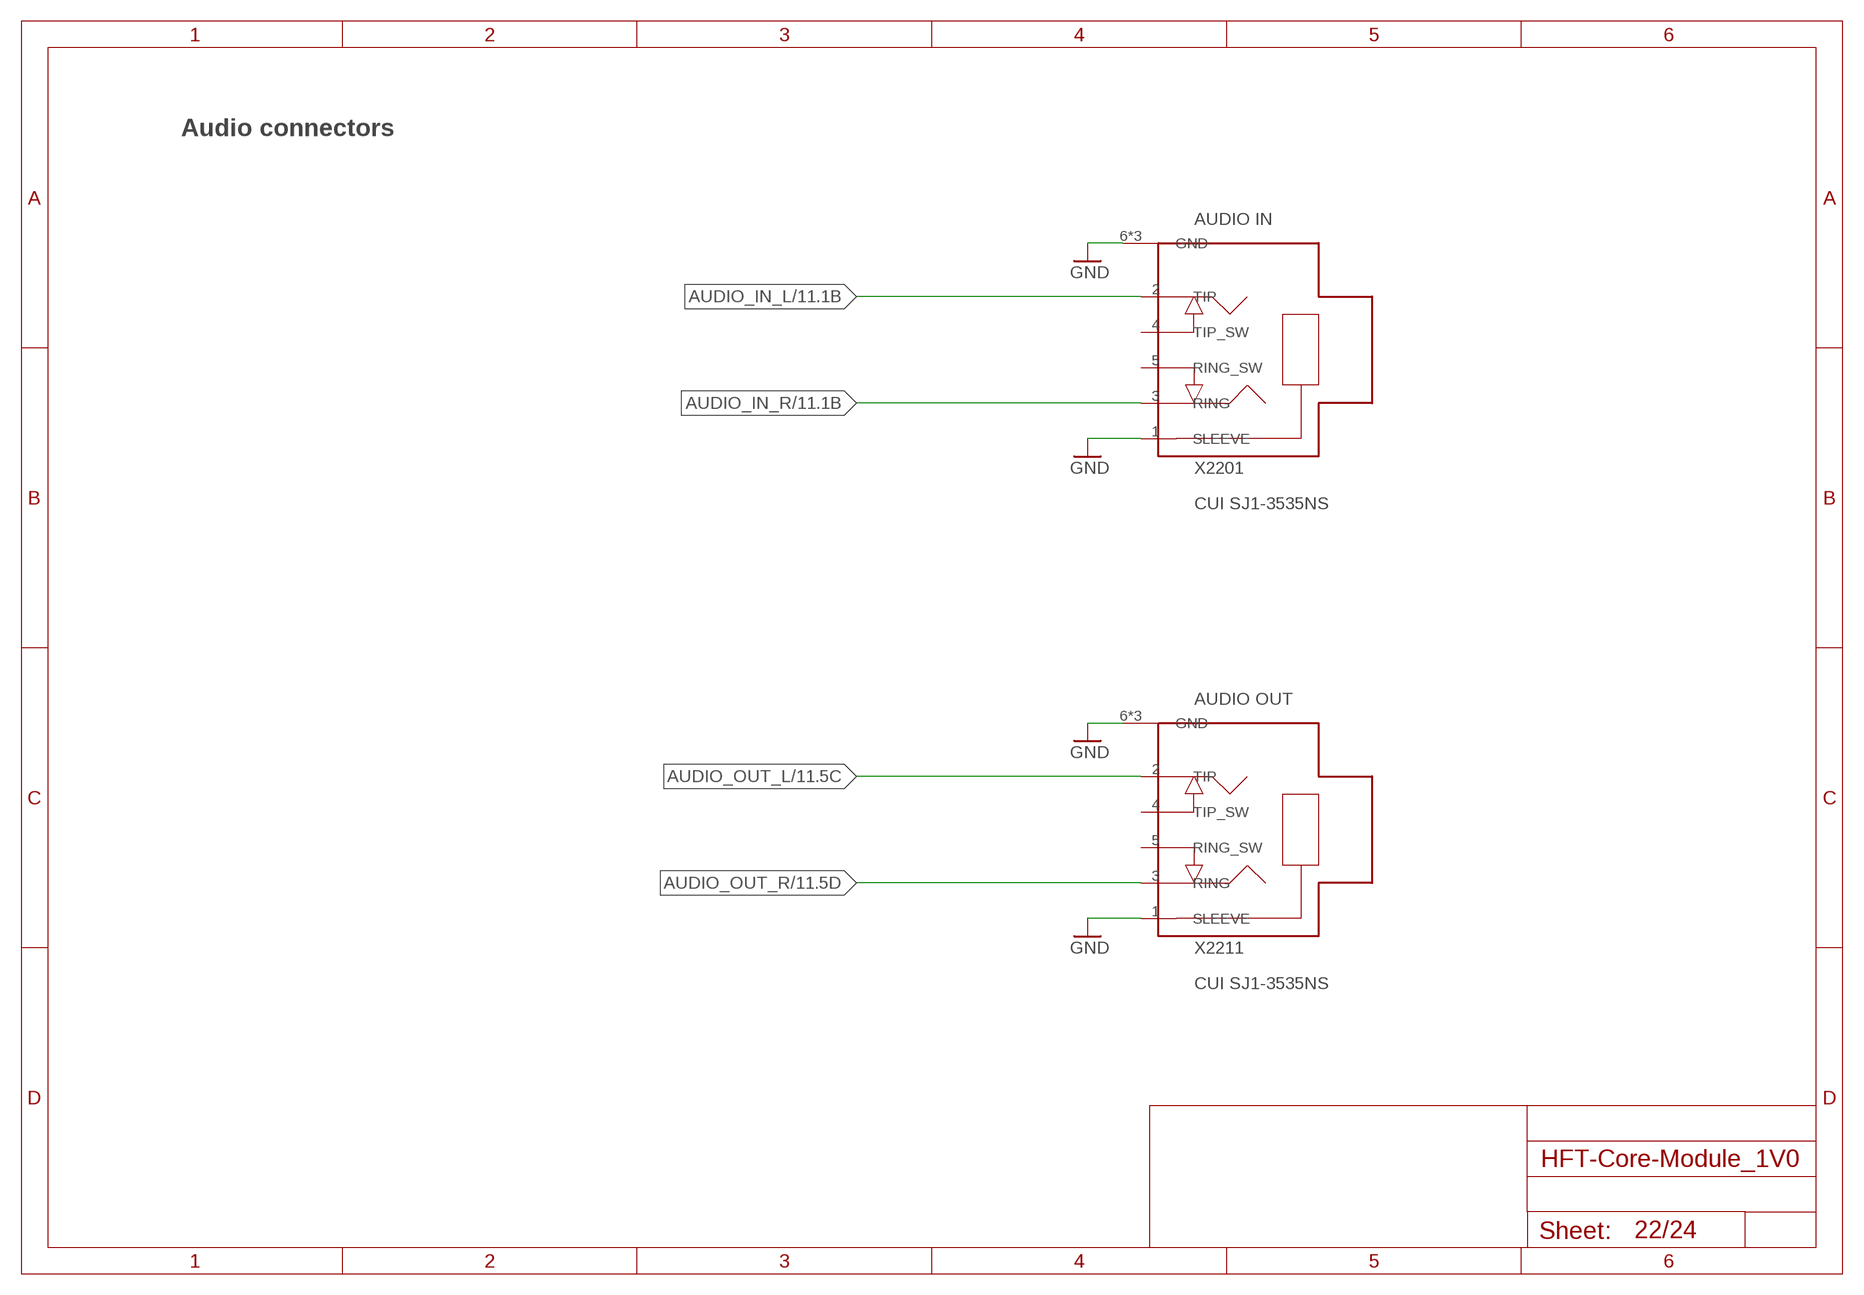
[diagram p21: schematic, sheet 22]

### Parts
X2201  CUI SJ1-3535NS  SJ1-353XNS_3MM5-STEREO-AUDIO-JACKS  [SJ1-353XNS_3MM5-STEREO-AUDIO-JACKS]
X2211  CUI SJ1-3535NS  SJ1-353XNS_3MM5-STEREO-AUDIO-JACKS  [SJ1-353XNS_3MM5-STEREO-AUDIO-JACKS]

### Nets
AUDIO_IN_L: X2201.2(TIP) ; also sheet 11
AUDIO_IN_R: X2201.3(RING) ; also sheet 11
AUDIO_OUT_L: X2211.2(TIP) ; also sheet 11
AUDIO_OUT_R: X2211.3(RING) ; also sheet 11
GND: X2201.1(SLEEVE) X2201.6(GND) X2201.7(GND) X2201.8(GND) X2211.1(SLEEVE) X2211.6(GND) X2211.7(GND) X2211.8(GND) ; also sheet 1,3,4,5,6,7,8,9,10,11,12,13,14,15,16,17,18,19,20,21,23,24
Unconnected: X2201.4(TIP_SW) X2201.5(RING_SW) X2211.4(TIP_SW) X2211.5(RING_SW)

### Notes on the sheet
- Audio connectors
- AUDIO IN
- AUDIO OUT

## Sheet 23 of 24: Con LEFT
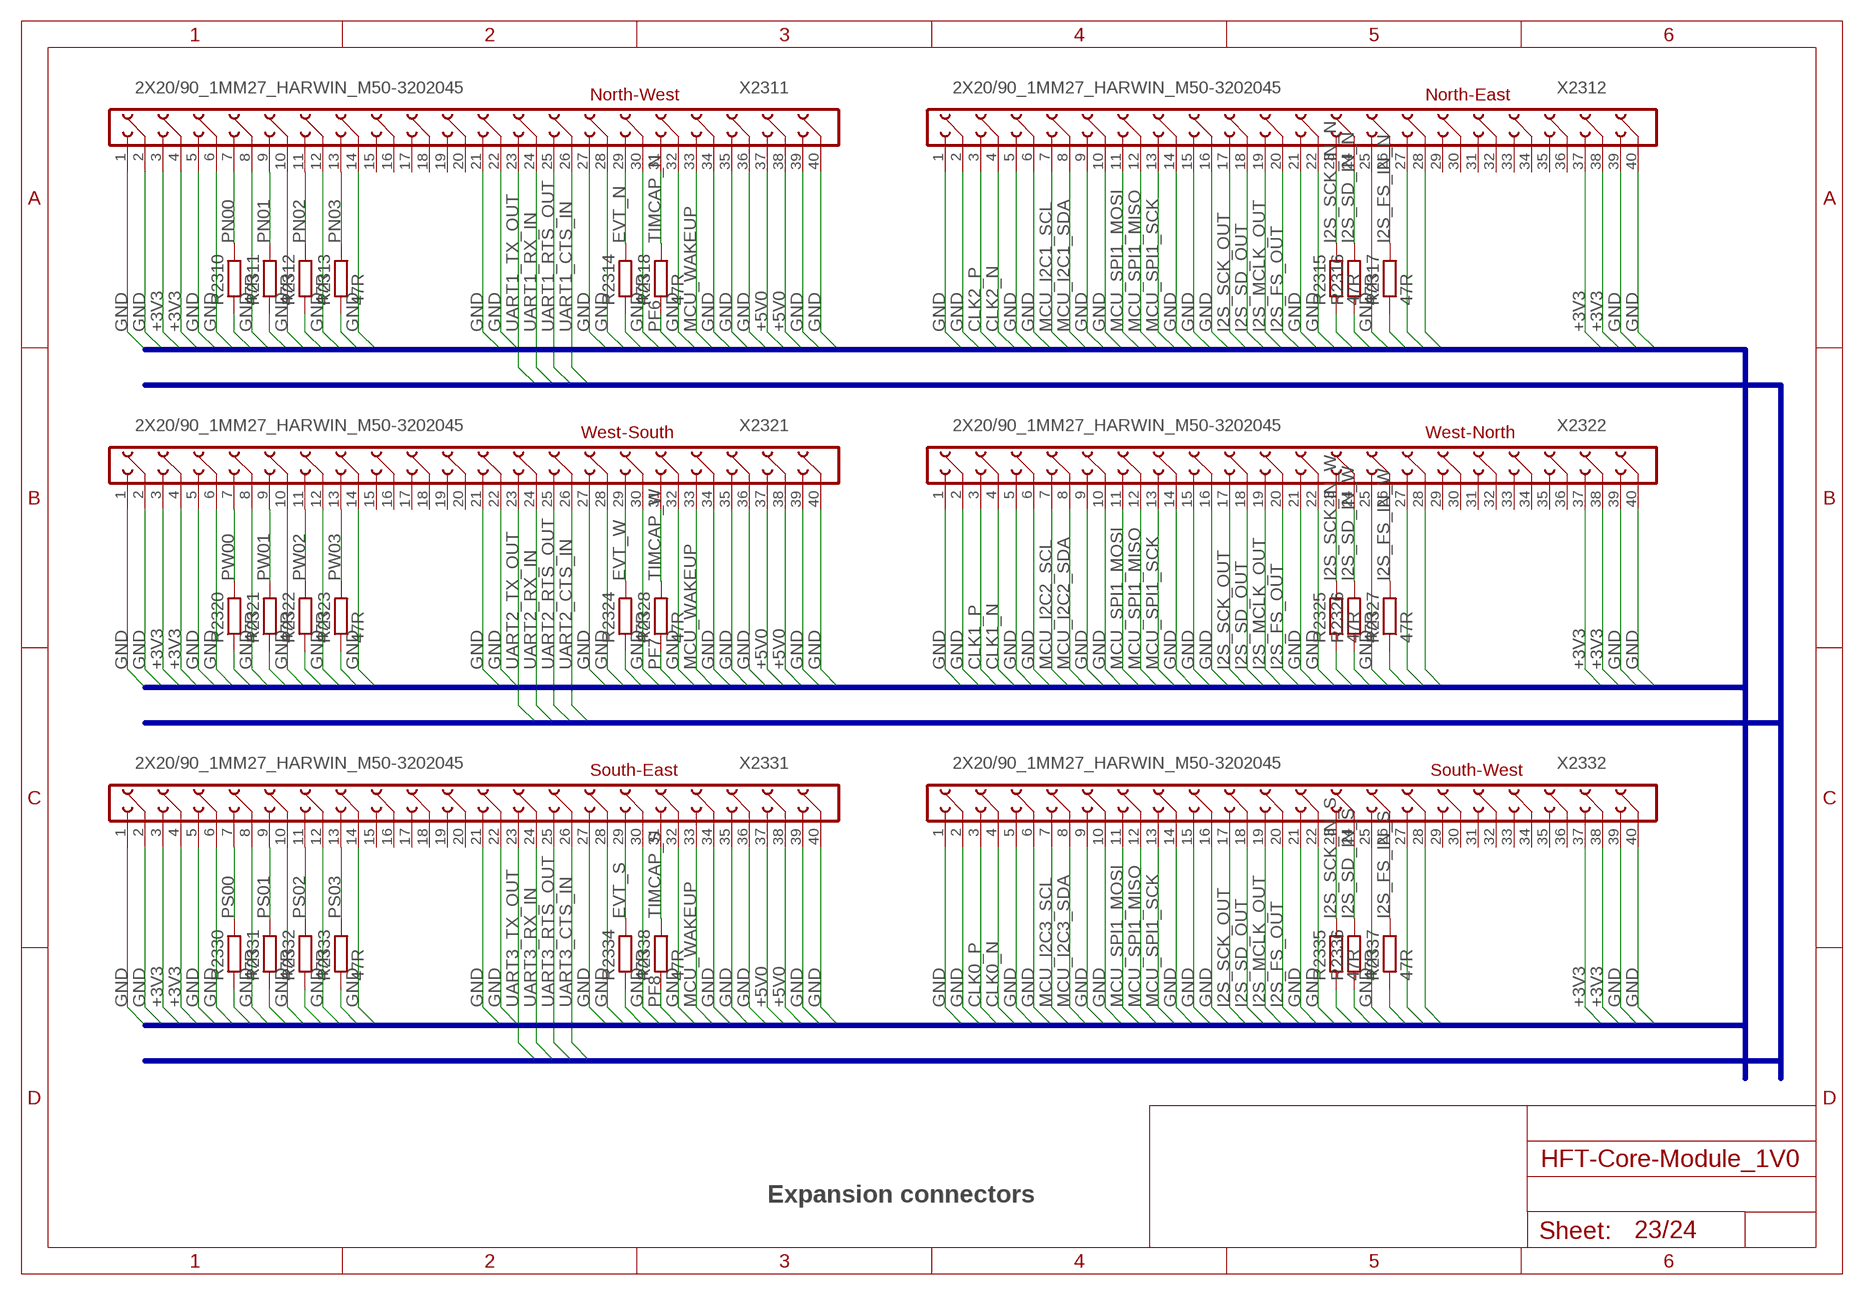
[diagram p22: schematic, sheet 23]

### Parts
R2310  47R  R-EU_R0603  [R0603]
R2311  47R  R-EU_R0603  [R0603]
R2312  47R  R-EU_R0603  [R0603]
R2313  47R  R-EU_R0603  [R0603]
R2314  47R  R-EU_R0603  [R0603]
R2315  47R  R-EU_R0603  [R0603]
R2316  47R  R-EU_R0603  [R0603]
R2317  47R  R-EU_R0603  [R0603]
R2318  47R  R-EU_R0603  [R0603]
R2320  47R  R-EU_R0603  [R0603]
R2321  47R  R-EU_R0603  [R0603]
R2322  47R  R-EU_R0603  [R0603]
R2323  47R  R-EU_R0603  [R0603]
R2324  47R  R-EU_R0603  [R0603]
R2325  47R  R-EU_R0603  [R0603]
R2326  47R  R-EU_R0603  [R0603]
R2327  47R  R-EU_R0603  [R0603]
R2328  47R  R-EU_R0603  [R0603]
R2330  47R  R-EU_R0603  [R0603]
R2331  47R  R-EU_R0603  [R0603]
R2332  47R  R-EU_R0603  [R0603]
R2333  47R  R-EU_R0603  [R0603]
R2334  47R  R-EU_R0603  [R0603]
R2335  47R  R-EU_R0603  [R0603]
R2336  47R  R-EU_R0603  [R0603]
R2337  47R  R-EU_R0603  [R0603]
R2338  47R  R-EU_R0603  [R0603]
X2311  2X20/90_1MM27_HARWIN_M50-3202045  [2X20/90_1MM27_HARWIN_M50-3202045]
X2312  2X20/90_1MM27_HARWIN_M50-3202045  [2X20/90_1MM27_HARWIN_M50-3202045]
X2321  2X20/90_1MM27_HARWIN_M50-3202045  [2X20/90_1MM27_HARWIN_M50-3202045]
X2322  2X20/90_1MM27_HARWIN_M50-3202045  [2X20/90_1MM27_HARWIN_M50-3202045]
X2331  2X20/90_1MM27_HARWIN_M50-3202045  [2X20/90_1MM27_HARWIN_M50-3202045]
X2332  2X20/90_1MM27_HARWIN_M50-3202045  [2X20/90_1MM27_HARWIN_M50-3202045]

### Nets
+3V3: X2311.3 X2311.4 X2312.37 X2312.38 X2321.3 X2321.4 X2322.37 X2322.38 X2331.3 X2331.4 X2332.37 X2332.38 ; also sheet 1,3,4,6,8,9,10,12,13,16,17,18,19
+5V0 [pwrA5]: X2311.37 X2311.38 X2321.37 X2321.38 X2331.37 X2331.38 ; also sheet 14,15,16
CLK0_N: X2332.4 ; also sheet 7
CLK0_P: X2332.3 ; also sheet 7
CLK1_N: X2322.4 ; also sheet 7
CLK1_P: X2322.3 ; also sheet 7
CLK2_N: X2312.4 ; also sheet 7
CLK2_P: X2312.3 ; also sheet 7
EVT_N: R2314.2 X2311.29
EVT_S: R2334.2 X2331.29
EVT_W: R2324.2 X2321.29
GND: X2311.1 X2311.2 X2311.5 X2311.6 X2311.8 X2311.10 X2311.12 X2311.14 X2311.21 X2311.22 X2311.27 X2311.28 X2311.30 X2311.32 X2311.34 X2311.35 X2311.36 X2311.39 X2311.40 X2312.1 X2312.2 X2312.5 X2312.6 X2312.9 X2312.10 X2312.14 X2312.15 X2312.16 X2312.21 X2312.22 X2312.25 X2312.27 X2312.28 X2312.39 X2312.40 X2321.1 X2321.2 X2321.5 X2321.6 X2321.8 X2321.10 X2321.12 X2321.14 X2321.21 X2321.22 X2321.27 X2321.28 X2321.30 X2321.32 X2321.34 X2321.35 X2321.36 X2321.39 X2321.40 X2322.1 X2322.2 X2322.5 X2322.6 X2322.9 X2322.10 X2322.14 X2322.15 X2322.16 X2322.21 X2322.22 X2322.25 X2322.27 X2322.28 X2322.39 X2322.40 X2331.1 X2331.2 X2331.5 X2331.6 X2331.8 X2331.10 X2331.12 X2331.14 X2331.21 X2331.22 X2331.27 X2331.28 X2331.30 X2331.32 X2331.34 X2331.35 X2331.36 X2331.39 X2331.40 X2332.1 X2332.2 X2332.5 X2332.6 X2332.9 X2332.10 X2332.14 X2332.15 X2332.16 X2332.21 X2332.22 X2332.25 X2332.27 X2332.28 X2332.39 X2332.40 ; also sheet 1,3,4,5,6,7,8,9,10,11,12,13,14,15,16,17,18,19,20,21,22,24
I2S_FS_IN_N: R2317.2 X2312.26
I2S_FS_IN_S: R2337.2 X2332.26
I2S_FS_IN_W: R2327.2 X2322.26
I2S_FS_OUT: X2312.20 X2322.20 X2332.20 ; also sheet 2
I2S_MCLK_OUT: X2312.19 X2322.19 X2332.19 ; also sheet 2
I2S_SCK_IN_N: R2315.2 X2312.23
I2S_SCK_IN_S: R2335.2 X2332.23
I2S_SCK_IN_W: R2325.2 X2322.23
I2S_SCK_OUT: X2312.17 X2322.17 X2332.17 ; also sheet 2
I2S_SD_IN_N: R2316.2 X2312.24
I2S_SD_IN_S: R2336.2 X2332.24
I2S_SD_IN_W: R2326.2 X2322.24
I2S_SD_OUT: X2312.18 X2322.18 X2332.18 ; also sheet 2
MCU_I2C1_SCL: X2312.7 ; also sheet 2
MCU_I2C1_SDA: X2312.8 ; also sheet 2
MCU_I2C2_SCL: X2322.7 ; also sheet 2
MCU_I2C2_SDA: X2322.8 ; also sheet 2
MCU_I2C3_SCL: X2332.7 ; also sheet 2
MCU_I2C3_SDA: X2332.8 ; also sheet 2
MCU_SPI1_MISO: X2312.12 X2322.12 X2332.12 ; also sheet 2
MCU_SPI1_MOSI: X2312.11 X2322.11 X2332.11 ; also sheet 2
MCU_SPI1_SCK: X2312.13 X2322.13 X2332.13 ; also sheet 2
MCU_WAKEUP: X2311.33 X2321.33 X2331.33 ; also sheet 2
PB3: R2310.1 ; also sheet 1
PB5: R2311.1 ; also sheet 1
PB6: R2312.1 ; also sheet 1
PB7: R2313.1 ; also sheet 1
PB13: R2315.1 R2325.1 R2335.1 ; also sheet 1
PD9: R2330.1 ; also sheet 1
PD10: R2331.1 ; also sheet 1
PD11: R2316.1 R2326.1 R2336.1 ; also sheet 1
PD12: R2317.1 R2327.1 R2337.1 ; also sheet 1
PD14: R2332.1 ; also sheet 1
PD15: R2333.1 ; also sheet 1
PE0: R2314.1 ; also sheet 1
PE2: R2323.1 ; also sheet 1
PE4: R2322.1 ; also sheet 1
PE5: R2321.1 ; also sheet 1
PF2: R2320.1 ; also sheet 1
PF6: R2318.1 ; also sheet 1
PF7: R2328.1 ; also sheet 1
PF8: R2338.1 ; also sheet 1
PF10: R2324.1 ; also sheet 1
PG4: R2334.1 ; also sheet 1
PN00: R2310.2 X2311.7
PN01: R2311.2 X2311.9
PN02: R2312.2 X2311.11
PN03: R2313.2 X2311.13
PS00: R2330.2 X2331.7
PS01: R2331.2 X2331.9
PS02: R2332.2 X2331.11
PS03: R2333.2 X2331.13
PW00: R2320.2 X2321.7
PW01: R2321.2 X2321.9
PW02: R2322.2 X2321.11
PW03: R2323.2 X2321.13
TIMCAP_N: R2318.2 X2311.31
TIMCAP_S: R2338.2 X2331.31
TIMCAP_W: R2328.2 X2321.31
UART1_CTS_IN: X2311.26 ; also sheet 2
UART1_RTS_OUT: X2311.25 ; also sheet 2
UART1_RX_IN: X2311.24 ; also sheet 2
UART1_TX_OUT: X2311.23 ; also sheet 2
UART2_CTS_IN: X2321.26 ; also sheet 2
UART2_RTS_OUT: X2321.25 ; also sheet 2
UART2_RX_IN: X2321.24 ; also sheet 2
UART2_TX_OUT: X2321.23 ; also sheet 2
UART3_CTS_IN: X2331.26 ; also sheet 2
UART3_RTS_OUT: X2331.25 ; also sheet 2
UART3_RX_IN: X2331.24 ; also sheet 2
UART3_TX_OUT: X2331.23 ; also sheet 2
Unconnected: X2311.15 X2311.16 X2311.17 X2311.18 X2311.19 X2311.20 X2312.29 X2312.30 X2312.31 X2312.32 X2312.33 X2312.34 X2312.35 X2312.36 X2321.15 X2321.16 X2321.17 X2321.18 X2321.19 X2321.20 X2322.29 X2322.30 X2322.31 X2322.32 X2322.33 X2322.34 X2322.35 X2322.36 X2331.15 X2331.16 X2331.17 X2331.18 X2331.19 X2331.20 X2332.29 X2332.30 X2332.31 X2332.32 X2332.33 X2332.34 X2332.35 X2332.36

### Buses
GND,+3V3,+5V0,CLK0_P,CLK0_N,CLK1_P,CLK1_N,CLK2_P,CLK2_N,MCU_WAKEUP,MCU_I2C1_SCL,MCU_I2C1_SDA,MCU_I2C2_SCL,MCU_I2C2_SDA,MCU_I2C3_SCL,MCU_I2C3_SDA,MCU_SPI1_SCK,MCU_SPI1_MOSI,MCU_SPI1_MISO,I2S_SCK_OUT,I2S_SD_OUT,I2S_MCLK_OUT,I2S_FS_OUT,PA[0..15],PB[0..15],PC[0..15],PD[0..15],PE[0..15],PF[0..15],PG[0..15],PH[0..3]
UART1_TX_OUT,UART2_TX_OUT,UART3_TX_OUT,UART1_RX_IN,UART2_RX_IN,UART3_RX_IN,UART1_RTS_OUT,UART2_RTS_OUT,UART3_RTS_OUT,UART1_CTS_IN,UART2_CTS_IN,UART3_CTS_IN

### Notes on the sheet
- North-West | North-East
- West-South | West-North
- South-East | South-West
- Expansion connectors

## Sheet 24 of 24: Holes
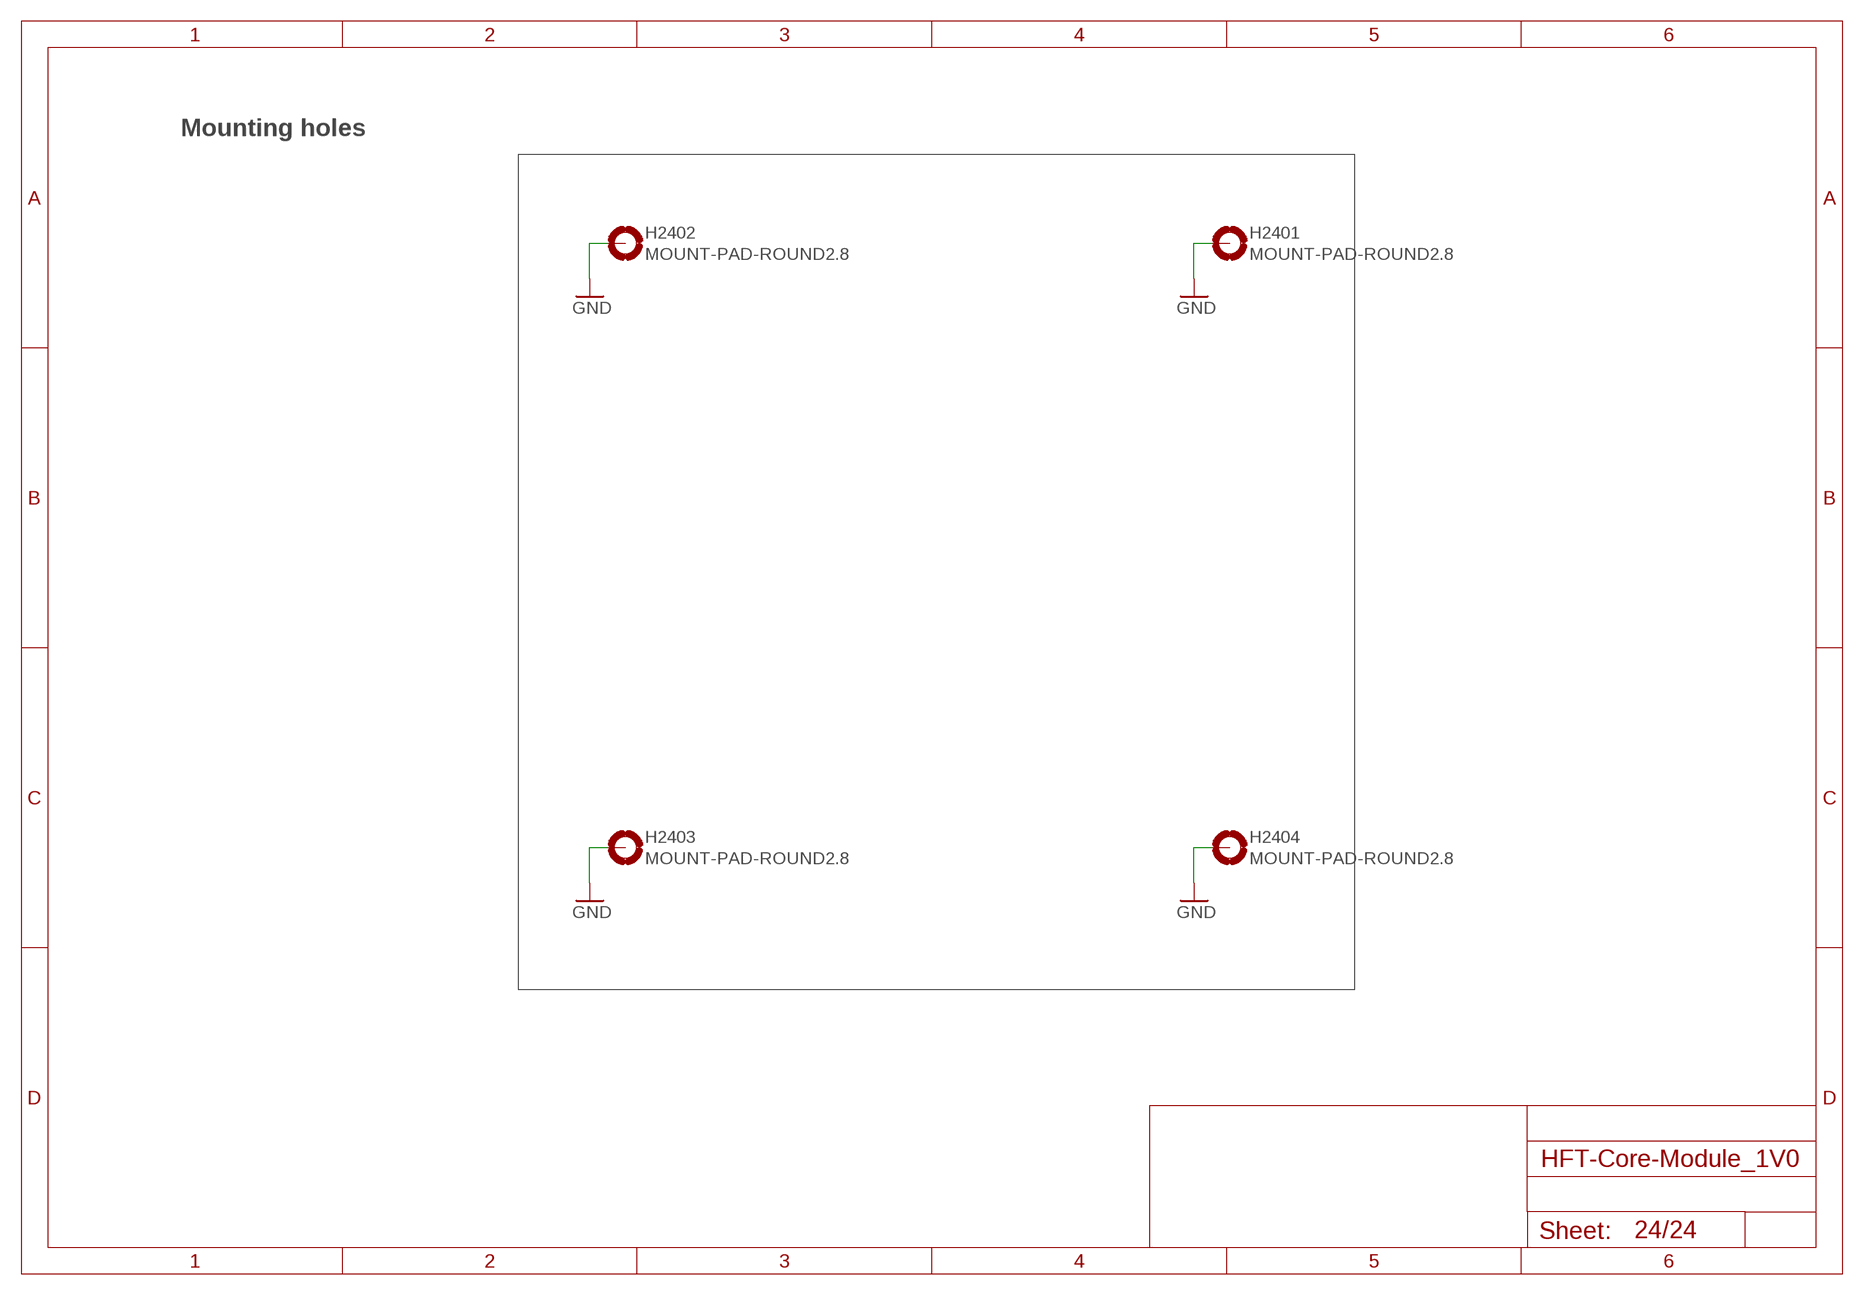
[diagram p23: schematic, sheet 24]

### Parts
H2401  MOUNT-PAD-ROUND2.8  [2,8-PAD]
H2402  MOUNT-PAD-ROUND2.8  [2,8-PAD]
H2403  MOUNT-PAD-ROUND2.8  [2,8-PAD]
H2404  MOUNT-PAD-ROUND2.8  [2,8-PAD]

### Nets
GND: H2401.B2,8(MOUNT) H2402.B2,8(MOUNT) H2403.B2,8(MOUNT) H2404.B2,8(MOUNT) ; also sheet 1,3,4,5,6,7,8,9,10,11,12,13,14,15,16,17,18,19,20,21,22,23

### Notes on the sheet
- Mounting holes